# EAGLE schematic CPU (EAGLE 7.5.0), part 6 of 7
## Module INSTRUCTION_DECODER
Ports: LOAD_XE_FROM_DATABUS(out) SELECT_XE_TO_DATABUS(out) LOAD_XH_FROM_DATABUS(out) SELECT_XH_TO_DATABUS(out) LOAD_XL_FROM_DATABUS(out) SELECT_XL_TO_DATABUS(out) LOAD_H_FROM_DATABUS(out) SELECT_H_TO_DATABUS(out) LOAD_G_FROM_DATABUS(out) SELECT_G_TO_DATABUS(out) LOAD_F_FROM_DATABUS(out) SELECT_F_TO_DATABUS(out) LOAD_E_FROM_DATABUS(out) SELECT_E_TO_DATABUS(out) LOAD_D_FROM_DATABUS(out) SELECT_D_TO_DATABUS(out) LOAD_X_FROM_ADDRESSBUS(out) SELECT_X_TO_ADDRESSBUS(out) SELECT_M_TO_ADDRESSBUS(out) LOAD_M_FROM_ADDRESSBUS(out) SELECT_J_TO_ADDRESSBUS(out) LOAD_J_FROM_ADDRESSBUS(out) SELECT_SP_TO_ADDRESSBUS(out) LOAD_SP_FROM_ADDRESSBUS(out) SELECT_BP_TO_ADDRESSBUS(out) LOAD_BP_FROM_ADDRESSBUS(out) SELECT_Y_TO_ADDRESSBUS(out) LOAD_Y_FROM_ADDRESSBUS(out) SELECT_Z_TO_ADDRESSBUS(out) LOAD_Z_FROM_ADDRESSBUS(out) SELECT_SRAM(out) LOAD_SRAM(out) INCREMETER(out) LOAD_PC(out) SELECT_PC(out) LOAD_INC(out) SELECT_INC(out) LOAD_INSTRUCTION(out) SELECT_INSTRUCTION_TO_DATABUS(out) LOAD_INTERNAL_A_FROM_DATABUS(out) SELECT_INTERNAL_A_TO_DATABUS(out) LOAD_A_FROM_DATABUS(out) SELECT_A_TO_ALU(out) LOAD_B_FROM_DATABUS(out) SELECT_B_TO_ALU(out) LOAD_C_FROM_DATABUS(out) SELECT_C_TO_DATABUS(out) STOPCPU(out) ALU_INSTRUCTION(out) SELECT_FLAGS(out) LOAD_FLAGS(out) SELECT_FLAGS_TO_FLAGSBUS(out) LOAD_FLAGS_FROM_FLAGSBUS(out) SELECT_FLAGS_TO_DATABUS(out) LOAD_FLAGS_FROM_DATABUS(out) LOAD_FLAGSSAVED_TO_FLAGS_REGISTER(out) LOAD_FLAGSSAVED_FROM_FLAGS_REGISTER(out) SELECT_PORT_A_TO_DATABUS(out) SELECT_PORT_B_TO_DATABUS(out) LOAD_PORT_C_FROM_DATABUS(out) LOAD_PORT_D_FROM_DATABUS(out) LOAD_ADDER16BIT_INPUT_A(out) LOAD_ADDER16BIT_INPUT_B(out) SELECT_ADDER16BIT_INPUT_A(out) SELECT_ADDER16BIT_INPUT_B(out) LOAD_ADDER16BIT_OUTPUT_C(out) SELECT_ADDER16BIT_OUTPUTC(out) SIGN(in) ZERO(in) CARRY(in) VCC(in) GND(in) I1(in) I2(in) I3(in) I4(in) I5(in) I6(in) I7(in) I8(in) T1(in) T2(in) T3(in) T4(in) T5(in) T6(in) T7(in) T8(in)
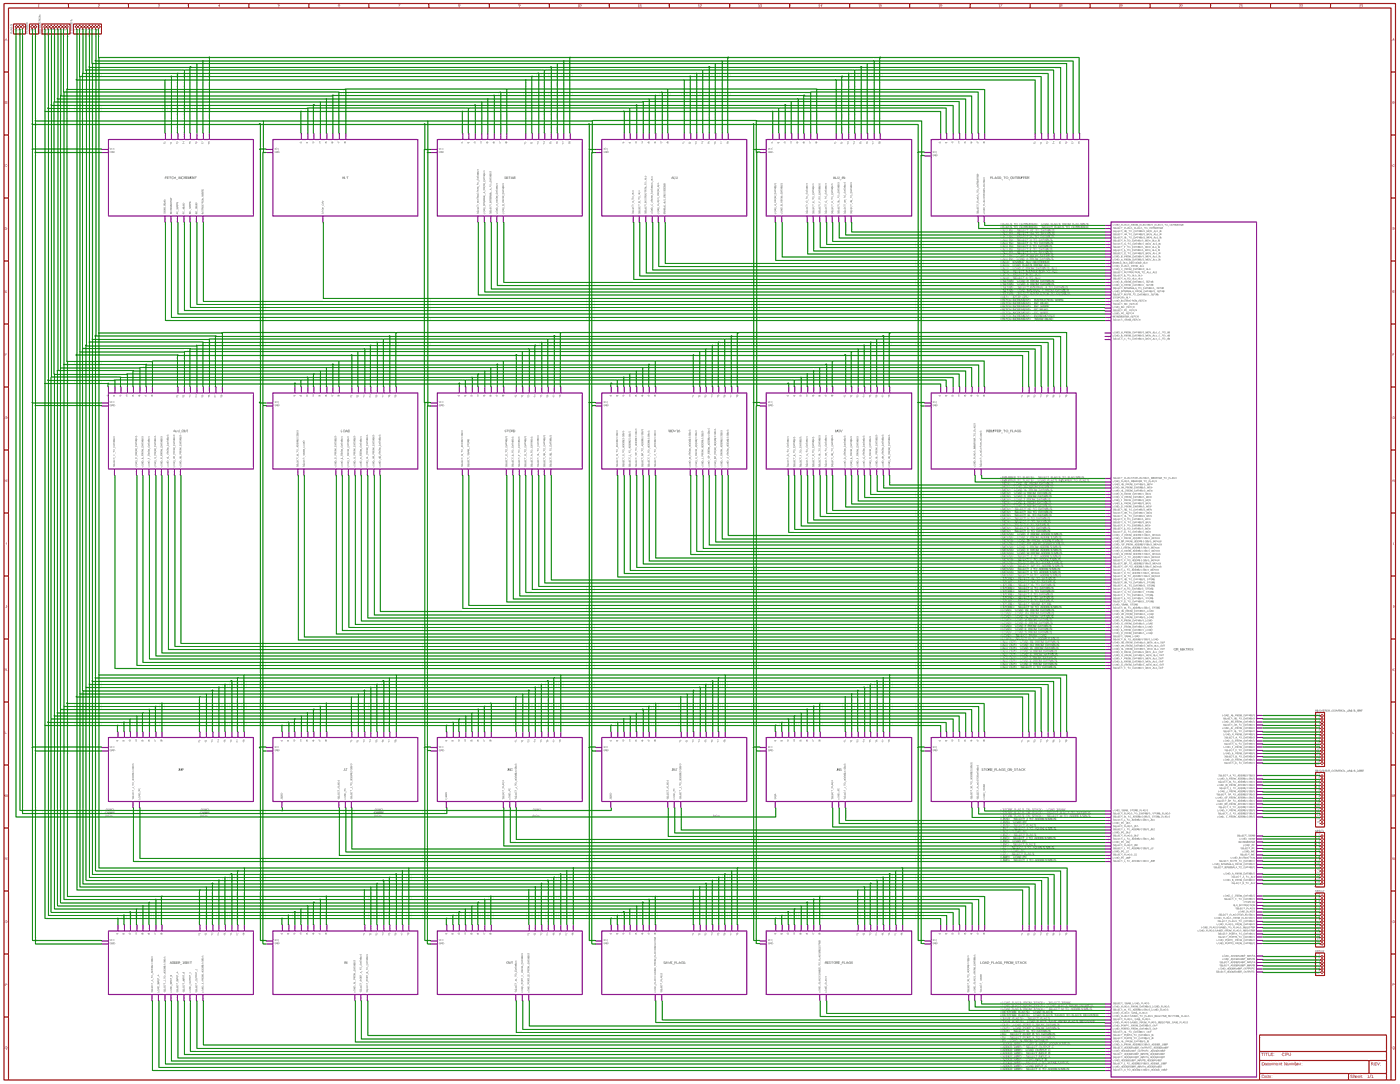
[diagram p79: schematic, module INSTRUCTION_DECODER, sheet 1, overview]
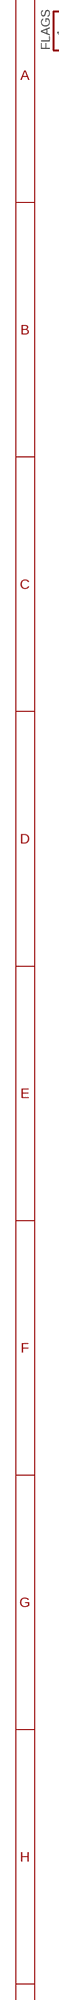
[diagram p80: schematic, module INSTRUCTION_DECODER, sheet 1, part 1 of 8]
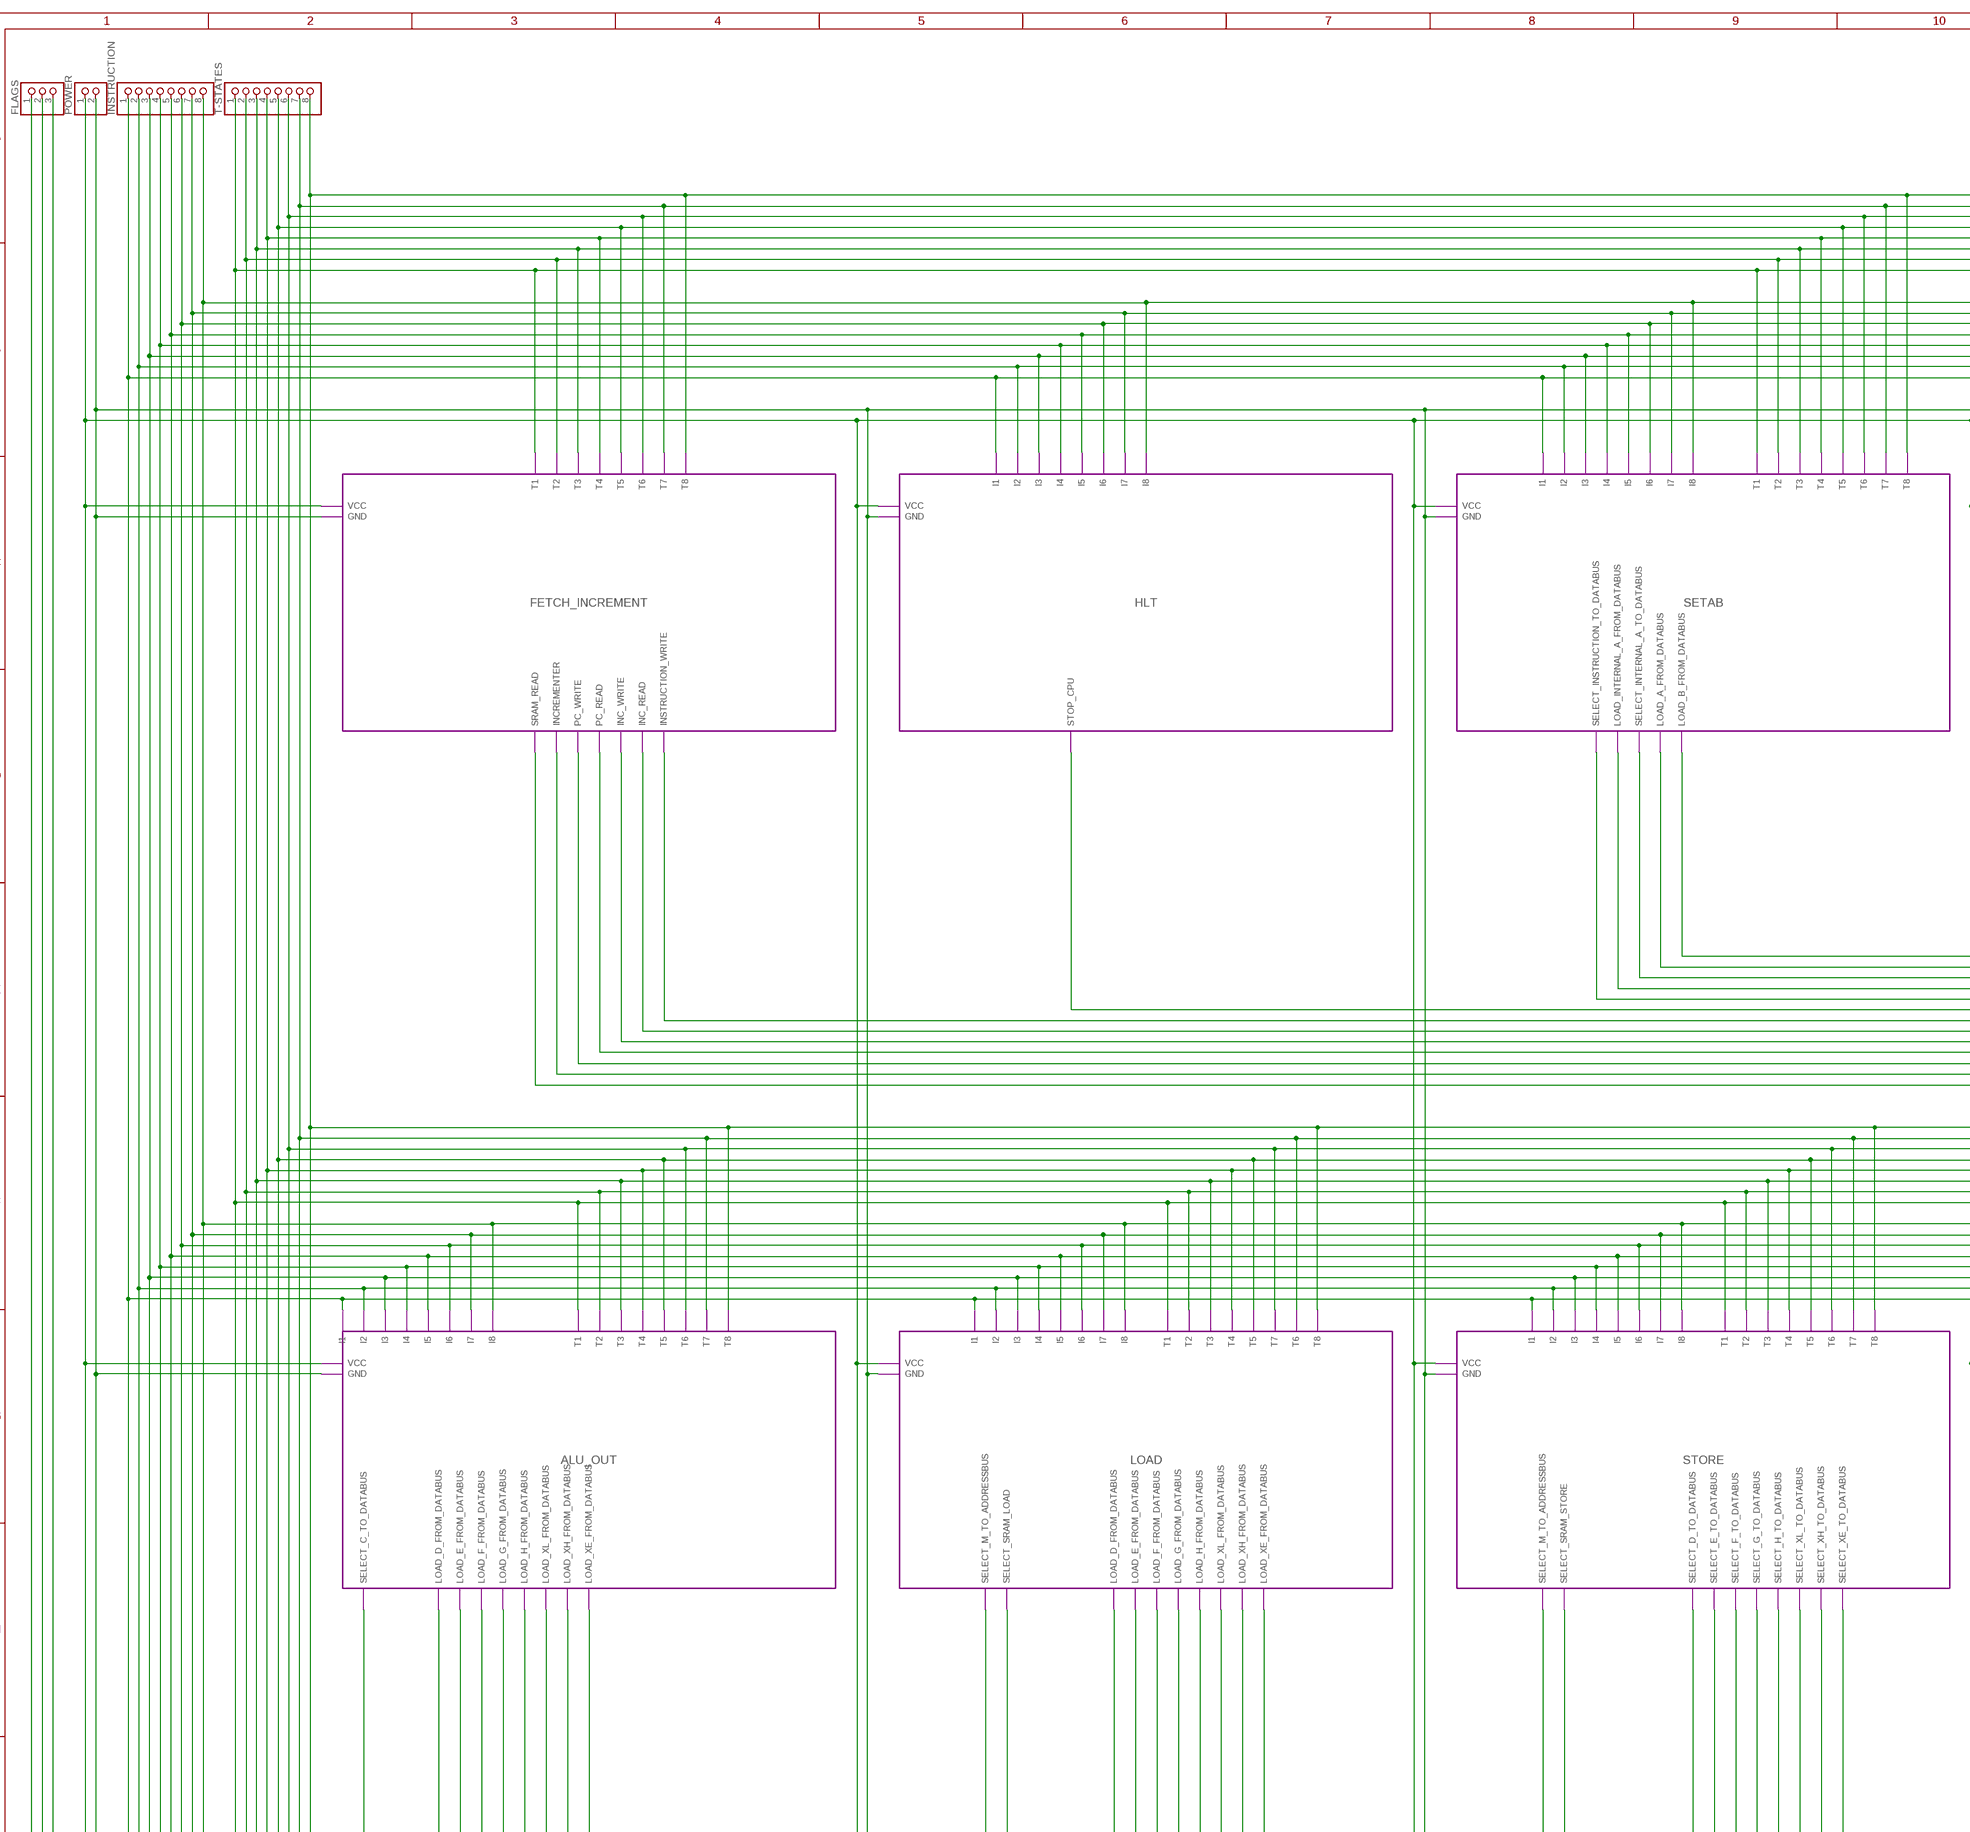
[diagram p81: schematic, module INSTRUCTION_DECODER, sheet 1, part 2 of 8]
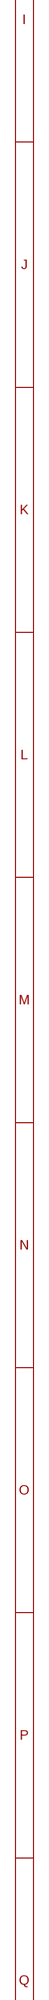
[diagram p82: schematic, module INSTRUCTION_DECODER, sheet 1, part 3 of 8]
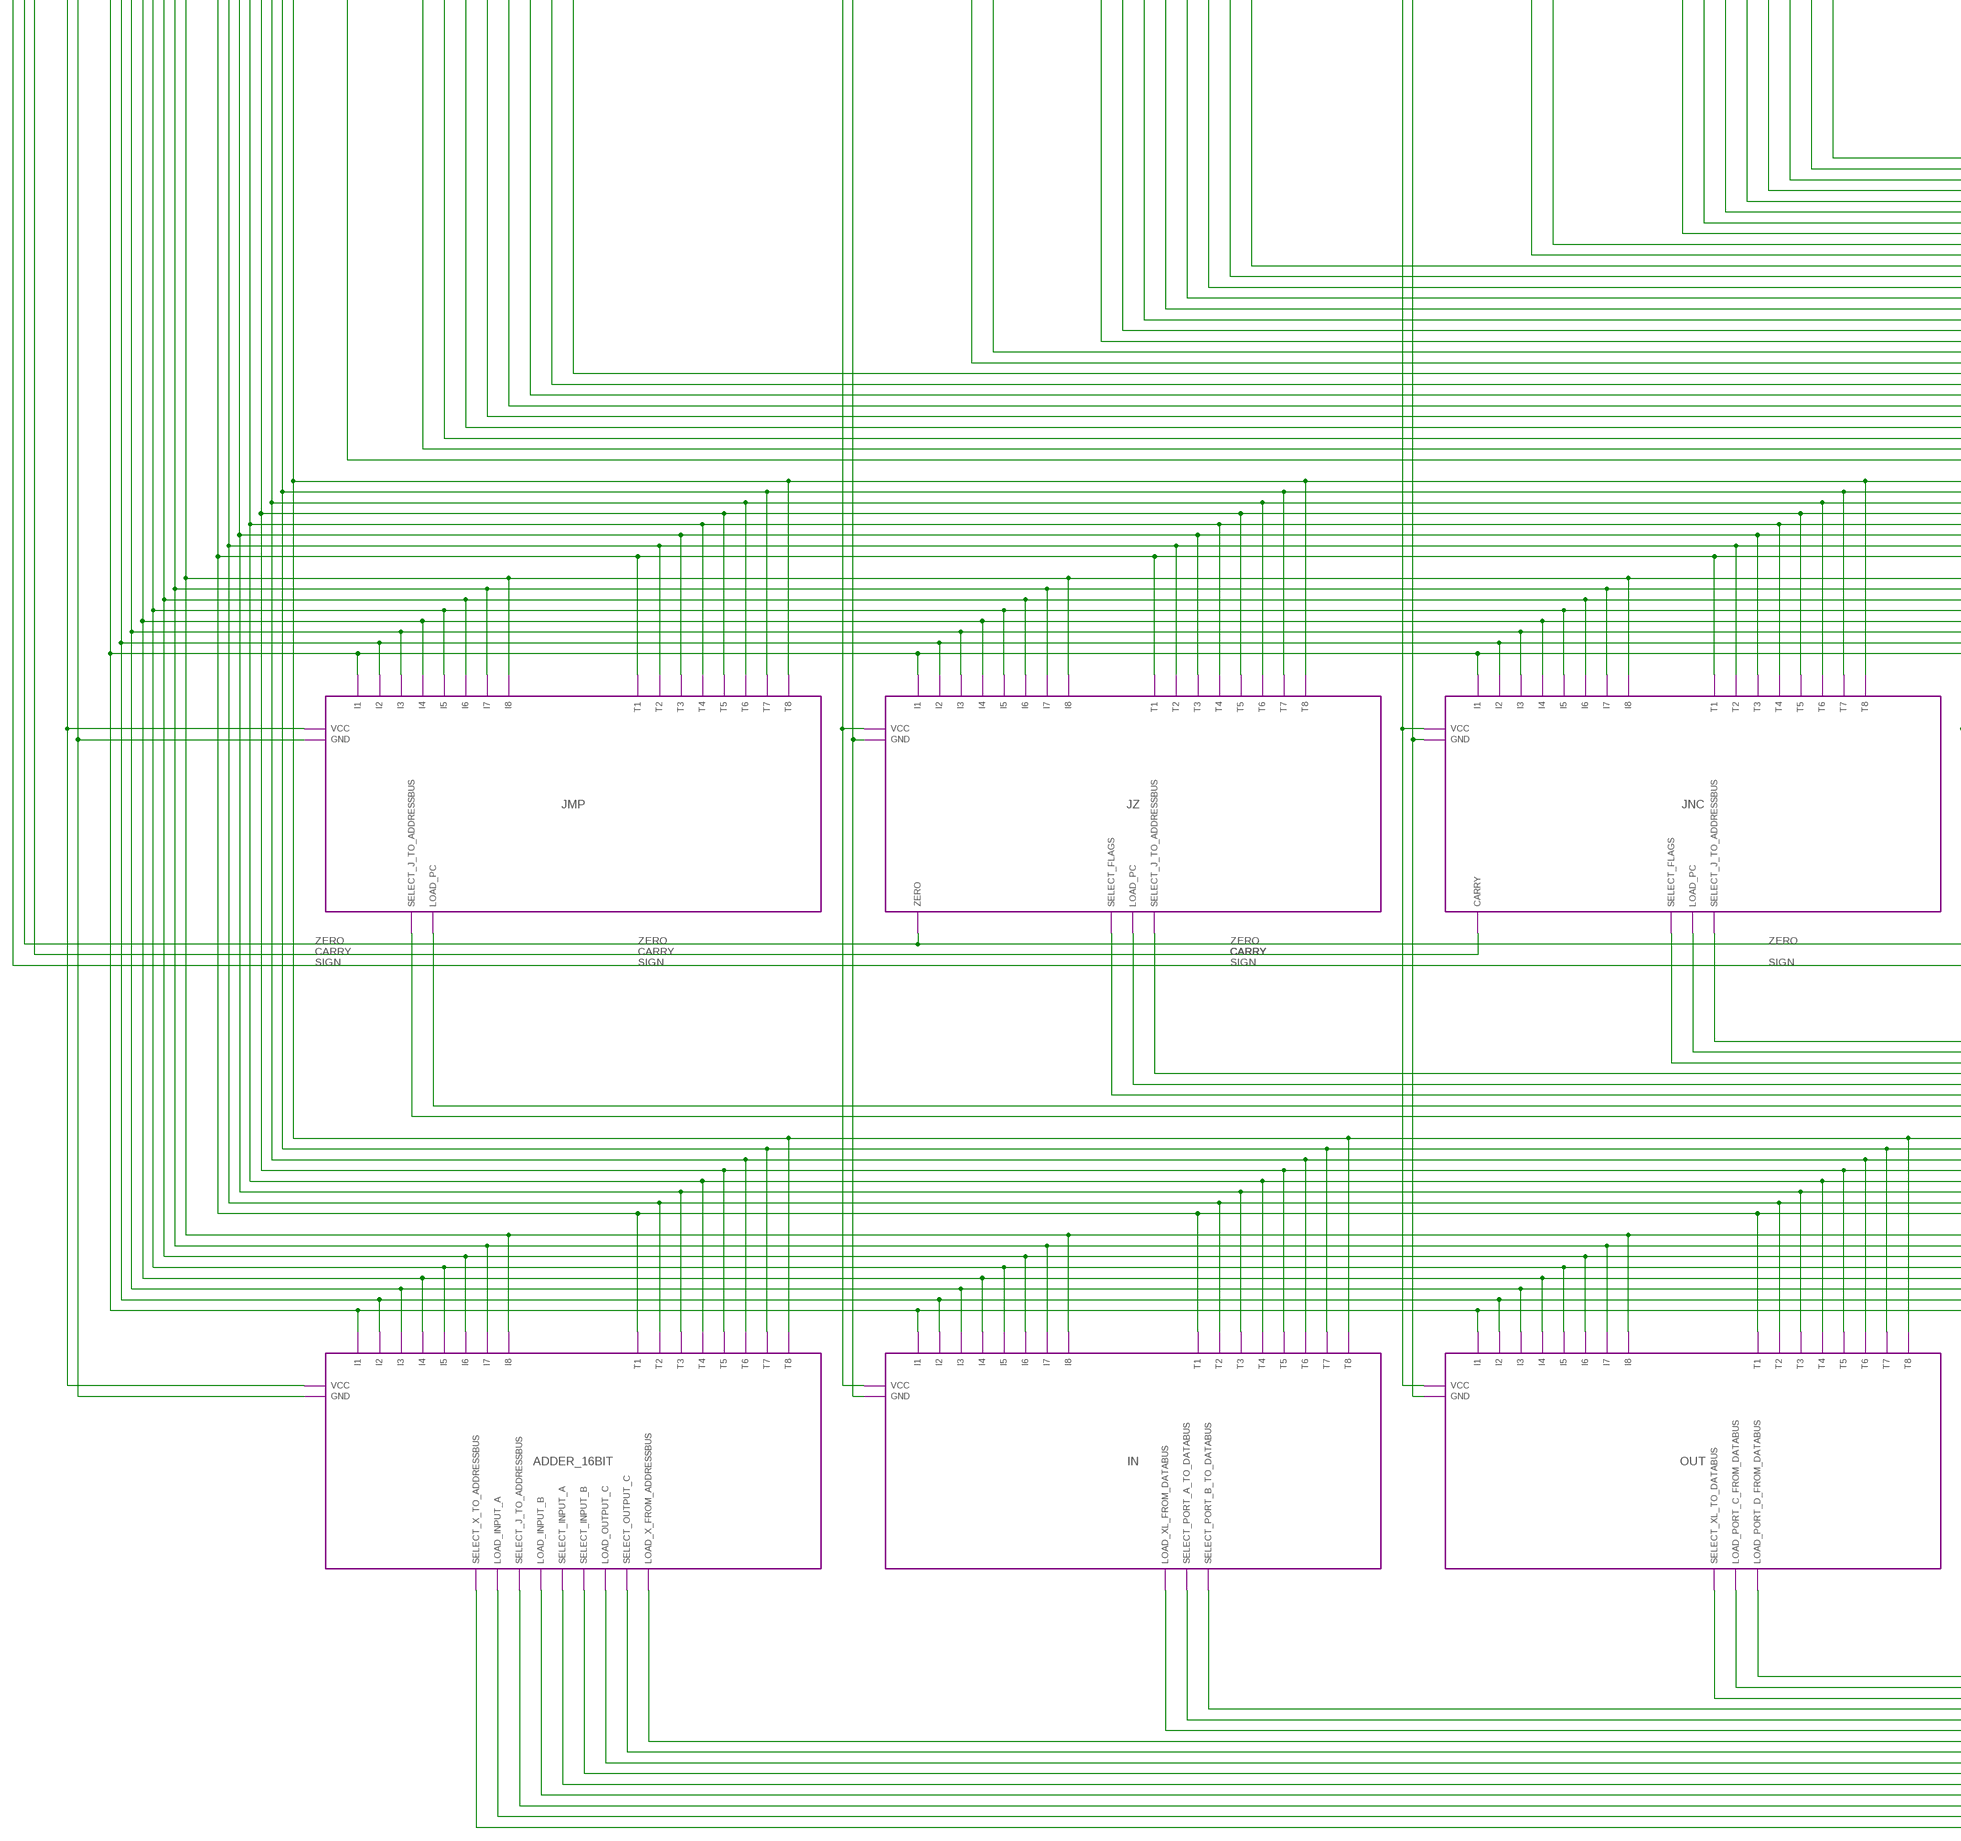
[diagram p83: schematic, module INSTRUCTION_DECODER, sheet 1, part 4 of 8]
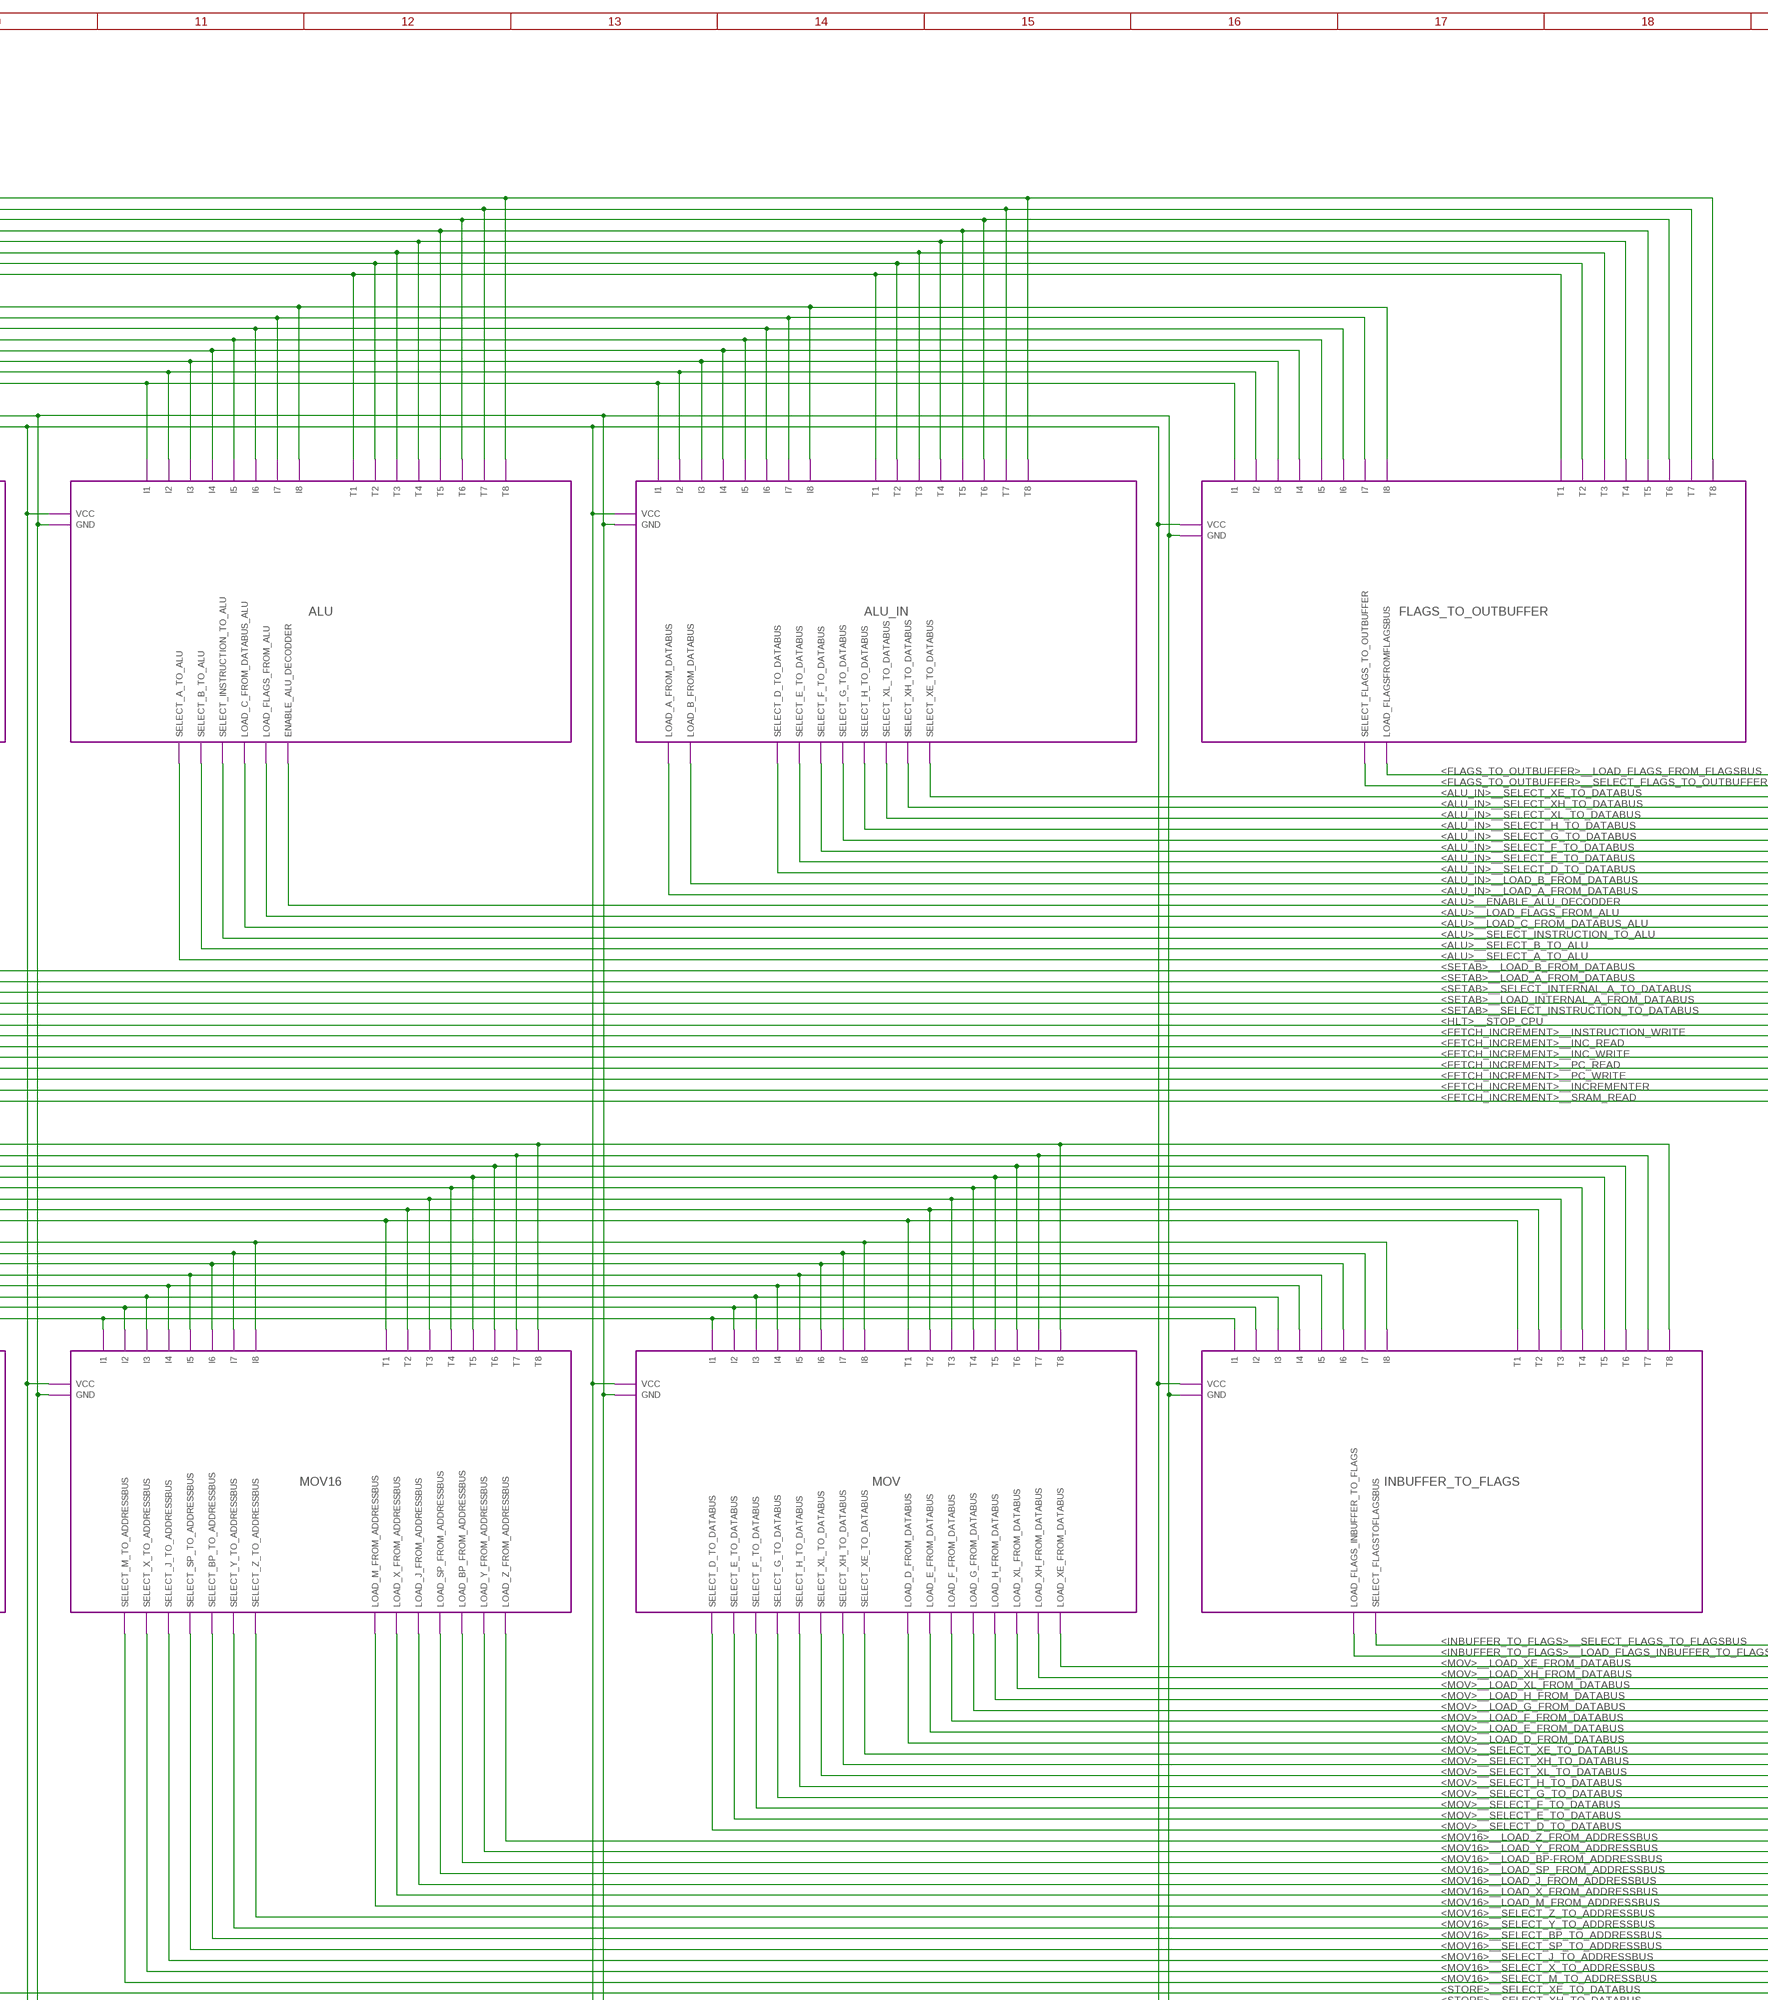
[diagram p84: schematic, module INSTRUCTION_DECODER, sheet 1, part 5 of 8]
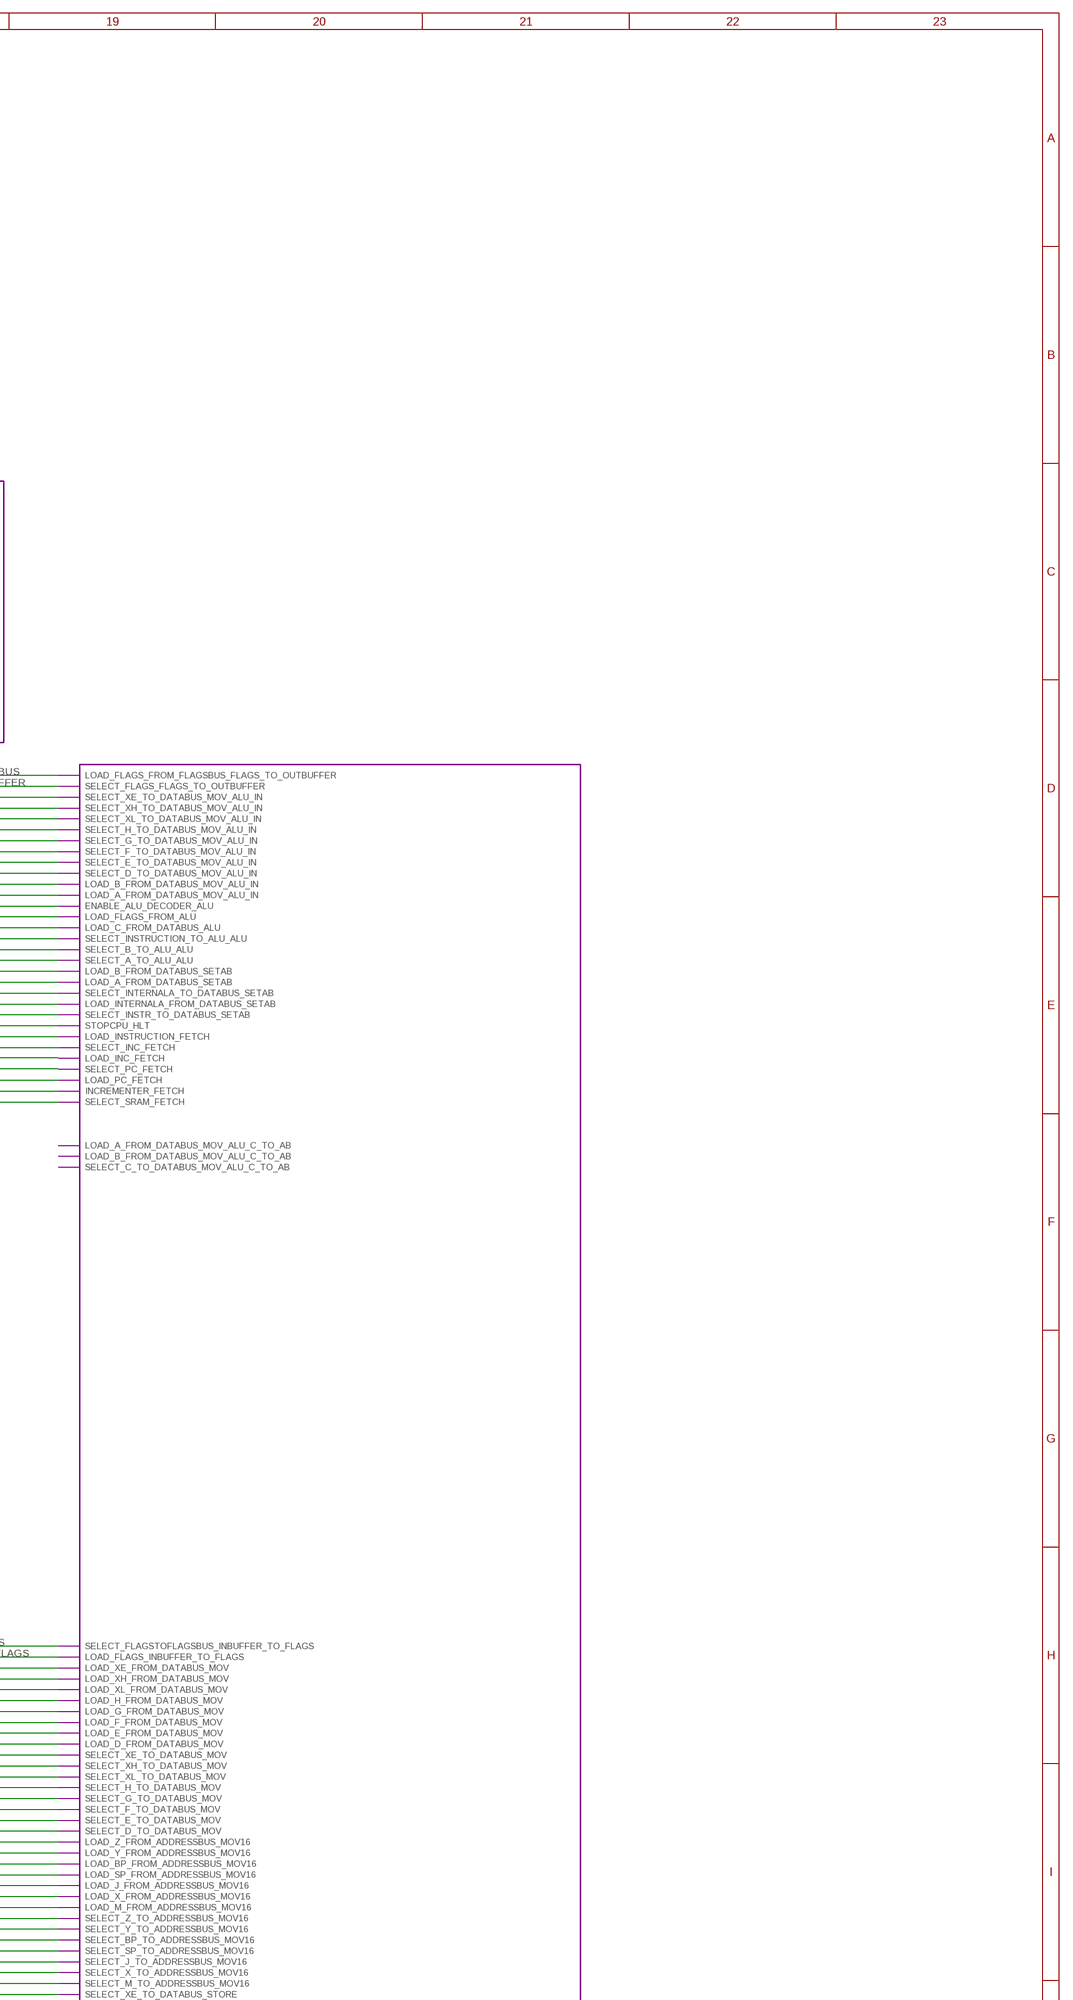
[diagram p85: schematic, module INSTRUCTION_DECODER, sheet 1, part 6 of 8]
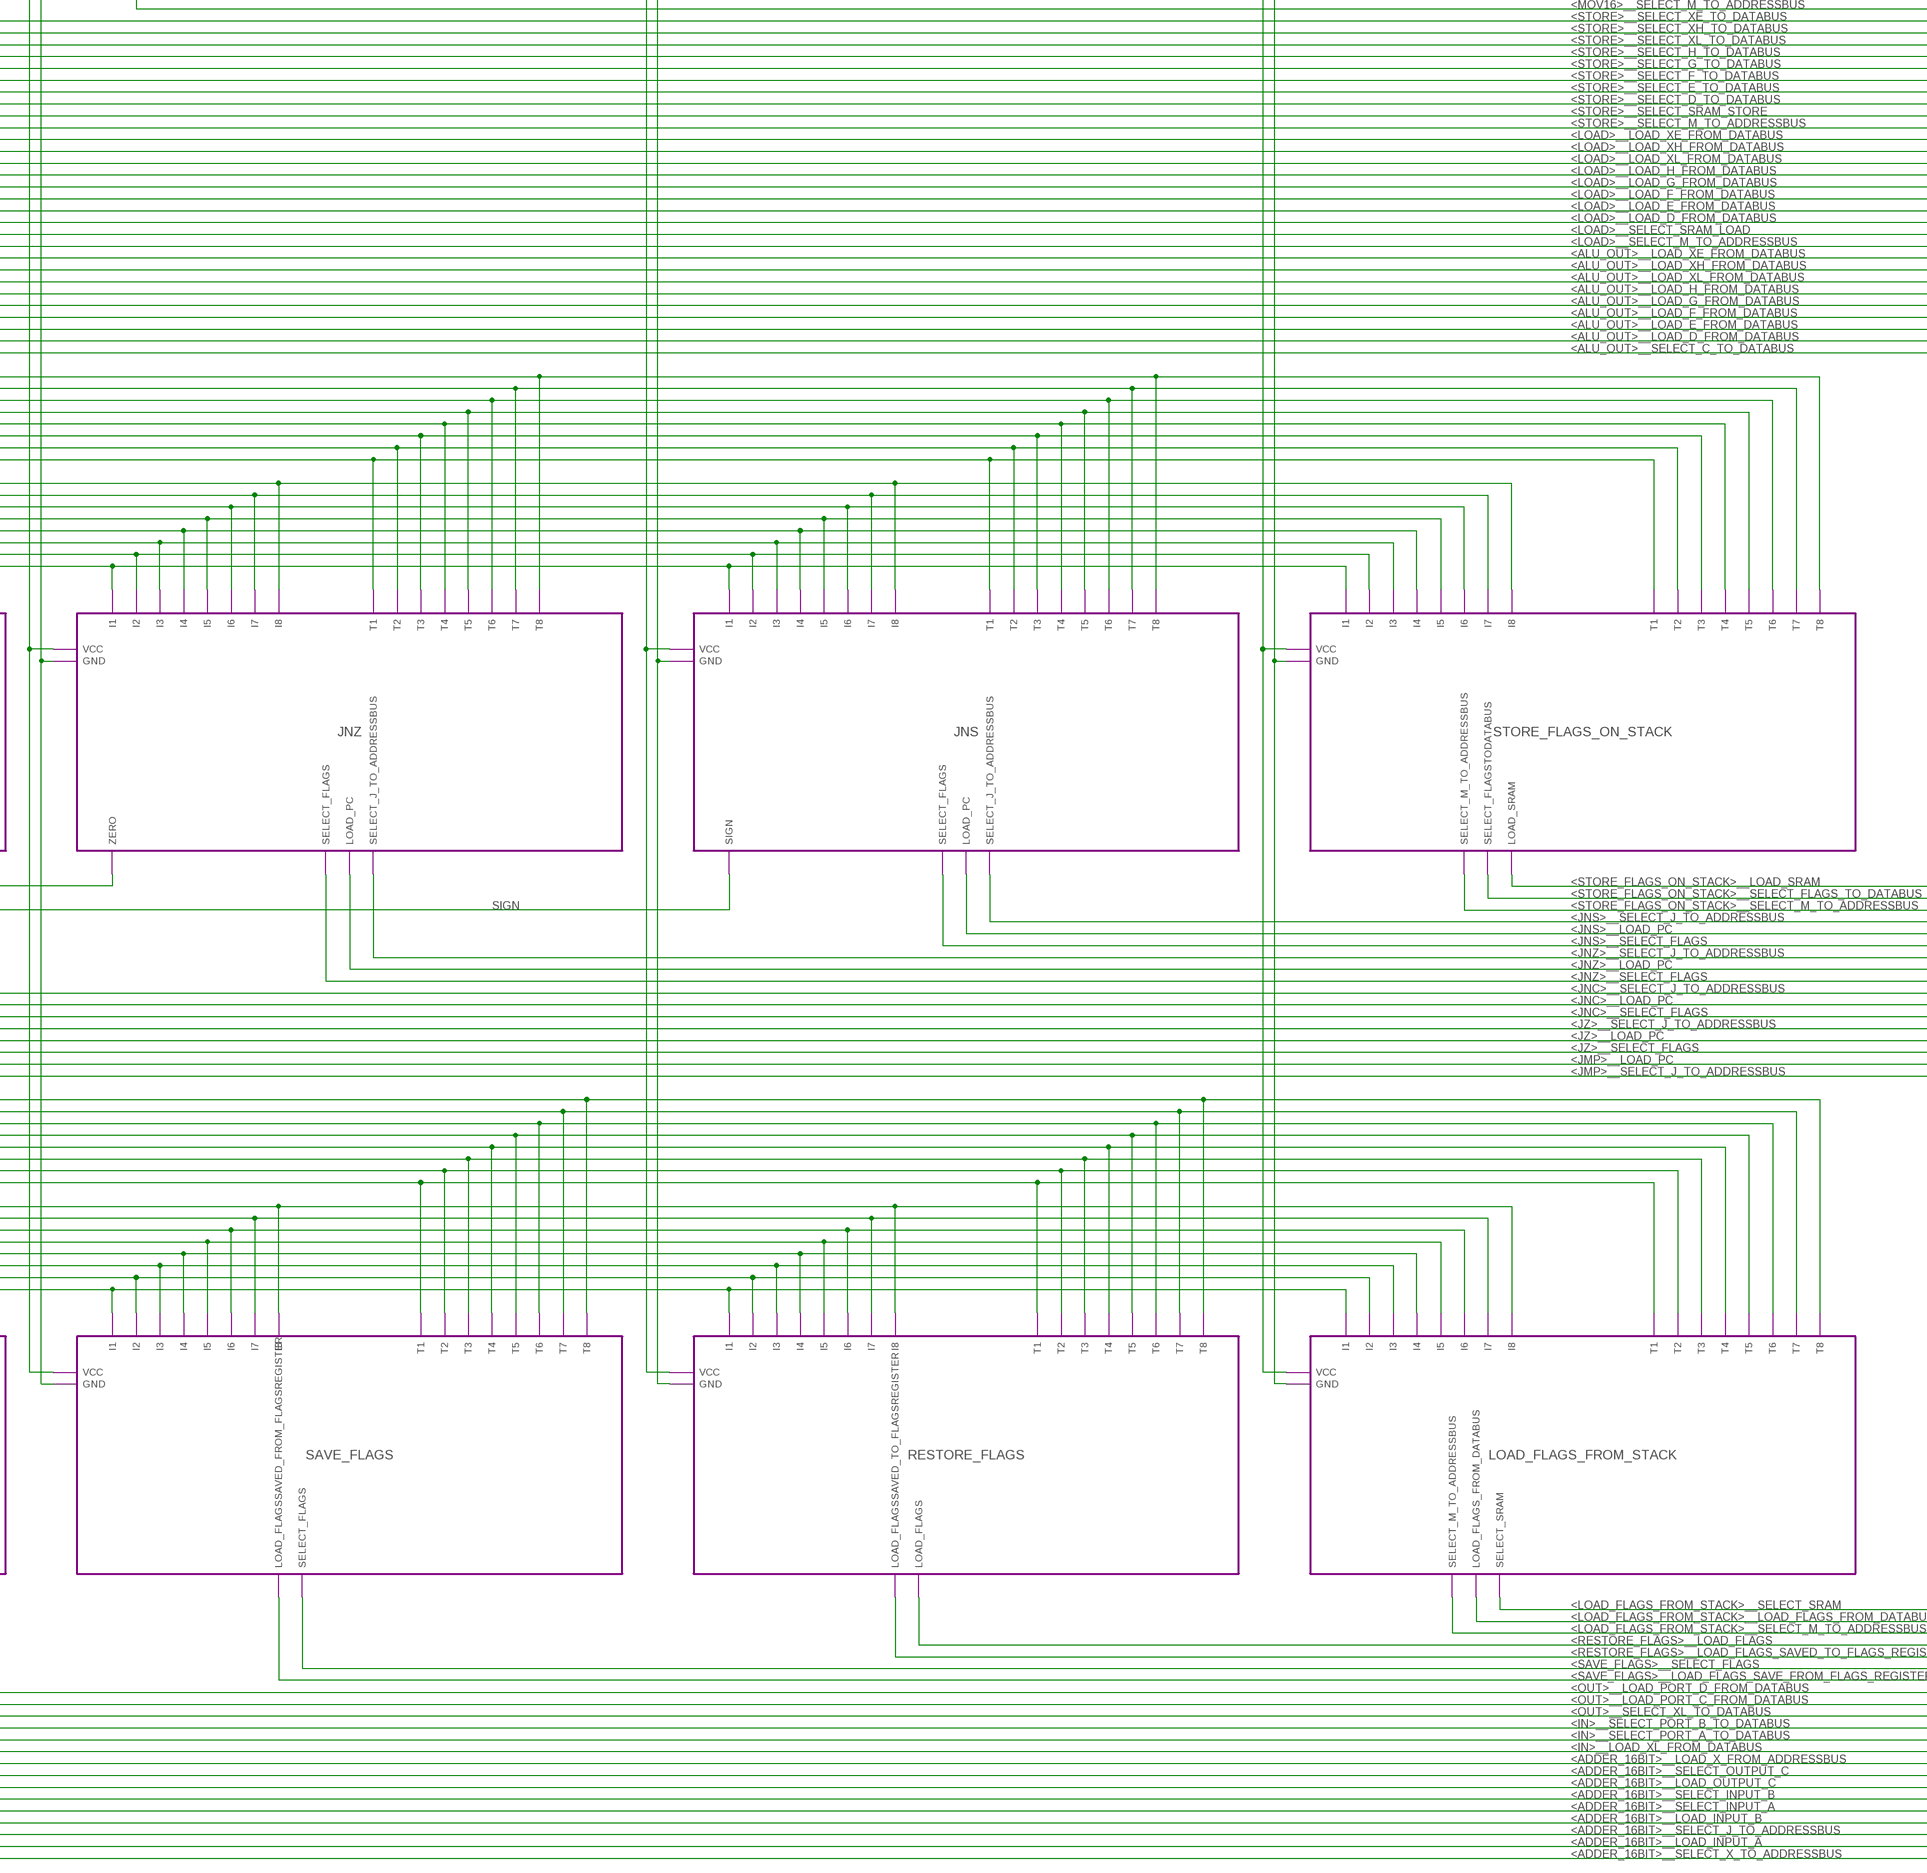
[diagram p86: schematic, module INSTRUCTION_DECODER, sheet 1, part 7 of 8]
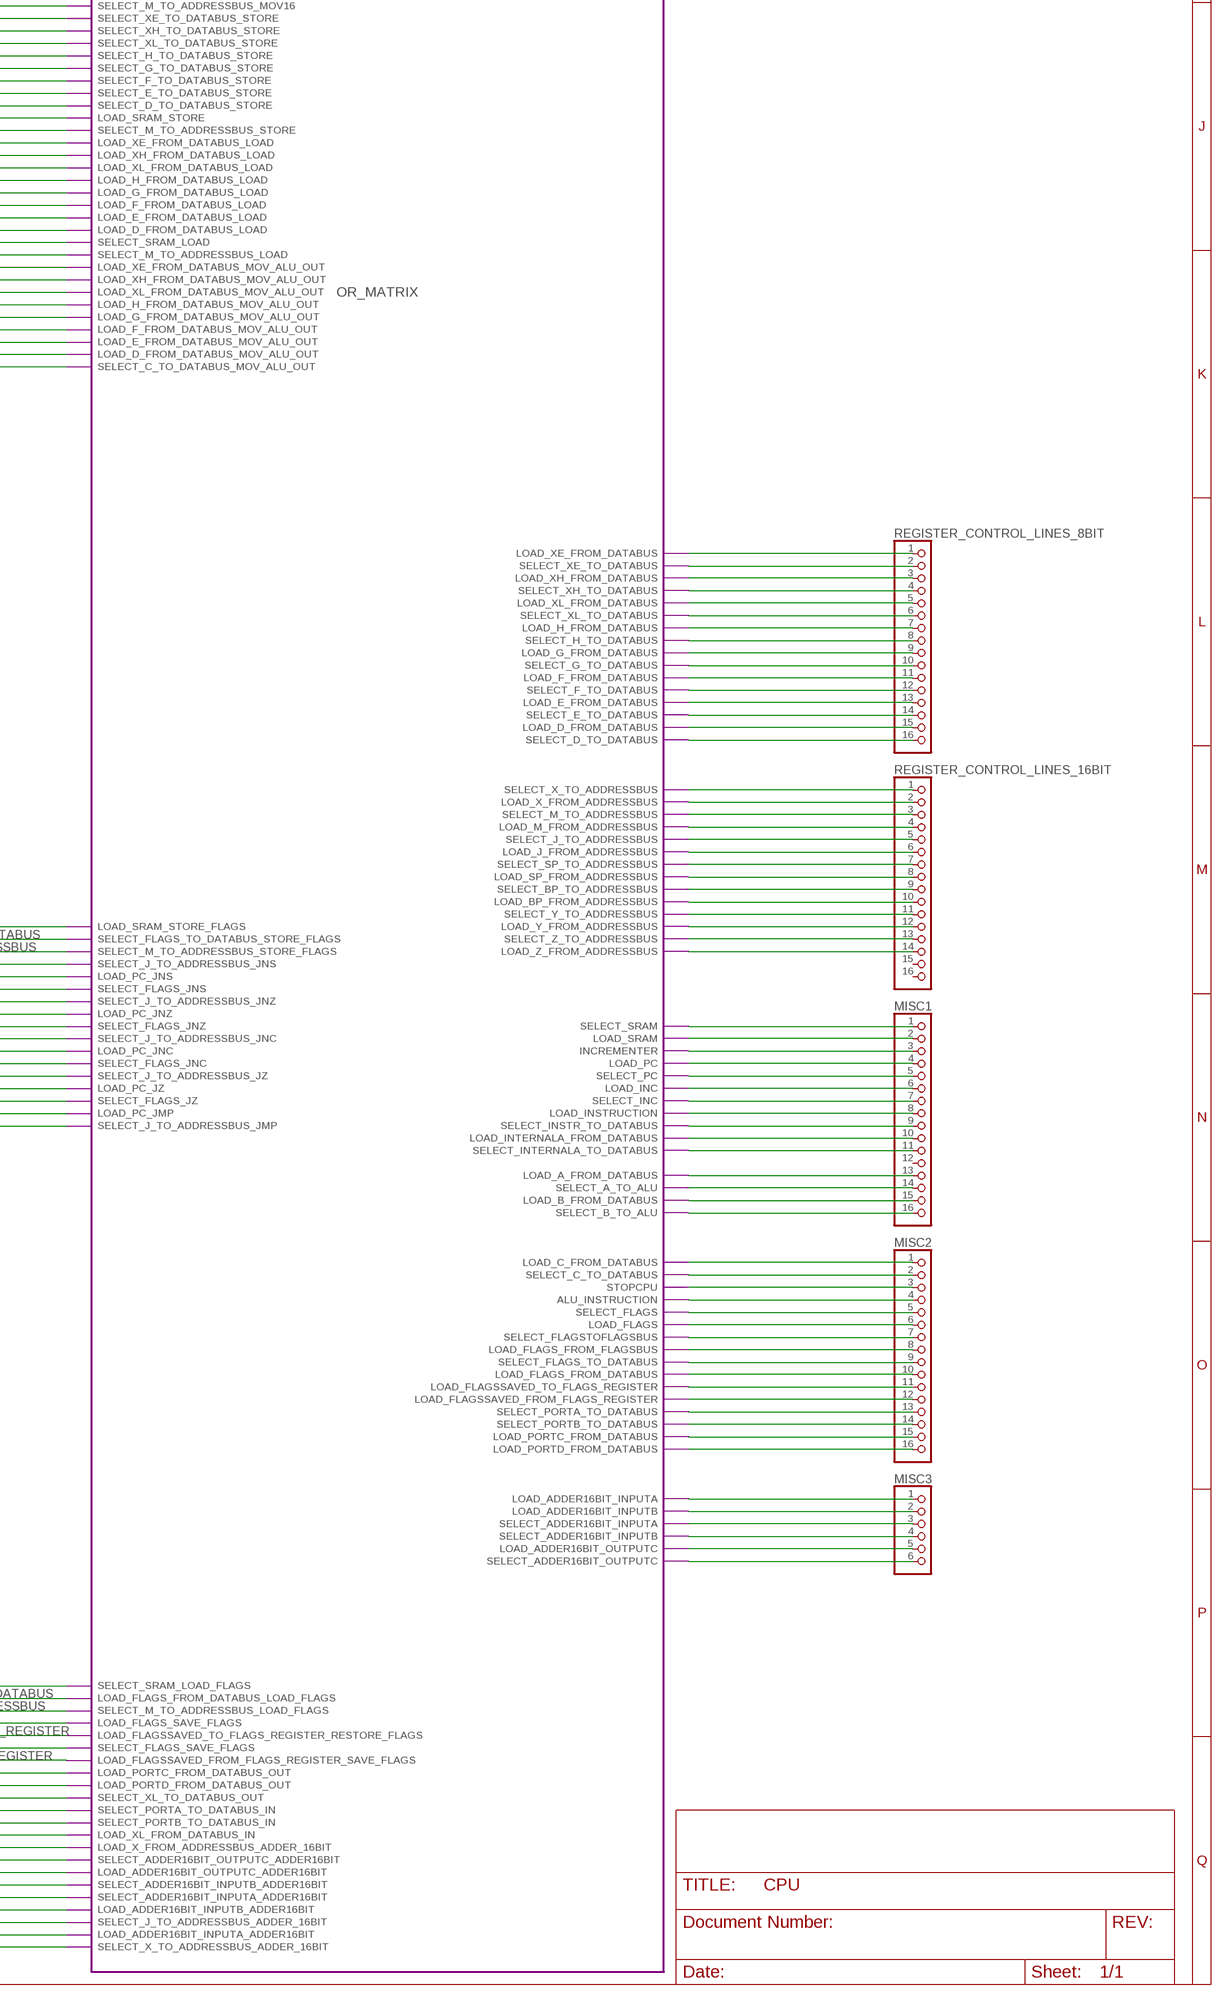
[diagram p87: schematic, module INSTRUCTION_DECODER, sheet 1, part 8 of 8]

### Parts
FLAGS  PINHD-1X3  [1X03]
INSTRUCTION  PINHD-1X8  [1X08]
MISC1  PINHD-1X16  [1X16]
MISC2  PINHD-1X16  [1X16]
MISC3  PINHD-1X6  [1X06]
POWER  PINHD-1X2  [1X02]
REGISTER_CONTROL_LINES_8BIT  PINHD-1X16  [1X16]
REGISTER_CONTROL_LINES_16BIT  PINHD-1X16  [1X16]
T-STATES  PINHD-1X8  [1X08]

### Module instances
FETCH_INCREMENT = FETCH_INCREMENT
SETAB = SETAB
HLT = HLT
ALU = ALU_DECODER
ALU_IN = ALU_IN
ALU_OUT = ALU_OUT
LOAD = LOAD
STORE = STORE
MOV16 = MOV16
JMP = JMP
MOV = MOV
JZ = JZ
JNS = JNS
JNC = JNC
JNZ = JNZ
ADDER_16BIT = ADDER_16BIT
IN = IN
OUT = OUT
SAVE_FLAGS = SAVE_FLAGS
RESTORE_FLAGS = RESTORE_FLAGS
FLAGS_TO_OUTBUFFER = FLAGS_TO_OUTBUFFER
INBUFFER_TO_FLAGS = INBUFFER_TO_FLAGS
STORE_FLAGS_ON_STACK = STORE_FLAGS_ON_STACK
LOAD_FLAGS_FROM_STACK = LOAD_FLAGS_FROM_STACK
OR_MATRIX = OR_MATRIX

### Nets
<ADDER_16BIT>__LOAD_INPUT_A: port ADDER_16BIT.LOAD_INPUT_A OR_MATRIX.LOAD_ADDER16BIT_INPUTA_ADDER16BIT
<ADDER_16BIT>__LOAD_INPUT_B: port ADDER_16BIT.LOAD_INPUT_B OR_MATRIX.LOAD_ADDER16BIT_INPUTB_ADDER16BIT
<ADDER_16BIT>__LOAD_OUTPUT_C: port ADDER_16BIT.LOAD_OUTPUT_C OR_MATRIX.LOAD_ADDER16BIT_OUTPUTC_ADDER16BIT
<ADDER_16BIT>__LOAD_X_FROM_ADDRESSBUS: port ADDER_16BIT.LOAD_X_FROM_ADDRESSBUS OR_MATRIX.LOAD_X_FROM_ADDRESSBUS_ADDER_16BIT
<ADDER_16BIT>__SELECT_INPUT_A: port ADDER_16BIT.SELECT_INPUT_A OR_MATRIX.SELECT_ADDER16BIT_INPUTA_ADDER16BIT
<ADDER_16BIT>__SELECT_INPUT_B: port ADDER_16BIT.SELECT_INPUT_B OR_MATRIX.SELECT_ADDER16BIT_INPUTB_ADDER16BIT
<ADDER_16BIT>__SELECT_J_TO_ADDRESSBUS: port ADDER_16BIT.SELECT_J_TO_ADDRESSBUS OR_MATRIX.SELECT_J_TO_ADDRESSBUS_ADDER_16BIT
<ADDER_16BIT>__SELECT_OUTPUT_C: port ADDER_16BIT.SELECT_OUTPUT_C OR_MATRIX.SELECT_ADDER16BIT_OUTPUTC_ADDER16BIT
<ADDER_16BIT>__SELECT_X_TO_ADDRESSBUS: port ADDER_16BIT.SELECT_X_TO_ADDRESSBUS OR_MATRIX.SELECT_X_TO_ADDRESSBUS_ADDER_16BIT
<ALU>__ENABLE_ALU_DECODDER: port ALU.ENABLE_ALU_DECODDER OR_MATRIX.ENABLE_ALU_DECODER_ALU
<ALU>__LOAD_C_FROM_DATABUS_ALU: port ALU.LOAD_C_FROM_DATABUS_ALU OR_MATRIX.LOAD_C_FROM_DATABUS_ALU
<ALU>__LOAD_FLAGS_FROM_ALU: port ALU.LOAD_FLAGS_FROM_ALU OR_MATRIX.LOAD_FLAGS_FROM_ALU
<ALU>__SELECT_A_TO_ALU: port ALU.SELECT_A_TO_ALU OR_MATRIX.SELECT_A_TO_ALU_ALU
<ALU>__SELECT_B_TO_ALU: port ALU.SELECT_B_TO_ALU OR_MATRIX.SELECT_B_TO_ALU_ALU
<ALU>__SELECT_INSTRUCTION_TO_ALU: port ALU.SELECT_INSTRUCTION_TO_ALU OR_MATRIX.SELECT_INSTRUCTION_TO_ALU_ALU
<ALU_IN>__LOAD_A_FROM_DATABUS: port ALU_IN.LOAD_A_FROM_DATABUS OR_MATRIX.LOAD_A_FROM_DATABUS_MOV_ALU_IN
<ALU_IN>__LOAD_B_FROM_DATABUS: port ALU_IN.LOAD_B_FROM_DATABUS OR_MATRIX.LOAD_B_FROM_DATABUS_MOV_ALU_IN
<ALU_IN>__SELECT_D_TO_DATABUS: port ALU_IN.SELECT_D_TO_DATABUS OR_MATRIX.SELECT_D_TO_DATABUS_MOV_ALU_IN
<ALU_IN>__SELECT_E_TO_DATABUS: port ALU_IN.SELECT_E_TO_DATABUS OR_MATRIX.SELECT_E_TO_DATABUS_MOV_ALU_IN
<ALU_IN>__SELECT_F_TO_DATABUS: port ALU_IN.SELECT_F_TO_DATABUS OR_MATRIX.SELECT_F_TO_DATABUS_MOV_ALU_IN
<ALU_IN>__SELECT_G_TO_DATABUS: port ALU_IN.SELECT_G_TO_DATABUS OR_MATRIX.SELECT_G_TO_DATABUS_MOV_ALU_IN
<ALU_IN>__SELECT_H_TO_DATABUS: port ALU_IN.SELECT_H_TO_DATABUS OR_MATRIX.SELECT_H_TO_DATABUS_MOV_ALU_IN
<ALU_IN>__SELECT_XE_TO_DATABUS: port ALU_IN.SELECT_XE_TO_DATABUS OR_MATRIX.SELECT_XE_TO_DATABUS_MOV_ALU_IN
<ALU_IN>__SELECT_XH_TO_DATABUS: port ALU_IN.SELECT_XH_TO_DATABUS OR_MATRIX.SELECT_XH_TO_DATABUS_MOV_ALU_IN
<ALU_IN>__SELECT_XL_TO_DATABUS: port ALU_IN.SELECT_XL_TO_DATABUS OR_MATRIX.SELECT_XL_TO_DATABUS_MOV_ALU_IN
<ALU_OUT>__LOAD_D_FROM_DATABUS: port ALU_OUT.LOAD_D_FROM_DATABUS OR_MATRIX.LOAD_D_FROM_DATABUS_MOV_ALU_OUT
<ALU_OUT>__LOAD_E_FROM_DATABUS: port ALU_OUT.LOAD_E_FROM_DATABUS OR_MATRIX.LOAD_E_FROM_DATABUS_MOV_ALU_OUT
<ALU_OUT>__LOAD_F_FROM_DATABUS: port ALU_OUT.LOAD_F_FROM_DATABUS OR_MATRIX.LOAD_F_FROM_DATABUS_MOV_ALU_OUT
<ALU_OUT>__LOAD_G_FROM_DATABUS: port ALU_OUT.LOAD_G_FROM_DATABUS OR_MATRIX.LOAD_G_FROM_DATABUS_MOV_ALU_OUT
<ALU_OUT>__LOAD_H_FROM_DATABUS: port ALU_OUT.LOAD_H_FROM_DATABUS OR_MATRIX.LOAD_H_FROM_DATABUS_MOV_ALU_OUT
<ALU_OUT>__LOAD_XE_FROM_DATABUS: port ALU_OUT.LOAD_XE_FROM_DATABUS OR_MATRIX.LOAD_XE_FROM_DATABUS_MOV_ALU_OUT
<ALU_OUT>__LOAD_XH_FROM_DATABUS: port ALU_OUT.LOAD_XH_FROM_DATABUS OR_MATRIX.LOAD_XH_FROM_DATABUS_MOV_ALU_OUT
<ALU_OUT>__LOAD_XL_FROM_DATABUS: port ALU_OUT.LOAD_XL_FROM_DATABUS OR_MATRIX.LOAD_XL_FROM_DATABUS_MOV_ALU_OUT
<ALU_OUT>__SELECT_C_TO_DATABUS: port ALU_OUT.SELECT_C_TO_DATABUS OR_MATRIX.SELECT_C_TO_DATABUS_MOV_ALU_OUT
<FETCH_INCREMENT>__INC_READ: port FETCH_INCREMENT.INC_READ OR_MATRIX.SELECT_INC_FETCH
<FETCH_INCREMENT>__INC_WRITE: port FETCH_INCREMENT.INC_WRITE OR_MATRIX.LOAD_INC_FETCH
<FETCH_INCREMENT>__INCREMENTER: port FETCH_INCREMENT.INCREMENTER OR_MATRIX.INCREMENTER_FETCH
<FETCH_INCREMENT>__INSTRUCTION_WRITE: port FETCH_INCREMENT.INSTRUCTION_WRITE OR_MATRIX.LOAD_INSTRUCTION_FETCH
<FETCH_INCREMENT>__PC_READ: port FETCH_INCREMENT.PC_READ OR_MATRIX.SELECT_PC_FETCH
<FETCH_INCREMENT>__PC_WRITE: port FETCH_INCREMENT.PC_WRITE OR_MATRIX.LOAD_PC_FETCH
<FETCH_INCREMENT>__SRAM_READ: port FETCH_INCREMENT.SRAM_READ OR_MATRIX.SELECT_SRAM_FETCH
<FLAGS_TO_OUTBUFFER>__LOAD_FLAGS_FROM_FLAGSBUS: port FLAGS_TO_OUTBUFFER.LOAD_FLAGSFROMFLAGSBUS OR_MATRIX.LOAD_FLAGS_FROM_FLAGSBUS_FLAGS_TO_OUTBUFFER
<FLAGS_TO_OUTBUFFER>__SELECT_FLAGS_TO_OUTBUFFER: port FLAGS_TO_OUTBUFFER.SELECT_FLAGS_TO_OUTBUFFER OR_MATRIX.SELECT_FLAGS_FLAGS_TO_OUTBUFFER
<HLT>__STOP_CPU: port HLT.STOP_CPU OR_MATRIX.STOPCPU_HLT
<IN>__LOAD_XL_FROM_DATABUS: port IN.LOAD_XL_FROM_DATABUS OR_MATRIX.LOAD_XL_FROM_DATABUS_IN
<IN>__SELECT_PORT_A_TO_DATABUS: port IN.SELECT_PORT_A_TO_DATABUS OR_MATRIX.SELECT_PORTB_TO_DATABUS_IN
<IN>__SELECT_PORT_B_TO_DATABUS: port IN.SELECT_PORT_B_TO_DATABUS OR_MATRIX.SELECT_PORTA_TO_DATABUS_IN
<INBUFFER_TO_FLAGS>__LOAD_FLAGS_INBUFFER_TO_FLAGS: port INBUFFER_TO_FLAGS.LOAD_FLAGS_INBUFFER_TO_FLAGS OR_MATRIX.LOAD_FLAGS_INBUFFER_TO_FLAGS
<INBUFFER_TO_FLAGS>__SELECT_FLAGS_TO_FLAGSBUS: port INBUFFER_TO_FLAGS.SELECT_FLAGSTOFLAGSBUS OR_MATRIX.SELECT_FLAGSTOFLAGSBUS_INBUFFER_TO_FLAGS
<JMP>__LOAD_PC: port JMP.LOAD_PC OR_MATRIX.LOAD_PC_JMP
<JMP>__SELECT_J_TO_ADDRESSBUS: port JMP.SELECT_J_TO_ADDRESSBUS OR_MATRIX.SELECT_J_TO_ADDRESSBUS_JMP
<JNC>__LOAD_PC: port JNC.LOAD_PC OR_MATRIX.LOAD_PC_JNC
<JNC>__SELECT_FLAGS: port JNC.SELECT_FLAGS OR_MATRIX.SELECT_FLAGS_JNC
<JNC>__SELECT_J_TO_ADDRESSBUS: port JNC.SELECT_J_TO_ADDRESSBUS OR_MATRIX.SELECT_J_TO_ADDRESSBUS_JNC
<JNS>__LOAD_PC: port JNS.LOAD_PC OR_MATRIX.LOAD_PC_JNS
<JNS>__SELECT_FLAGS: port JNS.SELECT_FLAGS OR_MATRIX.SELECT_FLAGS_JNS
<JNS>__SELECT_J_TO_ADDRESSBUS: port JNS.SELECT_J_TO_ADDRESSBUS OR_MATRIX.SELECT_J_TO_ADDRESSBUS_JNS
<JNZ>__LOAD_PC: port JNZ.LOAD_PC OR_MATRIX.LOAD_PC_JNZ
<JNZ>__SELECT_FLAGS: port JNZ.SELECT_FLAGS OR_MATRIX.SELECT_FLAGS_JNZ
<JNZ>__SELECT_J_TO_ADDRESSBUS: port JNZ.SELECT_J_TO_ADDRESSBUS OR_MATRIX.SELECT_J_TO_ADDRESSBUS_JNZ
<JZ>__LOAD_PC: port JZ.LOAD_PC OR_MATRIX.LOAD_PC_JZ
<JZ>__SELECT_FLAGS: port JZ.SELECT_FLAGS OR_MATRIX.SELECT_FLAGS_JZ
<JZ>__SELECT_J_TO_ADDRESSBUS: port JZ.SELECT_J_TO_ADDRESSBUS OR_MATRIX.SELECT_J_TO_ADDRESSBUS_JZ
<LOAD>__LOAD_D_FROM_DATABUS: port LOAD.LOAD_D_FROM_DATABUS OR_MATRIX.LOAD_D_FROM_DATABUS_LOAD
<LOAD>__LOAD_E_FROM_DATABUS: port LOAD.LOAD_E_FROM_DATABUS OR_MATRIX.LOAD_E_FROM_DATABUS_LOAD
<LOAD>__LOAD_F_FROM_DATABUS: port LOAD.LOAD_F_FROM_DATABUS OR_MATRIX.LOAD_F_FROM_DATABUS_LOAD
<LOAD>__LOAD_G_FROM_DATABUS: port LOAD.LOAD_G_FROM_DATABUS OR_MATRIX.LOAD_G_FROM_DATABUS_LOAD
<LOAD>__LOAD_H_FROM_DATABUS: port LOAD.LOAD_H_FROM_DATABUS OR_MATRIX.LOAD_H_FROM_DATABUS_LOAD
<LOAD>__LOAD_XE_FROM_DATABUS: port LOAD.LOAD_XE_FROM_DATABUS OR_MATRIX.LOAD_XE_FROM_DATABUS_LOAD
<LOAD>__LOAD_XH_FROM_DATABUS: port LOAD.LOAD_XH_FROM_DATABUS OR_MATRIX.LOAD_XH_FROM_DATABUS_LOAD
<LOAD>__LOAD_XL_FROM_DATABUS: port LOAD.LOAD_XL_FROM_DATABUS OR_MATRIX.LOAD_XL_FROM_DATABUS_LOAD
<LOAD>__SELECT_M_TO_ADDRESSBUS: port LOAD.SELECT_M_TO_ADDRESSBUS OR_MATRIX.SELECT_M_TO_ADDRESSBUS_LOAD
<LOAD>__SELECT_SRAM_LOAD: port LOAD.SELECT_SRAM_LOAD OR_MATRIX.SELECT_SRAM_LOAD
<LOAD_FLAGS_FROM_STACK>__LOAD_FLAGS_FROM_DATABUS: port LOAD_FLAGS_FROM_STACK.LOAD_FLAGS_FROM_DATABUS OR_MATRIX.LOAD_FLAGS_FROM_DATABUS_LOAD_FLAGS
<LOAD_FLAGS_FROM_STACK>__SELECT_M_TO_ADDRESSBUS: port LOAD_FLAGS_FROM_STACK.SELECT_M_TO_ADDRESSBUS OR_MATRIX.SELECT_M_TO_ADDRESSBUS_LOAD_FLAGS
<LOAD_FLAGS_FROM_STACK>__SELECT_SRAM: port LOAD_FLAGS_FROM_STACK.SELECT_SRAM OR_MATRIX.SELECT_SRAM_LOAD_FLAGS
<MOV16>__LOAD_BP-FROM_ADDRESSBUS: port MOV16.LOAD_BP_FROM_ADDRESSBUS OR_MATRIX.LOAD_BP_FROM_ADDRESSBUS_MOV16
<MOV16>__LOAD_J_FROM_ADDRESSBUS: port MOV16.LOAD_J_FROM_ADDRESSBUS OR_MATRIX.LOAD_J_FROM_ADDRESSBUS_MOV16
<MOV16>__LOAD_M_FROM_ADDRESSBUS: port MOV16.LOAD_M_FROM_ADDRESSBUS OR_MATRIX.LOAD_M_FROM_ADDRESSBUS_MOV16
<MOV16>__LOAD_SP_FROM_ADDRESSBUS: port MOV16.LOAD_SP_FROM_ADDRESSBUS OR_MATRIX.LOAD_SP_FROM_ADDRESSBUS_MOV16
<MOV16>__LOAD_X_FROM_ADDRESSBUS: port MOV16.LOAD_X_FROM_ADDRESSBUS OR_MATRIX.LOAD_X_FROM_ADDRESSBUS_MOV16
<MOV16>__LOAD_Y_FROM_ADDRESSBUS: port MOV16.LOAD_Y_FROM_ADDRESSBUS OR_MATRIX.LOAD_Y_FROM_ADDRESSBUS_MOV16
<MOV16>__LOAD_Z_FROM_ADDRESSBUS: port MOV16.LOAD_Z_FROM_ADDRESSBUS OR_MATRIX.LOAD_Z_FROM_ADDRESSBUS_MOV16
<MOV16>__SELECT_BP_TO_ADDRESSBUS: port MOV16.SELECT_BP_TO_ADDRESSBUS OR_MATRIX.SELECT_BP_TO_ADDRESSBUS_MOV16
<MOV16>__SELECT_J_TO_ADDRESSBUS: port MOV16.SELECT_J_TO_ADDRESSBUS OR_MATRIX.SELECT_J_TO_ADDRESSBUS_MOV16
<MOV16>__SELECT_M_TO_ADDRESSBUS: port MOV16.SELECT_M_TO_ADDRESSBUS OR_MATRIX.SELECT_M_TO_ADDRESSBUS_MOV16
<MOV16>__SELECT_SP_TO_ADDRESSBUS: port MOV16.SELECT_SP_TO_ADDRESSBUS OR_MATRIX.SELECT_SP_TO_ADDRESSBUS_MOV16
<MOV16>__SELECT_X_TO_ADDRESSBUS: port MOV16.SELECT_X_TO_ADDRESSBUS OR_MATRIX.SELECT_X_TO_ADDRESSBUS_MOV16
<MOV16>__SELECT_Y_TO_ADDRESSBUS: port MOV16.SELECT_Y_TO_ADDRESSBUS OR_MATRIX.SELECT_Y_TO_ADDRESSBUS_MOV16
<MOV16>__SELECT_Z_TO_ADDRESSBUS: port MOV16.SELECT_Z_TO_ADDRESSBUS OR_MATRIX.SELECT_Z_TO_ADDRESSBUS_MOV16
<MOV>__LOAD_D_FROM_DATABUS: port MOV.LOAD_D_FROM_DATABUS OR_MATRIX.LOAD_D_FROM_DATABUS_MOV
<MOV>__LOAD_E_FROM_DATABUS: port MOV.LOAD_E_FROM_DATABUS OR_MATRIX.LOAD_E_FROM_DATABUS_MOV
<MOV>__LOAD_F_FROM_DATABUS: port MOV.LOAD_F_FROM_DATABUS OR_MATRIX.LOAD_F_FROM_DATABUS_MOV
<MOV>__LOAD_G_FROM_DATABUS: port MOV.LOAD_G_FROM_DATABUS OR_MATRIX.LOAD_G_FROM_DATABUS_MOV
<MOV>__LOAD_H_FROM_DATABUS: port MOV.LOAD_H_FROM_DATABUS OR_MATRIX.LOAD_H_FROM_DATABUS_MOV
<MOV>__LOAD_XE_FROM_DATABUS: port MOV.LOAD_XE_FROM_DATABUS OR_MATRIX.LOAD_XE_FROM_DATABUS_MOV
<MOV>__LOAD_XH_FROM_DATABUS: port MOV.LOAD_XH_FROM_DATABUS OR_MATRIX.LOAD_XH_FROM_DATABUS_MOV
<MOV>__LOAD_XL_FROM_DATABUS: port MOV.LOAD_XL_FROM_DATABUS OR_MATRIX.LOAD_XL_FROM_DATABUS_MOV
<MOV>__SELECT_D_TO_DATABUS: port MOV.SELECT_D_TO_DATABUS OR_MATRIX.SELECT_D_TO_DATABUS_MOV
<MOV>__SELECT_E_TO_DATABUS: port MOV.SELECT_E_TO_DATABUS OR_MATRIX.SELECT_E_TO_DATABUS_MOV
<MOV>__SELECT_F_TO_DATABUS: port MOV.SELECT_F_TO_DATABUS OR_MATRIX.SELECT_F_TO_DATABUS_MOV
<MOV>__SELECT_G_TO_DATABUS: port MOV.SELECT_G_TO_DATABUS OR_MATRIX.SELECT_G_TO_DATABUS_MOV
<MOV>__SELECT_H_TO_DATABUS: port MOV.SELECT_H_TO_DATABUS OR_MATRIX.SELECT_H_TO_DATABUS_MOV
<MOV>__SELECT_XE_TO_DATABUS: port MOV.SELECT_XE_TO_DATABUS OR_MATRIX.SELECT_XE_TO_DATABUS_MOV
<MOV>__SELECT_XH_TO_DATABUS: port MOV.SELECT_XH_TO_DATABUS OR_MATRIX.SELECT_XH_TO_DATABUS_MOV
<MOV>__SELECT_XL_TO_DATABUS: port MOV.SELECT_XL_TO_DATABUS OR_MATRIX.SELECT_XL_TO_DATABUS_MOV
<OUT>__LOAD_PORT_C_FROM_DATABUS: port OUT.LOAD_PORT_C_FROM_DATABUS OR_MATRIX.LOAD_PORTD_FROM_DATABUS_OUT
<OUT>__LOAD_PORT_D_FROM_DATABUS: port OUT.LOAD_PORT_D_FROM_DATABUS OR_MATRIX.LOAD_PORTC_FROM_DATABUS_OUT
<OUT>__SELECT_XL_TO_DATABUS: port OUT.SELECT_XL_TO_DATABUS OR_MATRIX.SELECT_XL_TO_DATABUS_OUT
<RESTORE_FLAGS>__LOAD_FLAGS: port RESTORE_FLAGS.LOAD_FLAGS OR_MATRIX.LOAD_FLAGS_SAVE_FLAGS
<RESTORE_FLAGS>__LOAD_FLAGS_SAVED_TO_FLAGS_REGISTER: port RESTORE_FLAGS.LOAD_FLAGSSAVED_TO_FLAGSREGISTER OR_MATRIX.LOAD_FLAGSSAVED_TO_FLAGS_REGISTER_RESTORE_FLAGS
<SAVE_FLAGS>__LOAD_FLAGS_SAVE_FROM_FLAGS_REGISTER: port SAVE_FLAGS.LOAD_FLAGSSAVED_FROM_FLAGSREGISTER OR_MATRIX.LOAD_FLAGSSAVED_FROM_FLAGS_REGISTER_SAVE_FLAGS
<SAVE_FLAGS>__SELECT_FLAGS: port SAVE_FLAGS.SELECT_FLAGS OR_MATRIX.SELECT_FLAGS_SAVE_FLAGS
<SETAB>__LOAD_A_FROM_DATABUS: port SETAB.LOAD_A_FROM_DATABUS OR_MATRIX.LOAD_A_FROM_DATABUS_SETAB
<SETAB>__LOAD_B_FROM_DATABUS: port SETAB.LOAD_B_FROM_DATABUS OR_MATRIX.LOAD_B_FROM_DATABUS_SETAB
<SETAB>__LOAD_INTERNAL_A_FROM_DATABUS: port SETAB.LOAD_INTERNAL_A_FROM_DATABUS OR_MATRIX.LOAD_INTERNALA_FROM_DATABUS_SETAB
<SETAB>__SELECT_INSTRUCTION_TO_DATABUS: port SETAB.SELECT_INSTRUCTION_TO_DATABUS OR_MATRIX.SELECT_INSTR_TO_DATABUS_SETAB
<SETAB>__SELECT_INTERNAL_A_TO_DATABUS: port SETAB.SELECT_INTERNAL_A_TO_DATABUS OR_MATRIX.SELECT_INTERNALA_TO_DATABUS_SETAB
<STORE>__SELECT_D_TO_DATABUS: port STORE.SELECT_D_TO_DATABUS OR_MATRIX.SELECT_D_TO_DATABUS_STORE
<STORE>__SELECT_E_TO_DATABUS: port STORE.SELECT_E_TO_DATABUS OR_MATRIX.SELECT_E_TO_DATABUS_STORE
<STORE>__SELECT_F_TO_DATABUS: port STORE.SELECT_F_TO_DATABUS OR_MATRIX.SELECT_F_TO_DATABUS_STORE
<STORE>__SELECT_G_TO_DATABUS: port STORE.SELECT_G_TO_DATABUS OR_MATRIX.SELECT_G_TO_DATABUS_STORE
<STORE>__SELECT_H_TO_DATABUS: port STORE.SELECT_H_TO_DATABUS OR_MATRIX.SELECT_H_TO_DATABUS_STORE
<STORE>__SELECT_M_TO_ADDRESSBUS: port STORE.SELECT_M_TO_ADDRESSBUS OR_MATRIX.SELECT_M_TO_ADDRESSBUS_STORE
<STORE>__SELECT_SRAM_STORE: port STORE.SELECT_SRAM_STORE OR_MATRIX.LOAD_SRAM_STORE
<STORE>__SELECT_XE_TO_DATABUS: port STORE.SELECT_XE_TO_DATABUS OR_MATRIX.SELECT_XE_TO_DATABUS_STORE
<STORE>__SELECT_XH_TO_DATABUS: port STORE.SELECT_XH_TO_DATABUS OR_MATRIX.SELECT_XH_TO_DATABUS_STORE
<STORE>__SELECT_XL_TO_DATABUS: port STORE.SELECT_XL_TO_DATABUS OR_MATRIX.SELECT_XL_TO_DATABUS_STORE
<STORE_FLAGS_ON_STACK>__LOAD_SRAM: port STORE_FLAGS_ON_STACK.LOAD_SRAM OR_MATRIX.LOAD_SRAM_STORE_FLAGS
<STORE_FLAGS_ON_STACK>__SELECT_FLAGS_TO_DATABUS: port STORE_FLAGS_ON_STACK.SELECT_FLAGSTODATABUS OR_MATRIX.SELECT_FLAGS_TO_DATABUS_STORE_FLAGS
<STORE_FLAGS_ON_STACK>__SELECT_M_TO_ADDRESSBUS: port STORE_FLAGS_ON_STACK.SELECT_M_TO_ADDRESSBUS OR_MATRIX.SELECT_M_TO_ADDRESSBUS_STORE_FLAGS
ALU_INSTRUCTION: MISC2.4 ; port OR_MATRIX.ALU_INSTRUCTION
CARRY: FLAGS.3 ; port JNC.CARRY
GND: POWER.2 ; port FETCH_INCREMENT.GND HLT.GND SETAB.GND ALU.GND ALU_IN.GND ALU_OUT.GND LOAD.GND STORE.GND MOV16.GND MOV.GND FLAGS_TO_OUTBUFFER.GND INBUFFER_TO_FLAGS.GND JMP.GND JZ.GND JNC.GND JNZ.GND JNS.GND STORE_FLAGS_ON_STACK.GND ADDER_16BIT.GND IN.GND OUT.GND SAVE_FLAGS.GND RESTORE_FLAGS.GND LOAD_FLAGS_FROM_STACK.GND
I1: INSTRUCTION.1 ; port ALU.I1 SETAB.I1 HLT.I1 ALU_IN.I1 ALU_OUT.I1 LOAD.I1 STORE.I1 MOV.I1 MOV16.I1 FLAGS_TO_OUTBUFFER.I1 INBUFFER_TO_FLAGS.I1 STORE_FLAGS_ON_STACK.I1 LOAD_FLAGS_FROM_STACK.I1 JMP.I1 JZ.I1 JNC.I1 JNZ.I1 JNS.I1 ADDER_16BIT.I1 IN.I1 OUT.I1 SAVE_FLAGS.I1 RESTORE_FLAGS.I1
I2: INSTRUCTION.2 ; port ALU.I2 SETAB.I2 HLT.I2 ALU_IN.I2 ALU_OUT.I2 LOAD.I2 STORE.I2 MOV.I2 MOV16.I2 FLAGS_TO_OUTBUFFER.I2 INBUFFER_TO_FLAGS.I2 STORE_FLAGS_ON_STACK.I2 JMP.I2 JZ.I2 JNC.I2 JNZ.I2 JNS.I2 ADDER_16BIT.I2 IN.I2
I3: INSTRUCTION.3 ; port ALU.I3 SETAB.I3 HLT.I3 ALU_IN.I3 ALU_OUT.I3 LOAD.I3 STORE.I3 MOV.I3 MOV16.I3 FLAGS_TO_OUTBUFFER.I3 INBUFFER_TO_FLAGS.I3 STORE_FLAGS_ON_STACK.I3 LOAD_FLAGS_FROM_STACK.I3 JMP.I3 JZ.I3 JNC.I3 JNZ.I3 JNS.I3 ADDER_16BIT.I3 IN.I3 OUT.I3 SAVE_FLAGS.I3 RESTORE_FLAGS.I3
I4: INSTRUCTION.4 ; port ALU.I4 SETAB.I4 HLT.I4 ALU_IN.I4 ALU_OUT.I4 LOAD.I4 STORE.I4 MOV.I4 MOV16.I4 FLAGS_TO_OUTBUFFER.I4 INBUFFER_TO_FLAGS.I4 STORE_FLAGS_ON_STACK.I4 LOAD_FLAGS_FROM_STACK.I4 JMP.I4 JZ.I4 JNC.I4 JNZ.I4 JNS.I4 ADDER_16BIT.I4 IN.I4 OUT.I4 SAVE_FLAGS.I4 RESTORE_FLAGS.I4
I5: INSTRUCTION.5 ; port ALU.I5 SETAB.I5 HLT.I5 ALU_IN.I5 ALU_OUT.I5 LOAD.I5 STORE.I5 MOV.I5 MOV16.I5 FLAGS_TO_OUTBUFFER.I5 INBUFFER_TO_FLAGS.I5 STORE_FLAGS_ON_STACK.I5 LOAD_FLAGS_FROM_STACK.I5 JMP.I5 JZ.I5 JNC.I5 JNZ.I5 JNS.I5 ADDER_16BIT.I5 IN.I5 OUT.I5 SAVE_FLAGS.I5 RESTORE_FLAGS.I5
I6: INSTRUCTION.6 ; port ALU.I6 SETAB.I6 HLT.I6 ALU_IN.I6 ALU_OUT.I6 LOAD.I6 STORE.I6 MOV.I6 MOV16.I6 FLAGS_TO_OUTBUFFER.I6 INBUFFER_TO_FLAGS.I6 STORE_FLAGS_ON_STACK.I6 LOAD_FLAGS_FROM_STACK.I6 JMP.I6 JZ.I6 JNC.I6 JNZ.I6 JNS.I6 ADDER_16BIT.I6 IN.I6 OUT.I6 SAVE_FLAGS.I6 RESTORE_FLAGS.I6
I7: INSTRUCTION.7 ; port ALU.I7 SETAB.I7 HLT.I7 ALU_IN.I7 ALU_OUT.I7 LOAD.I7 STORE.I7 MOV.I7 MOV16.I7 FLAGS_TO_OUTBUFFER.I7 INBUFFER_TO_FLAGS.I7 STORE_FLAGS_ON_STACK.I7 LOAD_FLAGS_FROM_STACK.I7 JMP.I7 JZ.I7 JNC.I7 JNZ.I7 JNS.I7 ADDER_16BIT.I7 IN.I7 OUT.I7 SAVE_FLAGS.I7 RESTORE_FLAGS.I7
I8: INSTRUCTION.8 ; port ALU.I8 SETAB.I8 HLT.I8 ALU_IN.I8 ALU_OUT.I8 LOAD.I8 STORE.I8 MOV.I8 MOV16.I8 FLAGS_TO_OUTBUFFER.I8 INBUFFER_TO_FLAGS.I8 STORE_FLAGS_ON_STACK.I8 LOAD_FLAGS_FROM_STACK.I8 JMP.I8 JZ.I8 JNC.I8 JNZ.I8 JNS.I8 ADDER_16BIT.I8 IN.I8 OUT.I8 SAVE_FLAGS.I8 RESTORE_FLAGS.I8
INCREMETER: MISC1.3 ; port OR_MATRIX.INCREMENTER
LOAD_A_FROM_DATABUS: MISC1.13 ; port OR_MATRIX.LOAD_A_FROM_DATABUS
LOAD_ADDER16BIT_INPUT_A: MISC3.1 ; port OR_MATRIX.LOAD_ADDER16BIT_INPUTA
LOAD_ADDER16BIT_INPUT_B: MISC3.2 ; port OR_MATRIX.LOAD_ADDER16BIT_INPUTB
LOAD_ADDER16BIT_OUTPUT_C: MISC3.5 ; port OR_MATRIX.LOAD_ADDER16BIT_OUTPUTC
LOAD_B_FROM_DATABUS: MISC1.15 ; port OR_MATRIX.LOAD_B_FROM_DATABUS
LOAD_BP_FROM_ADDRESSBUS: REGISTER_CONTROL_LINES_16BIT.10 ; port OR_MATRIX.LOAD_BP_FROM_ADDRESSBUS
LOAD_C_FROM_DATABUS: MISC2.1 ; port OR_MATRIX.LOAD_C_FROM_DATABUS
LOAD_D_FROM_DATABUS: REGISTER_CONTROL_LINES_8BIT.15 ; port OR_MATRIX.LOAD_D_FROM_DATABUS
LOAD_E_FROM_DATABUS: REGISTER_CONTROL_LINES_8BIT.13 ; port OR_MATRIX.LOAD_E_FROM_DATABUS
LOAD_F_FROM_DATABUS: REGISTER_CONTROL_LINES_8BIT.11 ; port OR_MATRIX.LOAD_F_FROM_DATABUS
LOAD_FLAGS: MISC2.6 ; port OR_MATRIX.LOAD_FLAGS
LOAD_FLAGS_FROM_DATABUS: MISC2.10 ; port OR_MATRIX.LOAD_FLAGS_FROM_DATABUS
LOAD_FLAGS_FROM_FLAGSBUS: MISC2.8 ; port OR_MATRIX.LOAD_FLAGS_FROM_FLAGSBUS
LOAD_FLAGSSAVED_FROM_FLAGS_REGISTER: MISC2.12 ; port OR_MATRIX.LOAD_FLAGSSAVED_FROM_FLAGS_REGISTER
LOAD_FLAGSSAVED_TO_FLAGS_REGISTER: MISC2.11 ; port OR_MATRIX.LOAD_FLAGSSAVED_TO_FLAGS_REGISTER
LOAD_G_FROM_DATABUS: REGISTER_CONTROL_LINES_8BIT.9 ; port OR_MATRIX.LOAD_G_FROM_DATABUS
LOAD_H_FROM_DATABUS: REGISTER_CONTROL_LINES_8BIT.7 ; port OR_MATRIX.LOAD_H_FROM_DATABUS
LOAD_INC: MISC1.6 ; port OR_MATRIX.LOAD_INC
LOAD_INSTRUCTION: MISC1.8 ; port OR_MATRIX.LOAD_INSTRUCTION
LOAD_INTERNAL_A_FROM_DATABUS: MISC1.10 ; port OR_MATRIX.LOAD_INTERNALA_FROM_DATABUS
LOAD_J_FROM_ADDRESSBUS: REGISTER_CONTROL_LINES_16BIT.6 ; port OR_MATRIX.LOAD_J_FROM_ADDRESSBUS
LOAD_M_FROM_ADDRESSBUS: REGISTER_CONTROL_LINES_16BIT.4 ; port OR_MATRIX.LOAD_M_FROM_ADDRESSBUS
LOAD_PC: MISC1.4 ; port OR_MATRIX.LOAD_PC
LOAD_PORT_C_FROM_DATABUS: MISC2.15 ; port OR_MATRIX.LOAD_PORTC_FROM_DATABUS
LOAD_PORT_D_FROM_DATABUS: MISC2.16 ; port OR_MATRIX.LOAD_PORTD_FROM_DATABUS
LOAD_SP_FROM_ADDRESSBUS: REGISTER_CONTROL_LINES_16BIT.8 ; port OR_MATRIX.LOAD_SP_FROM_ADDRESSBUS
LOAD_SRAM: MISC1.2 ; port OR_MATRIX.LOAD_SRAM
LOAD_X_FROM_ADDRESSBUS: REGISTER_CONTROL_LINES_16BIT.2 ; port OR_MATRIX.LOAD_X_FROM_ADDRESSBUS
LOAD_XE_FROM_DATABUS: REGISTER_CONTROL_LINES_8BIT.1 ; port OR_MATRIX.LOAD_XE_FROM_DATABUS
LOAD_XH_FROM_DATABUS: REGISTER_CONTROL_LINES_8BIT.3 ; port OR_MATRIX.LOAD_XH_FROM_DATABUS
LOAD_XL_FROM_DATABUS: REGISTER_CONTROL_LINES_8BIT.5 ; port OR_MATRIX.LOAD_XL_FROM_DATABUS
LOAD_Y_FROM_ADDRESSBUS: REGISTER_CONTROL_LINES_16BIT.12 ; port OR_MATRIX.LOAD_Y_FROM_ADDRESSBUS
LOAD_Z_FROM_ADDRESSBUS: REGISTER_CONTROL_LINES_16BIT.14 ; port OR_MATRIX.LOAD_Z_FROM_ADDRESSBUS
N$158: port LOAD_FLAGS_FROM_STACK.I2 OUT.I2 SAVE_FLAGS.I2 RESTORE_FLAGS.I2
SELECT_A_TO_ALU: MISC1.14 ; port OR_MATRIX.SELECT_A_TO_ALU
SELECT_ADDER16BIT_INPUT_A: MISC3.3 ; port OR_MATRIX.SELECT_ADDER16BIT_INPUTA
SELECT_ADDER16BIT_INPUT_B: MISC3.4 ; port OR_MATRIX.SELECT_ADDER16BIT_INPUTB
SELECT_ADDER16BIT_OUTPUTC: MISC3.6 ; port OR_MATRIX.SELECT_ADDER16BIT_OUTPUTC
SELECT_B_TO_ALU: MISC1.16 ; port OR_MATRIX.SELECT_B_TO_ALU
SELECT_BP_TO_ADDRESSBUS: REGISTER_CONTROL_LINES_16BIT.9 ; port OR_MATRIX.SELECT_BP_TO_ADDRESSBUS
SELECT_C_TO_DATABUS: MISC2.2 ; port OR_MATRIX.SELECT_C_TO_DATABUS
SELECT_D_TO_DATABUS: REGISTER_CONTROL_LINES_8BIT.16 ; port OR_MATRIX.SELECT_D_TO_DATABUS
SELECT_E_TO_DATABUS: REGISTER_CONTROL_LINES_8BIT.14 ; port OR_MATRIX.SELECT_E_TO_DATABUS
SELECT_F_TO_DATABUS: REGISTER_CONTROL_LINES_8BIT.12 ; port OR_MATRIX.SELECT_F_TO_DATABUS
SELECT_FLAGS: MISC2.5 ; port OR_MATRIX.SELECT_FLAGS
SELECT_FLAGS_TO_DATABUS: MISC2.9 ; port OR_MATRIX.SELECT_FLAGS_TO_DATABUS
SELECT_FLAGS_TO_FLAGSBUS: MISC2.7 ; port OR_MATRIX.SELECT_FLAGSTOFLAGSBUS
SELECT_G_TO_DATABUS: REGISTER_CONTROL_LINES_8BIT.10 ; port OR_MATRIX.SELECT_G_TO_DATABUS
SELECT_H_TO_DATABUS: REGISTER_CONTROL_LINES_8BIT.8 ; port OR_MATRIX.SELECT_H_TO_DATABUS
SELECT_INC: MISC1.7 ; port OR_MATRIX.SELECT_INC
SELECT_INSTRUCTION_TO_DATABUS: MISC1.9 ; port OR_MATRIX.SELECT_INSTR_TO_DATABUS
SELECT_INTERNAL_A_TO_DATABUS: MISC1.11 ; port OR_MATRIX.SELECT_INTERNALA_TO_DATABUS
SELECT_J_TO_ADDRESSBUS: REGISTER_CONTROL_LINES_16BIT.5 ; port OR_MATRIX.SELECT_J_TO_ADDRESSBUS
SELECT_M_TO_ADDRESSBUS: REGISTER_CONTROL_LINES_16BIT.3 ; port OR_MATRIX.SELECT_M_TO_ADDRESSBUS
SELECT_PC: MISC1.5 ; port OR_MATRIX.SELECT_PC
SELECT_PORT_A_TO_DATABUS: MISC2.13 ; port OR_MATRIX.SELECT_PORTA_TO_DATABUS
SELECT_PORT_B_TO_DATABUS: MISC2.14 ; port OR_MATRIX.SELECT_PORTB_TO_DATABUS
SELECT_SP_TO_ADDRESSBUS: REGISTER_CONTROL_LINES_16BIT.7 ; port OR_MATRIX.SELECT_SP_TO_ADDRESSBUS
SELECT_SRAM: MISC1.1 ; port OR_MATRIX.SELECT_SRAM
SELECT_X_TO_ADDRESSBUS: REGISTER_CONTROL_LINES_16BIT.1 ; port OR_MATRIX.SELECT_X_TO_ADDRESSBUS
SELECT_XE_TO_DATABUS: REGISTER_CONTROL_LINES_8BIT.2 ; port OR_MATRIX.SELECT_XE_TO_DATABUS
SELECT_XH_TO_DATABUS: REGISTER_CONTROL_LINES_8BIT.4 ; port OR_MATRIX.SELECT_XH_TO_DATABUS
SELECT_XL_TO_DATABUS: REGISTER_CONTROL_LINES_8BIT.6 ; port OR_MATRIX.SELECT_XL_TO_DATABUS
SELECT_Y_TO_ADDRESSBUS: REGISTER_CONTROL_LINES_16BIT.11 ; port OR_MATRIX.SELECT_Y_TO_ADDRESSBUS
SELECT_Z_TO_ADDRESSBUS: REGISTER_CONTROL_LINES_16BIT.13 ; port OR_MATRIX.SELECT_Z_TO_ADDRESSBUS
SIGN: FLAGS.1 ; port JNS.SIGN
STOPCPU: MISC2.3 ; port OR_MATRIX.STOPCPU
T1: T-STATES.1 ; port ALU.T1 SETAB.T1 FETCH_INCREMENT.T1 ALU_IN.T1 ALU_OUT.T1 LOAD.T1 STORE.T1 MOV.T1 MOV16.T1 FLAGS_TO_OUTBUFFER.T1 INBUFFER_TO_FLAGS.T1 STORE_FLAGS_ON_STACK.T1 LOAD_FLAGS_FROM_STACK.T1 JMP.T1 JZ.T1 JNC.T1 JNZ.T1 JNS.T1 ADDER_16BIT.T1 IN.T1 OUT.T1 SAVE_FLAGS.T1 RESTORE_FLAGS.T1
T2: T-STATES.2 ; port ALU.T2 SETAB.T2 FETCH_INCREMENT.T2 ALU_IN.T2 ALU_OUT.T2 LOAD.T2 STORE.T2 MOV.T2 MOV16.T2 FLAGS_TO_OUTBUFFER.T2 INBUFFER_TO_FLAGS.T2 STORE_FLAGS_ON_STACK.T2 LOAD_FLAGS_FROM_STACK.T2 JMP.T2 JZ.T2 JNC.T2 JNZ.T2 JNS.T2 ADDER_16BIT.T2 IN.T2 OUT.T2 SAVE_FLAGS.T2 RESTORE_FLAGS.T2
T3: T-STATES.3 ; port ALU.T3 SETAB.T3 FETCH_INCREMENT.T3 ALU_IN.T3 ALU_OUT.T3 LOAD.T3 STORE.T3 MOV.T3 MOV16.T3 FLAGS_TO_OUTBUFFER.T3 INBUFFER_TO_FLAGS.T3 STORE_FLAGS_ON_STACK.T3 LOAD_FLAGS_FROM_STACK.T3 JMP.T3 JZ.T3 JNC.T3 JNZ.T3 JNS.T3 ADDER_16BIT.T3 IN.T3 OUT.T3 SAVE_FLAGS.T3 RESTORE_FLAGS.T3
T4: T-STATES.4 ; port ALU.T4 SETAB.T4 FETCH_INCREMENT.T4 ALU_IN.T4 ALU_OUT.T4 LOAD.T4 STORE.T4 MOV.T4 MOV16.T4 FLAGS_TO_OUTBUFFER.T4 INBUFFER_TO_FLAGS.T4 STORE_FLAGS_ON_STACK.T4 LOAD_FLAGS_FROM_STACK.T4 JMP.T4 JZ.T4 JNC.T4 JNZ.T4 JNS.T4 ADDER_16BIT.T4 IN.T4 OUT.T4 SAVE_FLAGS.T4 RESTORE_FLAGS.T4
T5: T-STATES.5 ; port ALU.T5 SETAB.T5 FETCH_INCREMENT.T5 ALU_IN.T5 ALU_OUT.T5 LOAD.T5 STORE.T5 MOV.T5 MOV16.T5 FLAGS_TO_OUTBUFFER.T5 INBUFFER_TO_FLAGS.T5 STORE_FLAGS_ON_STACK.T5 LOAD_FLAGS_FROM_STACK.T5 JMP.T5 JZ.T5 JNC.T5 JNZ.T5 JNS.T5 ADDER_16BIT.T5 IN.T5 OUT.T5 SAVE_FLAGS.T5 RESTORE_FLAGS.T5
T6: T-STATES.6 ; port ALU.T6 SETAB.T6 FETCH_INCREMENT.T6 ALU_IN.T6 ALU_OUT.T6 LOAD.T7 STORE.T6 MOV.T6 MOV16.T6 FLAGS_TO_OUTBUFFER.T6 INBUFFER_TO_FLAGS.T6 STORE_FLAGS_ON_STACK.T6 LOAD_FLAGS_FROM_STACK.T6 JMP.T6 JZ.T6 JNC.T6 JNZ.T6 JNS.T6 ADDER_16BIT.T6 IN.T6 OUT.T6 SAVE_FLAGS.T6 RESTORE_FLAGS.T6
T7: T-STATES.7 ; port ALU.T7 SETAB.T7 FETCH_INCREMENT.T7 ALU_IN.T7 ALU_OUT.T7 LOAD.T6 STORE.T7 MOV.T7 MOV16.T7 FLAGS_TO_OUTBUFFER.T7 INBUFFER_TO_FLAGS.T7 STORE_FLAGS_ON_STACK.T7 LOAD_FLAGS_FROM_STACK.T7 JMP.T7 JZ.T7 JNC.T7 JNZ.T7 JNS.T7 ADDER_16BIT.T7 IN.T7 OUT.T7 SAVE_FLAGS.T7 RESTORE_FLAGS.T7
T8: T-STATES.8 ; port ALU.T8 SETAB.T8 FETCH_INCREMENT.T8 ALU_IN.T8 ALU_OUT.T8 LOAD.T8 STORE.T8 MOV.T8 MOV16.T8 FLAGS_TO_OUTBUFFER.T8 INBUFFER_TO_FLAGS.T8 STORE_FLAGS_ON_STACK.T8 LOAD_FLAGS_FROM_STACK.T8 JMP.T8 JZ.T8 JNC.T8 JNZ.T8 JNS.T8 ADDER_16BIT.T8 IN.T8 OUT.T8 SAVE_FLAGS.T8 RESTORE_FLAGS.T8
VCC: POWER.1 ; port STORE.VCC FETCH_INCREMENT.VCC SETAB.VCC ALU.VCC ALU_IN.VCC ALU_OUT.VCC LOAD.VCC HLT.VCC MOV16.VCC MOV.VCC FLAGS_TO_OUTBUFFER.VCC INBUFFER_TO_FLAGS.VCC JMP.VCC JZ.VCC JNC.VCC JNZ.VCC JNS.VCC STORE_FLAGS_ON_STACK.VCC ADDER_16BIT.VCC IN.VCC OUT.VCC SAVE_FLAGS.VCC RESTORE_FLAGS.VCC LOAD_FLAGS_FROM_STACK.VCC
ZERO: FLAGS.2 ; port JZ.ZERO JNZ.ZERO
Unconnected: MISC1.12 REGISTER_CONTROL_LINES_16BIT.15 REGISTER_CONTROL_LINES_16BIT.16

### Library data of the parts
FLAGS = pinhead:PINHD-1X3: PIN HEADER
INSTRUCTION T-STATES = pinhead:PINHD-1X8: PIN HEADER
MISC1 MISC2 REGISTER_CONTROL_LINES_8BIT REGISTER_CONTROL_LINES_16BIT = pinhead:PINHD-1X16: PIN HEADER
MISC3 = pinhead:PINHD-1X6: PIN HEADER
POWER = pinhead:PINHD-1X2: PIN HEADER

## Module CLOCK
Ports: VCC(in) GND(in) START(in) S1(out) S2(out) S3(out) CLOCK(out) AUTO_MANUAL(in) MANUAL_TICK(in)
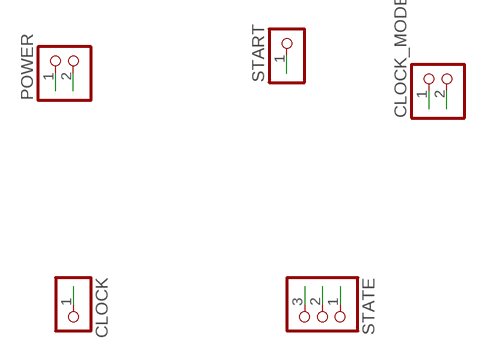
[diagram p88: schematic, module CLOCK, sheet 1]

### Parts
CLOCK  PINHD-1X1  [1X01]
CLOCK_MODE  PINHD-1X2  [1X02]
POWER  PINHD-1X2  [1X02]
START  PINHD-1X1  [1X01]
STATE  PINHD-1X3  [1X03]

### Nets
AUTO_MANUAL: CLOCK_MODE.1
CLOCK: CLOCK.1
GND: POWER.2
MANUAL_TICK: CLOCK_MODE.2
S1: STATE.1
S2: STATE.2
S3: STATE.3
START: START.1
VCC: POWER.1

### Library data of the parts
CLOCK START = pinhead:PINHD-1X1: PIN HEADER
CLOCK_MODE POWER = pinhead:PINHD-1X2: PIN HEADER
STATE = pinhead:PINHD-1X3: PIN HEADER

## Module SRAM_MEMORY
Ports: VCC(in) GND(in) D1(io) D2(io) D3(io) D4(io) D5(io) D6(io) D7(io) D8(io) WRITE(in) READ(in) A1(io) A2(io) A3(io) A4(io) A5(io) A6(io) A7(io) A8(io) A9(io) A10(io) A11(io) A12(io) A13(io) A14(io) A15(io) A16(io)
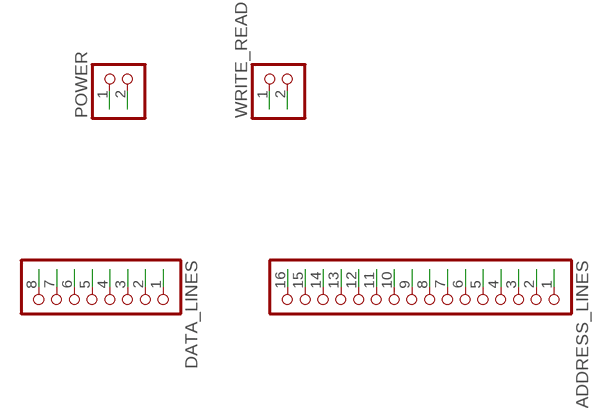
[diagram p89: schematic, module SRAM_MEMORY, sheet 1]

### Parts
ADDRESS_LINES  PINHD-1X16  [1X16]
DATA_LINES  PINHD-1X8  [1X08]
POWER  PINHD-1X2  [1X02]
WRITE_READ  PINHD-1X2  [1X02]

### Nets
A1: ADDRESS_LINES.1
A2: ADDRESS_LINES.2
A3: ADDRESS_LINES.3
A4: ADDRESS_LINES.4
A5: ADDRESS_LINES.5
A6: ADDRESS_LINES.6
A7: ADDRESS_LINES.7
A8: ADDRESS_LINES.8
A9: ADDRESS_LINES.9
A10: ADDRESS_LINES.10
A11: ADDRESS_LINES.11
A12: ADDRESS_LINES.12
A13: ADDRESS_LINES.13
A14: ADDRESS_LINES.14
A15: ADDRESS_LINES.15
A16: ADDRESS_LINES.16
D1: DATA_LINES.1
D2: DATA_LINES.2
D3: DATA_LINES.3
D4: DATA_LINES.4
D5: DATA_LINES.5
D6: DATA_LINES.6
D7: DATA_LINES.7
D8: DATA_LINES.8
GND: POWER.2
READ: WRITE_READ.2
VCC: POWER.1
WRITE: WRITE_READ.1

### Library data of the parts
ADDRESS_LINES = pinhead:PINHD-1X16: PIN HEADER
DATA_LINES = pinhead:PINHD-1X8: PIN HEADER
POWER WRITE_READ = pinhead:PINHD-1X2: PIN HEADER

## Module INTERNAL_A
Ports: VCC(in) GND(in) CLOCK(in) WRITE(in) READ(in) INPUT_1(in) INPUT_2(in) INPUT_3(in) INPUT_4(in) INPUT_5(in) INPUT_6(in) INPUT_7(in) INPUT_8(in) OUTPUT_1(out) OUTPUT_2(out) OUTPUT_3(out) OUTPUT_4(out) OUTPUT_6(out) OUTPUT_5(out) OUTPUT_7(out) OUTPUT_8(out)
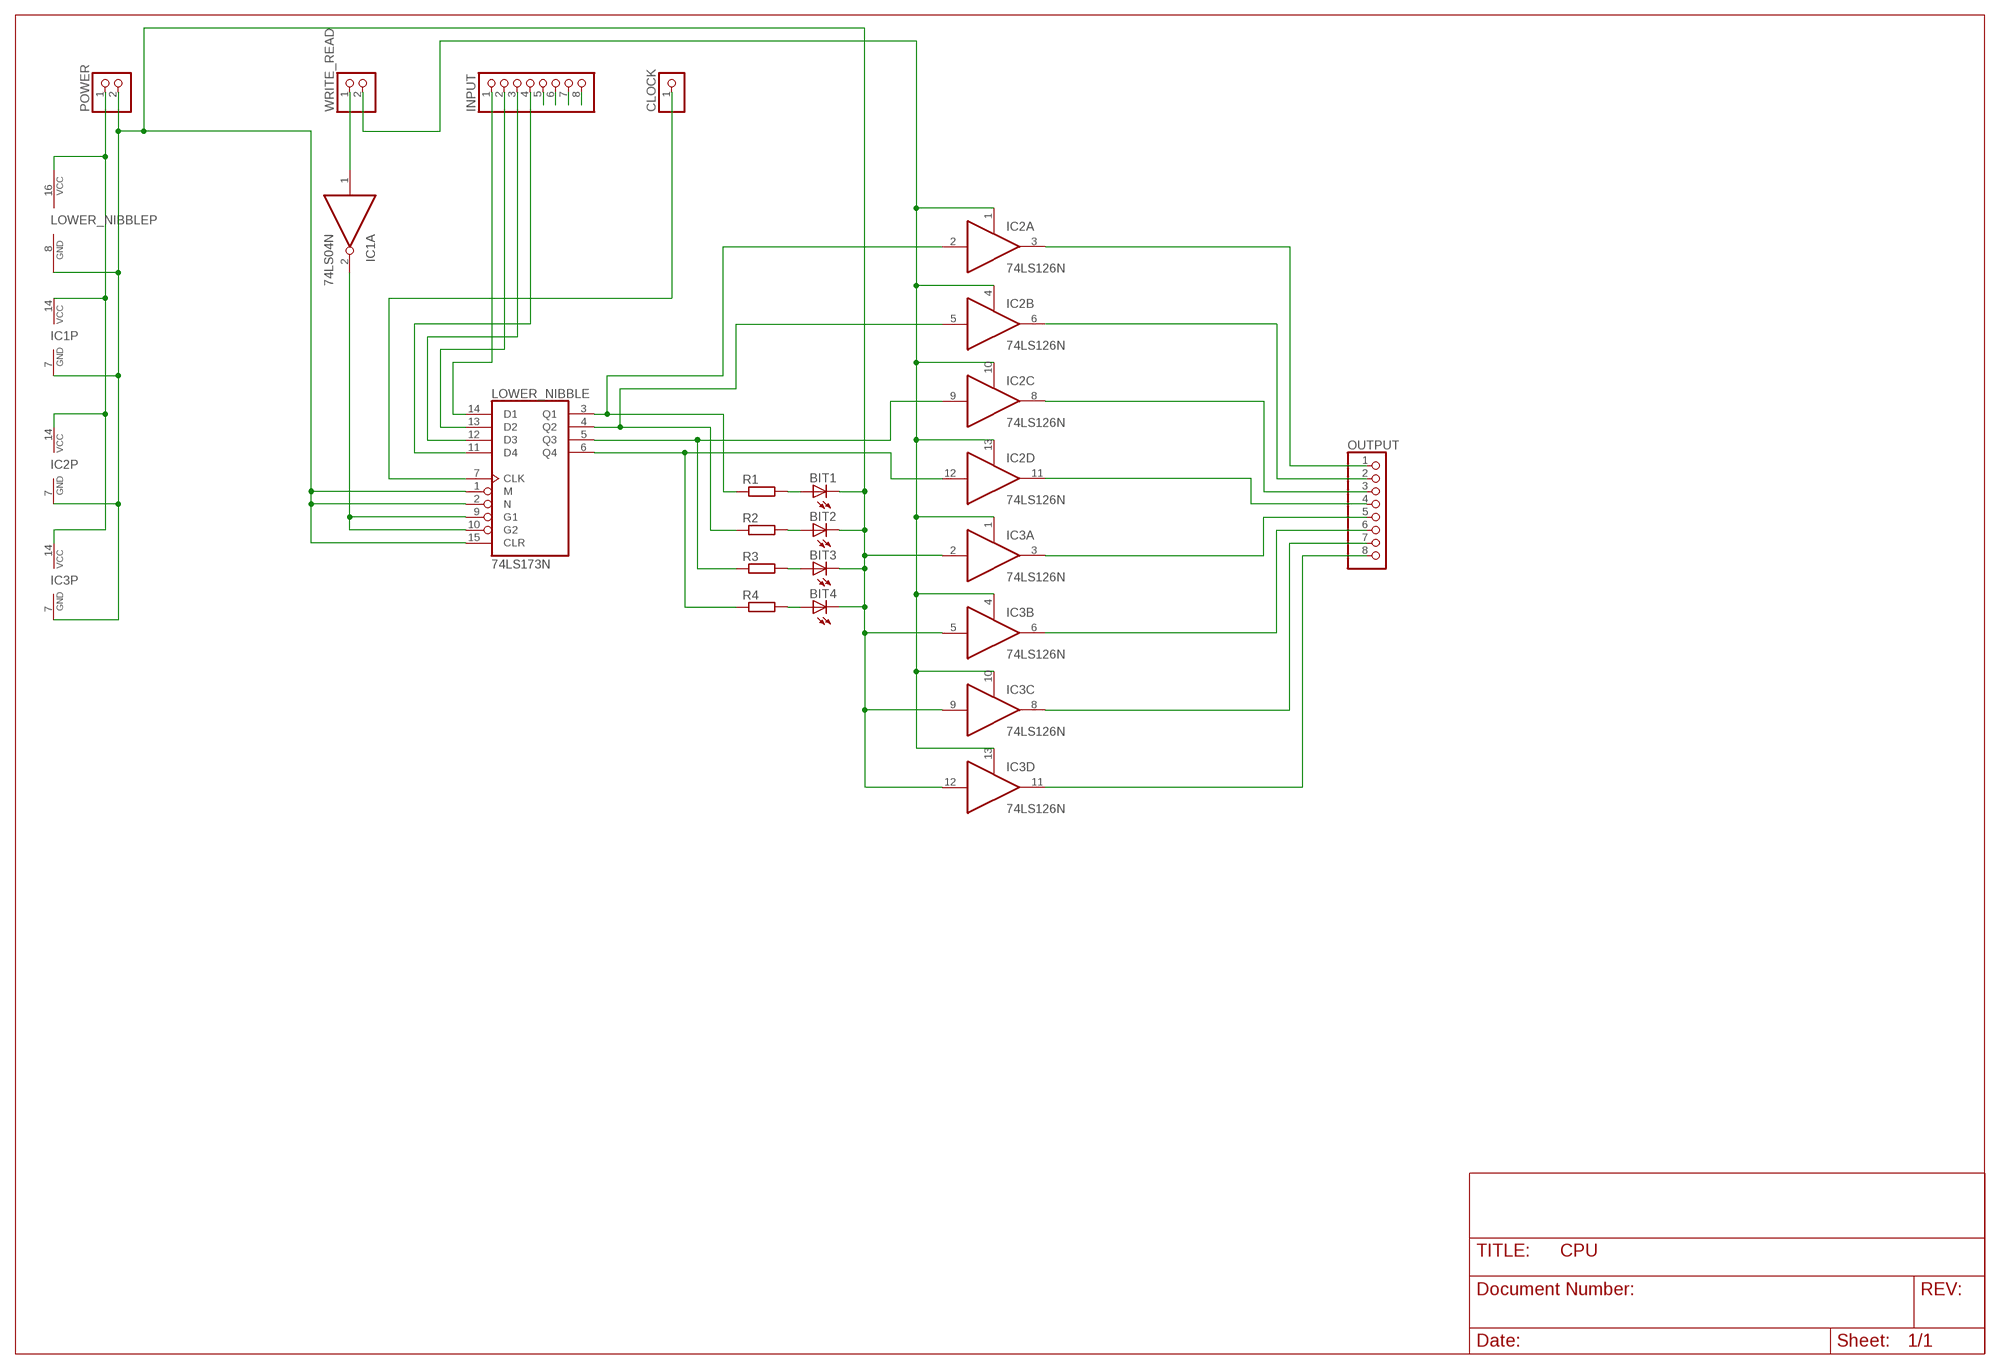
[diagram p90: schematic, module INTERNAL_A, sheet 1]

### Parts
BIT1  LED3MM  [LED3MM]
BIT2  LED3MM  [LED3MM]
BIT3  LED3MM  [LED3MM]
BIT4  LED3MM  [LED3MM]
CLOCK  PINHD-1X1  [1X01]
IC1  74LS04N  [DIL14]
IC2  74LS126N  [DIL14]
IC3  74LS126N  [DIL14]
INPUT  PINHD-1X8  [1X08]
LOWER_NIBBLE  74LS173N  [DIL16]
OUTPUT  PINHD-1X8  [1X08]
POWER  PINHD-1X2  [1X02]
R1  R-EU_0207/10  [0207/10]
R2  R-EU_0207/10  [0207/10]
R3  R-EU_0207/10  [0207/10]
R4  R-EU_0207/10  [0207/10]
WRITE_READ  PINHD-1X2  [1X02]

### Nets
CLOCK: CLOCK.1 LOWER_NIBBLE.7(CLK)
GND: BIT1.K(C) BIT2.K(C) BIT3.K(C) BIT4.K(C) IC1.7(P:GND) IC2.7(P:GND) IC3.2(A:I) IC3.5(B:I) IC3.7(P:GND) IC3.9(C:I) IC3.12(D:I) LOWER_NIBBLE.1(M) LOWER_NIBBLE.2(N) LOWER_NIBBLE.8(GND) LOWER_NIBBLE.15(CLR) POWER.2
INPUT_1: INPUT.1 LOWER_NIBBLE.14(D1)
INPUT_2: INPUT.2 LOWER_NIBBLE.13(D2)
INPUT_3: INPUT.3 LOWER_NIBBLE.12(D3)
INPUT_4: INPUT.4 LOWER_NIBBLE.11(D4)
INPUT_5: INPUT.5
INPUT_6: INPUT.6
INPUT_7: INPUT.7
INPUT_8: INPUT.8
N$3: BIT1.A R1.2
N$5: BIT2.A R2.2
N$6: BIT3.A R3.2
N$7: BIT4.A R4.2
N$12: IC1.2(A:O) LOWER_NIBBLE.9(G1) LOWER_NIBBLE.10(G2)
N$22: IC2.2(A:I) LOWER_NIBBLE.3(Q1) R1.1
N$23: IC2.5(B:I) LOWER_NIBBLE.4(Q2) R2.1
N$24: IC2.9(C:I) LOWER_NIBBLE.5(Q3) R3.1
N$25: IC2.12(D:I) LOWER_NIBBLE.6(Q4) R4.1
OUTPUT_1: IC2.3(A:O) OUTPUT.1
OUTPUT_2: IC2.6(B:O) OUTPUT.2
OUTPUT_3: IC2.8(C:O) OUTPUT.3
OUTPUT_4: IC2.11(D:O) OUTPUT.4
OUTPUT_5: IC3.3(A:O) OUTPUT.5
OUTPUT_6: IC3.6(B:O) OUTPUT.6
OUTPUT_7: IC3.8(C:O) OUTPUT.7
OUTPUT_8: IC3.11(D:O) OUTPUT.8
READ: IC2.1(A:OE) IC2.4(B:OE) IC2.10(C:OE) IC2.13(D:OE) IC3.1(A:OE) IC3.4(B:OE) IC3.10(C:OE) IC3.13(D:OE) WRITE_READ.2
VCC: IC1.14(P:VCC) IC2.14(P:VCC) IC3.14(P:VCC) LOWER_NIBBLE.16(VCC) POWER.1
WRITE: IC1.1(A:I) WRITE_READ.1
Unconnected: IC1.3(B:I) IC1.4(B:O) IC1.5(C:I) IC1.6(C:O) IC1.8(D:O) IC1.9(D:I) IC1.10(E:O) IC1.11(E:I) IC1.12(F:O) IC1.13(F:I)

### Library data of the parts
BIT1-BIT4 = led:LED: LED OSRAM: - CHIPLED LG R971, LG N971, LY N971, LG Q971, LY Q971, LO R971, LY R971 LH N974, LH R974 LS Q976, LO Q976, LY Q976 LO Q996 - Hyper CHIPLED LW Q18S LB Q993, LB Q99A, LB R99A - SideLED LS A670, LO A670, LY A670, LG A670, LP A670 LB A673, LV A673, LT A673, LW A673 LH A674 LY A675 LS A676, LA A676, LO A676, LY A676, LW A676 LS A679, LY A679, LG A679 - Hyper Micro SIDELED® LS Y876, LA Y876, LO Y876, LY Y876 LT Y87S - SmartLED LW L88C, LW L88S LB L89C, LB L89S, LG L890 LS L89K, LO L89K, LY L89K LS L896, LA L896, LO L896, LY L896 - TOPLED LS T670, LO T670, LY T670, LG T670, LP T670 LSG T670, LSP T670, LSY T670, LOP T670, LYG T670 LG T671, LOG T671, LSG T671 LB T673, LV T673, LT T673, LW T673 LH T674 LS T676, LA T676, LO T676, LY T676, LB T676, LH T676, LSB T676, LW T676 LB T67C, LV T67C, LT T67C, LS T67K, LO T67K, LY T67K, LW E67C LS E67B, LA E67B, LO E67B, LY E67B, LB E67C, LV E67C, LT E67C LW T67C LS T679, LY T679, LG T679 LS T770, LO T770, LY T770, LG T770, LP T770 LB T773, LV T773, LT T773, LW T773 LH T774 LS E675, LA E675, LY E675, LS T675 LS T776, LA T776, LO T776, LY T776, LB T776 LHGB T686 LT T68C, LB T68C - Hyper Mini TOPLED® LB M676 - Mini TOPLED Santana® LG M470 LS M47K, LO M47K, LY M47K Source: http://www.osram.convergy.de LUXEON: - LUMILED® LXK2-PW12-R00, LXK2-PW12-S00, LXK2-PW14-U00, LXK2-PW14-V00 LXK2-PM12-R00, LXK2-PM12-S00, LXK2-PM14-U00 LXK2-PE12-Q00, LXK2-PE12-R00, LXK2-PE12-S00, LXK2-PE14-T00, LXK2-PE14-U00 LXK2-PB12-K00, LXK2-PB12-L00, LXK2-PB12-M00, LXK2-PB14-N00, LXK2-PB14-P00, LXK2-PB14-Q00 LXK2-PR12-L00, LXK2-PR12-M00, LXK2-PR14-Q00, LXK2-PR14-R00 LXK2-PD12-Q00, LXK2-PD12-R00, LXK2-PD12-S00 LXK2-PH12-R00, LXK2-PH12-S00 LXK2-PL12-P00, LXK2-PL12-Q00, LXK2-PL12-R00 Source: www.luxeon.com KINGBRIGHT: KA-3528ASYC Source: www.kingbright.com
CLOCK = pinhead:PINHD-1X1: PIN HEADER
IC1 = 74xx-eu:74*04: Hex INVERTER
IC2 IC3 = 74xx-eu:74*126: Quad bus BUFFER, 3-state
INPUT OUTPUT = pinhead:PINHD-1X8: PIN HEADER
LOWER_NIBBLE = 74xx-us:74*173: 4-bit D type REGISTER, 3-state
POWER WRITE_READ = pinhead:PINHD-1X2: PIN HEADER
R1-R4 = resistor:R-EU_: RESISTOR, European symbol

## Module INSTRUCTION_REGISTER_8BIT
Ports: VCC(in) GND(in) CLOCK(in) WRITE(in) INPUT_1(in) INPUT_2(in) INPUT_3(in) INPUT_4(in) INPUT_5(in) INPUT_6(in) INPUT_7(in) INPUT_8(in) CURRENT_INSTRUCTION_1(out) CURRENT_INSTRUCTION_2(out) CURRENT_INSTRUCTION_3(out) CURRENT_INSTRUCTION_4(out) CURRENT_INSTRUCTION_5(out) CURRENT_INSTRUCTION_6(out) CURRENT_INSTRUCTION_7(out) CURRENT_INSTRUCTION_8(out)
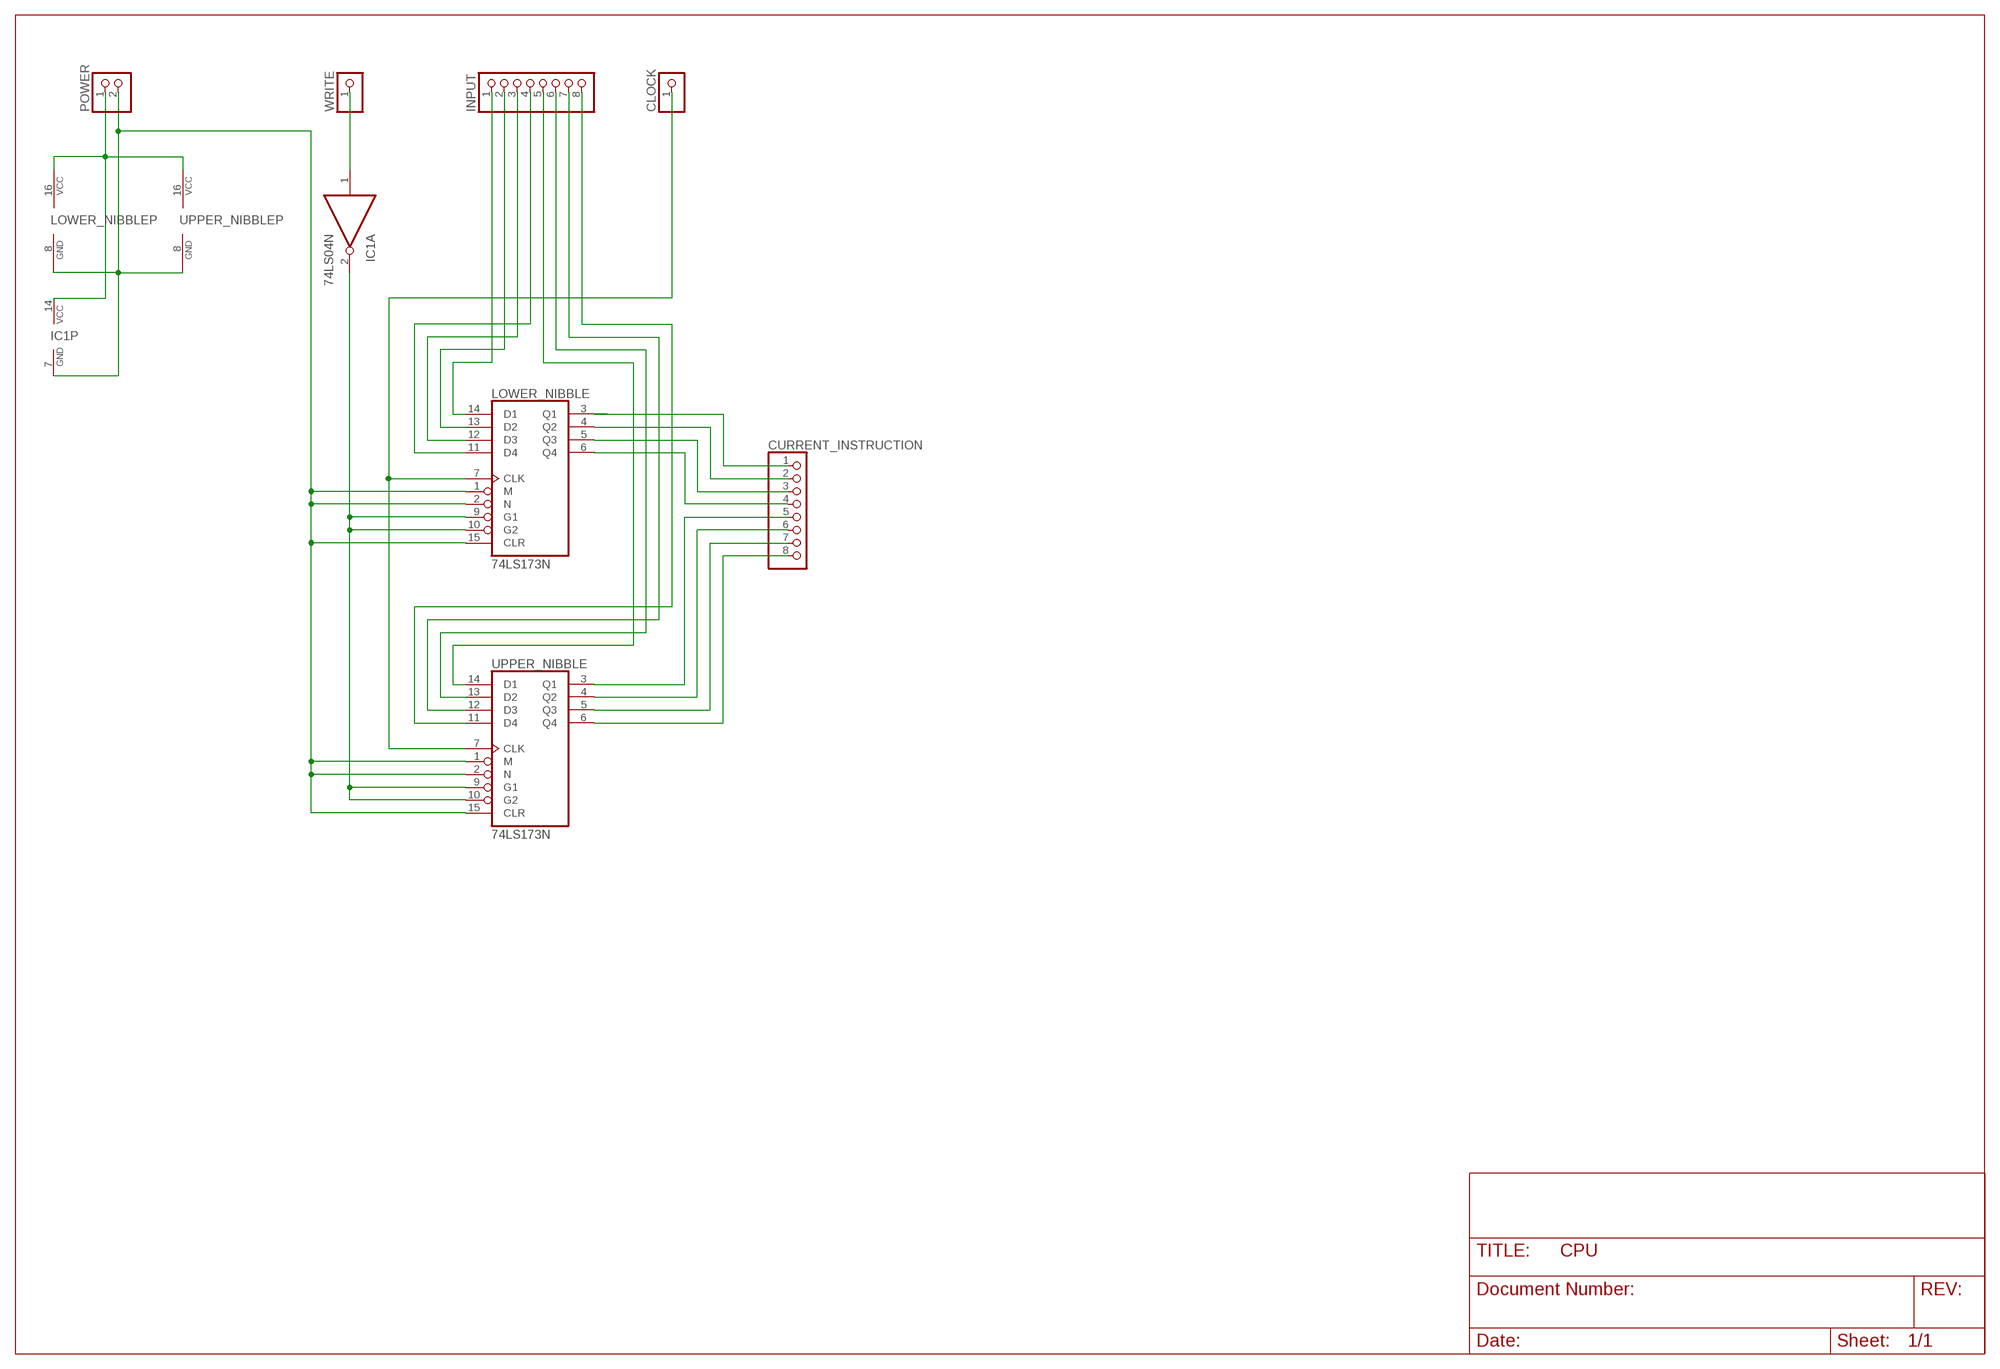
[diagram p91: schematic, module INSTRUCTION_REGISTER_8BIT, sheet 1]

### Parts
CLOCK  PINHD-1X1  [1X01]
CURRENT_INSTRUCTION  PINHD-1X8  [1X08]
IC1  74LS04N  [DIL14]
INPUT  PINHD-1X8  [1X08]
LOWER_NIBBLE  74LS173N  [DIL16]
POWER  PINHD-1X2  [1X02]
UPPER_NIBBLE  74LS173N  [DIL16]
WRITE  PINHD-1X1  [1X01]

### Nets
CLOCK: CLOCK.1 LOWER_NIBBLE.7(CLK) UPPER_NIBBLE.7(CLK)
CURRENT_INSTRUCTION_1: CURRENT_INSTRUCTION.1 LOWER_NIBBLE.3(Q1)
CURRENT_INSTRUCTION_2: CURRENT_INSTRUCTION.2 LOWER_NIBBLE.4(Q2)
CURRENT_INSTRUCTION_3: CURRENT_INSTRUCTION.3 LOWER_NIBBLE.5(Q3)
CURRENT_INSTRUCTION_4: CURRENT_INSTRUCTION.4 LOWER_NIBBLE.6(Q4)
CURRENT_INSTRUCTION_5: CURRENT_INSTRUCTION.5 UPPER_NIBBLE.3(Q1)
CURRENT_INSTRUCTION_6: CURRENT_INSTRUCTION.6 UPPER_NIBBLE.4(Q2)
CURRENT_INSTRUCTION_7: CURRENT_INSTRUCTION.7 UPPER_NIBBLE.5(Q3)
CURRENT_INSTRUCTION_8: CURRENT_INSTRUCTION.8 UPPER_NIBBLE.6(Q4)
GND: IC1.7(P:GND) LOWER_NIBBLE.1(M) LOWER_NIBBLE.2(N) LOWER_NIBBLE.8(GND) LOWER_NIBBLE.15(CLR) POWER.2 UPPER_NIBBLE.1(M) UPPER_NIBBLE.2(N) UPPER_NIBBLE.8(GND) UPPER_NIBBLE.15(CLR)
INPUT_1: INPUT.1 LOWER_NIBBLE.14(D1)
INPUT_2: INPUT.2 LOWER_NIBBLE.13(D2)
INPUT_3: INPUT.3 LOWER_NIBBLE.12(D3)
INPUT_4: INPUT.4 LOWER_NIBBLE.11(D4)
INPUT_5: INPUT.5 UPPER_NIBBLE.14(D1)
INPUT_6: INPUT.6 UPPER_NIBBLE.13(D2)
INPUT_7: INPUT.7 UPPER_NIBBLE.12(D3)
INPUT_8: INPUT.8 UPPER_NIBBLE.11(D4)
N$12: IC1.2(A:O) LOWER_NIBBLE.9(G1) LOWER_NIBBLE.10(G2) UPPER_NIBBLE.9(G1) UPPER_NIBBLE.10(G2)
VCC: IC1.14(P:VCC) LOWER_NIBBLE.16(VCC) POWER.1 UPPER_NIBBLE.16(VCC)
WRITE: IC1.1(A:I) WRITE.1
Unconnected: IC1.3(B:I) IC1.4(B:O) IC1.5(C:I) IC1.6(C:O) IC1.8(D:O) IC1.9(D:I) IC1.10(E:O) IC1.11(E:I) IC1.12(F:O) IC1.13(F:I)

### Library data of the parts
CLOCK WRITE = pinhead:PINHD-1X1: PIN HEADER
CURRENT_INSTRUCTION INPUT = pinhead:PINHD-1X8: PIN HEADER
IC1 = 74xx-eu:74*04: Hex INVERTER
LOWER_NIBBLE UPPER_NIBBLE = 74xx-us:74*173: 4-bit D type REGISTER, 3-state
POWER = pinhead:PINHD-1X2: PIN HEADER

## Module INSTRUCTION_REGISTER_8BIT_PART2
Ports: INPUT_1(in) INPUT_2(in) INPUT_3(in) INPUT_5(in) INPUT_4(in) INPUT_6(in) INPUT_7(in) INPUT_8(in) OUTPUT_1(out) OUTPUT_2(out) OUTPUT_3(out) OUTPUT_4(out) OUTPUT_5(out) OUTPUT_6(out) OUTPUT_7(out) OUTPUT_8(out) VCC(in) GND(in) READ(in) CURRENT_STATE_1(out) CURRENT_STATE_2(out) CURRENT_STATE_3(out) CURRENT_STATE_4(out) CURRENT_STATE_5(out) CURRENT_STATE_6(out) CURRENT_STATE_7(out) CURRENT_STATE_8(out)
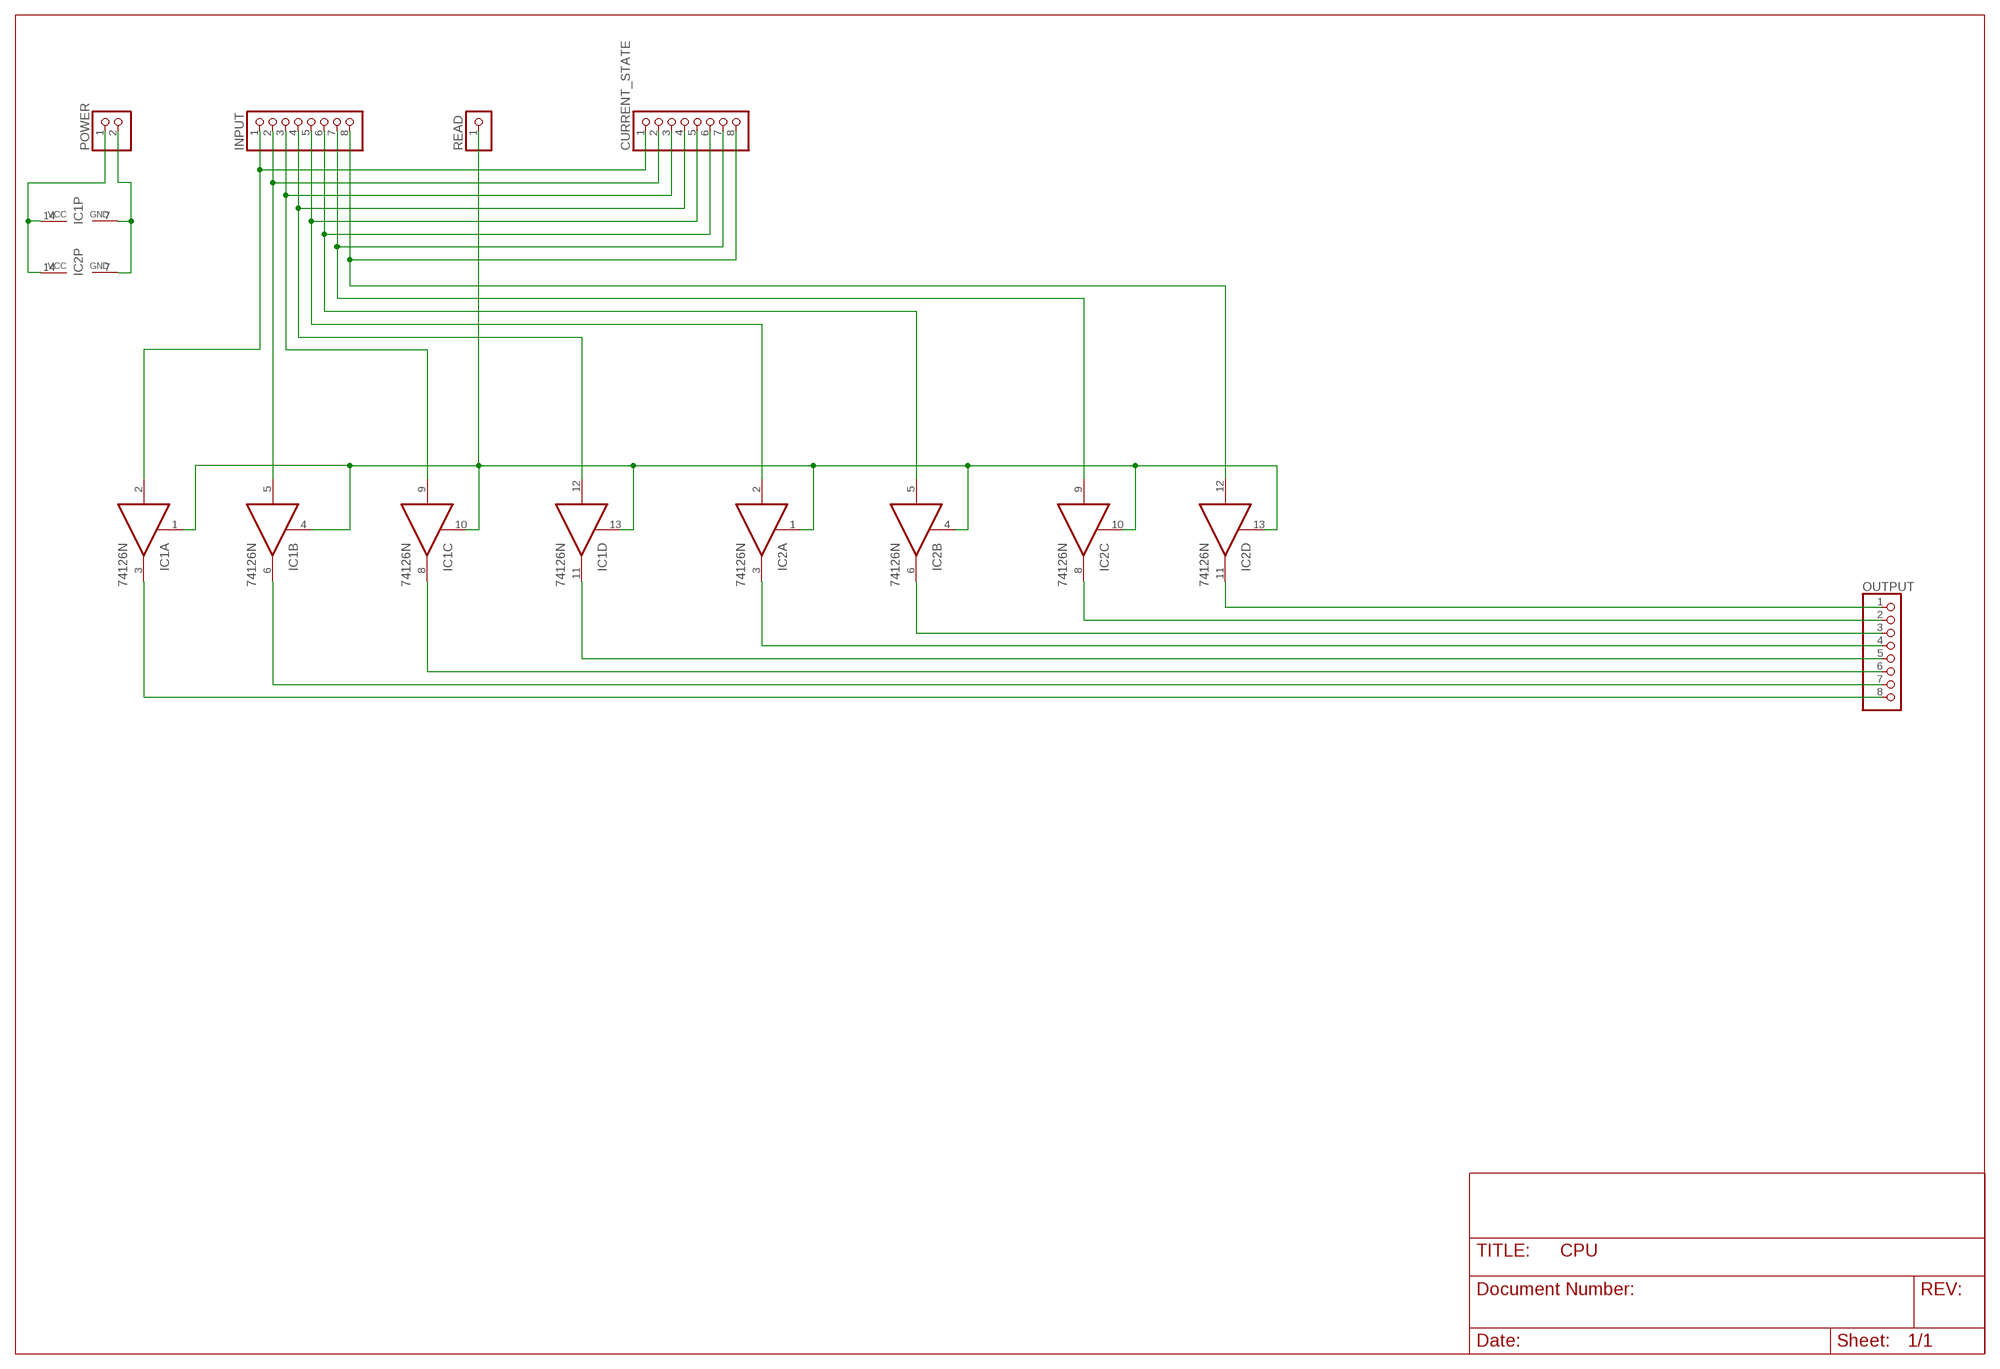
[diagram p92: schematic, module INSTRUCTION_REGISTER_8BIT_PART2, sheet 1]

### Parts
CURRENT_STATE  PINHD-1X8  [1X08]
IC1  74126N  [DIL14]
IC2  74126N  [DIL14]
INPUT  PINHD-1X8  [1X08]
OUTPUT  PINHD-1X8  [1X08]
POWER  PINHD-1X2  [1X02]
READ  PINHD-1X1  [1X01]

### Nets
CURRENT_STATE_1: CURRENT_STATE.1 IC1.2(A:I) INPUT.1
CURRENT_STATE_2: CURRENT_STATE.2 IC1.5(B:I) INPUT.2
CURRENT_STATE_3: CURRENT_STATE.3 IC1.9(C:I) INPUT.3
CURRENT_STATE_4: CURRENT_STATE.4 IC1.12(D:I) INPUT.4
CURRENT_STATE_5: CURRENT_STATE.5 IC2.2(A:I) INPUT.5
CURRENT_STATE_6: CURRENT_STATE.6 IC2.5(B:I) INPUT.6
CURRENT_STATE_7: CURRENT_STATE.7 IC2.9(C:I) INPUT.7
CURRENT_STATE_8: CURRENT_STATE.8 IC2.12(D:I) INPUT.8
GND: IC1.7(P:GND) IC2.7(P:GND) POWER.2
OUTPUT_1: IC2.11(D:O) OUTPUT.1
OUTPUT_2: IC2.8(C:O) OUTPUT.2
OUTPUT_3: IC2.6(B:O) OUTPUT.3
OUTPUT_4: IC2.3(A:O) OUTPUT.4
OUTPUT_5: IC1.11(D:O) OUTPUT.5
OUTPUT_6: IC1.8(C:O) OUTPUT.6
OUTPUT_7: IC1.6(B:O) OUTPUT.7
OUTPUT_8: IC1.3(A:O) OUTPUT.8
READ: IC1.1(A:OE) IC1.4(B:OE) IC1.10(C:OE) IC1.13(D:OE) IC2.1(A:OE) IC2.4(B:OE) IC2.10(C:OE) IC2.13(D:OE) READ.1
VCC: IC1.14(P:VCC) IC2.14(P:VCC) POWER.1

### Library data of the parts
CURRENT_STATE INPUT OUTPUT = pinhead:PINHD-1X8: PIN HEADER
IC1 IC2 = 74xx-eu:74*126: Quad bus BUFFER, 3-state
POWER = pinhead:PINHD-1X2: PIN HEADER
READ = pinhead:PINHD-1X1: PIN HEADER

## Module INSTRUCTION_REGISTER_8BIT_PART3
Ports: INPUT_1(in) INPUT_2(in) INPUT_3(in) INPUT_4(in) INPUT_5(in) INPUT_6(in) INPUT_7(in) INPUT_8(in) OUTPUT_1(out) OUTPUT_2(out) OUTPUT_3(out) OUTPUT_4(out) OUTPUT_5(out) OUTPUT_6(out) OUTPUT_7(out) OUTPUT_8(out) VCC(in) GND(in) READ(in)
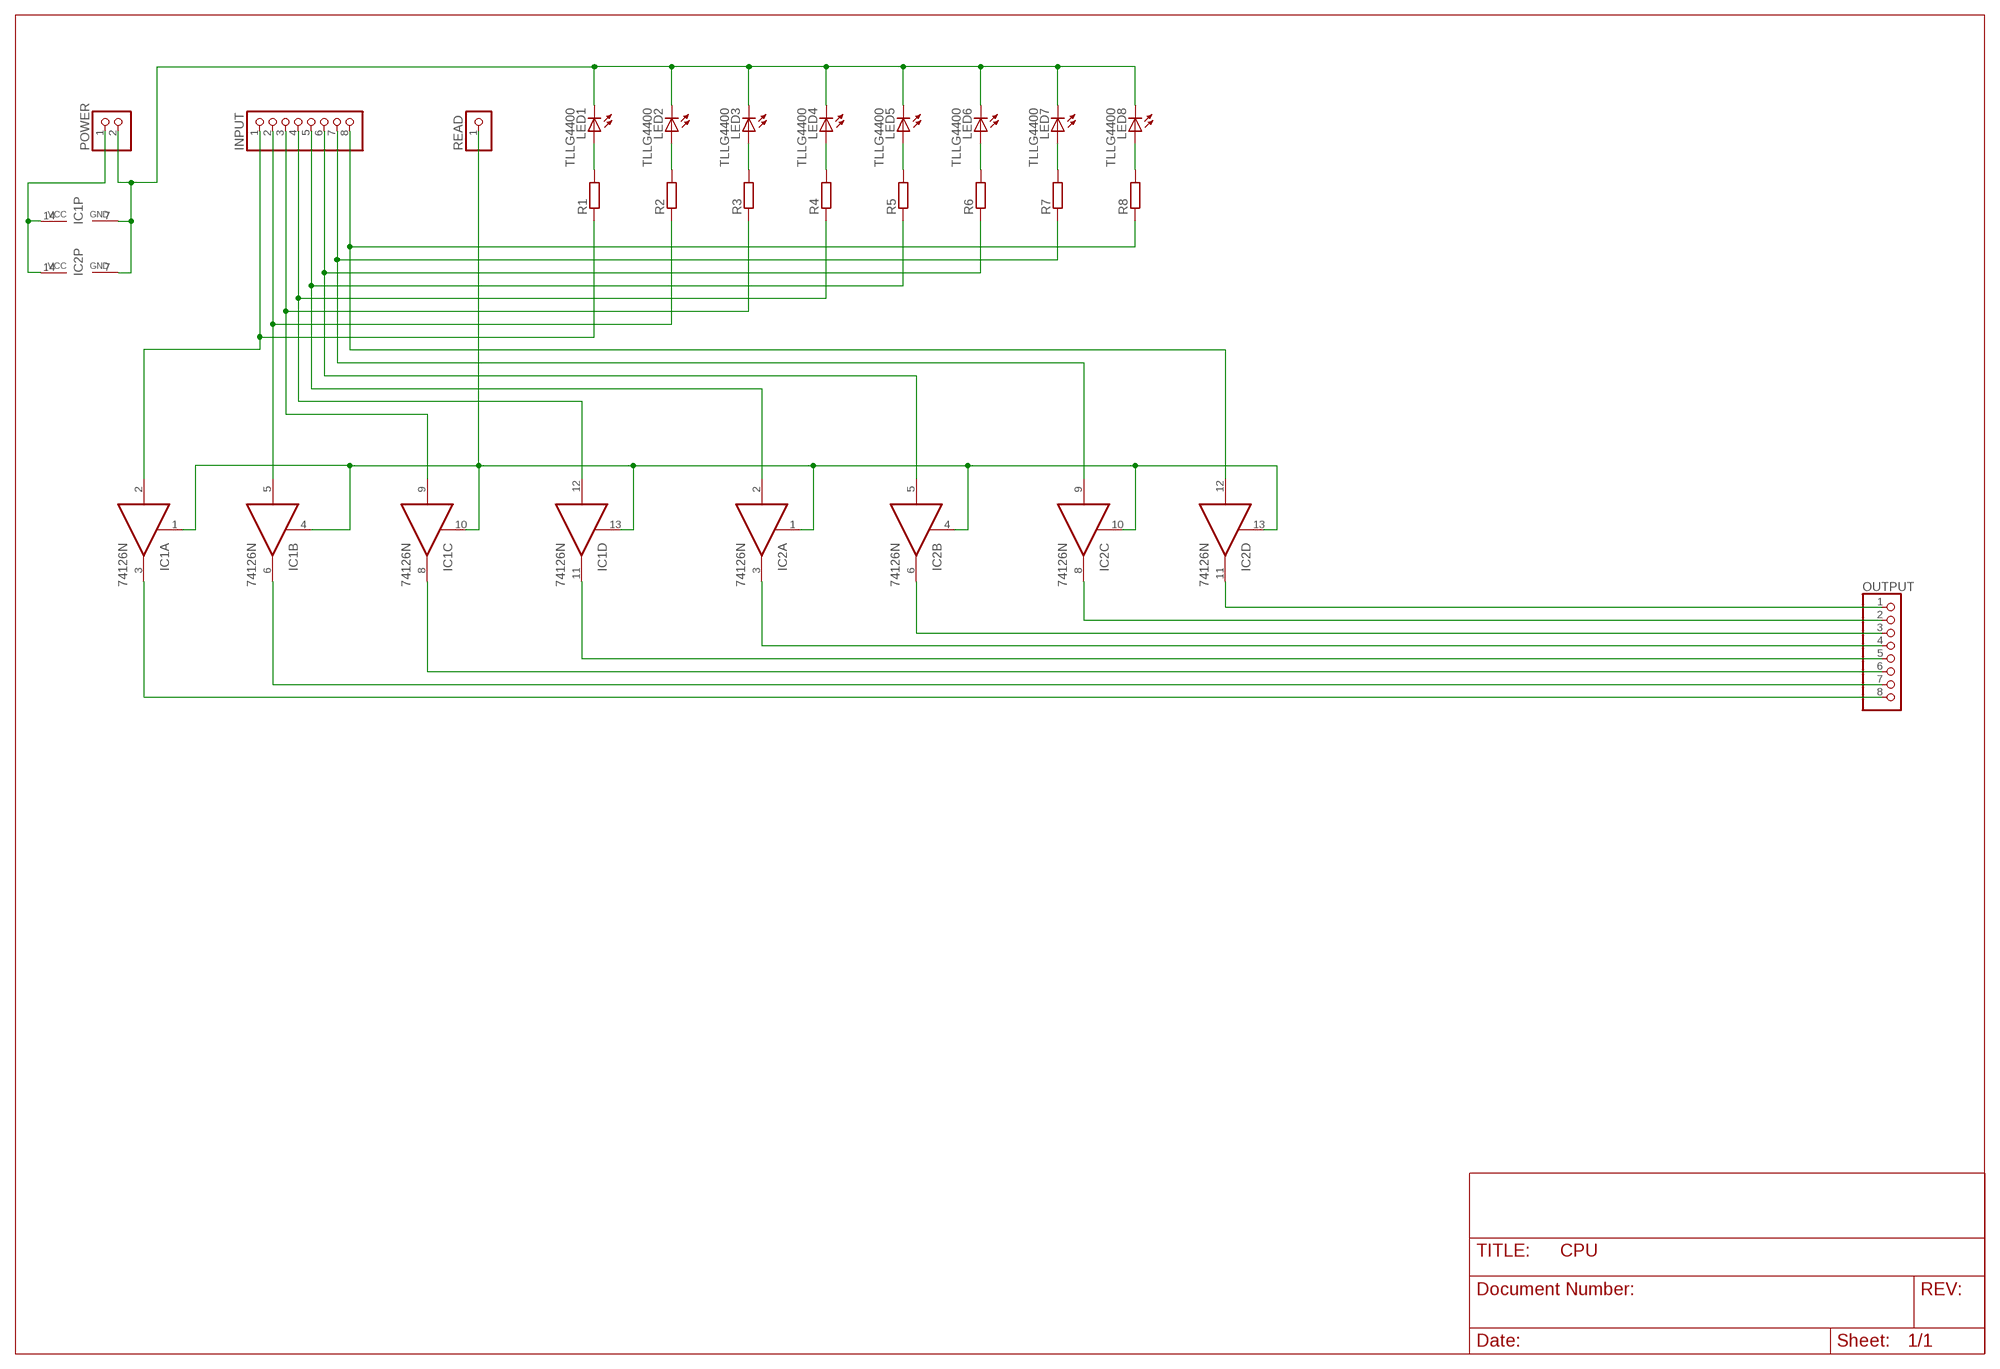
[diagram p93: schematic, module INSTRUCTION_REGISTER_8BIT_PART3, sheet 1]

### Parts
IC1  74126N  [DIL14]
IC2  74126N  [DIL14]
INPUT  PINHD-1X8  [1X08]
LED1  TLLG4400  [LED3MM]
LED2  TLLG4400  [LED3MM]
LED3  TLLG4400  [LED3MM]
LED4  TLLG4400  [LED3MM]
LED5  TLLG4400  [LED3MM]
LED6  TLLG4400  [LED3MM]
LED7  TLLG4400  [LED3MM]
LED8  TLLG4400  [LED3MM]
OUTPUT  PINHD-1X8  [1X08]
POWER  PINHD-1X2  [1X02]
R1  R-EU_0207/7  [0207/7]
R2  R-EU_0207/7  [0207/7]
R3  R-EU_0207/7  [0207/7]
R4  R-EU_0207/7  [0207/7]
R5  R-EU_0207/7  [0207/7]
R6  R-EU_0207/7  [0207/7]
R7  R-EU_0207/7  [0207/7]
R8  R-EU_0207/7  [0207/7]
READ  PINHD-1X1  [1X01]

### Nets
GND: IC1.7(P:GND) IC2.7(P:GND) LED1.K(C) LED2.K(C) LED3.K(C) LED4.K(C) LED5.K(C) LED6.K(C) LED7.K(C) LED8.K(C) POWER.2
INPUT_1: IC1.2(A:I) INPUT.1 R1.1
INPUT_2: IC1.5(B:I) INPUT.2 R2.1
INPUT_3: IC1.9(C:I) INPUT.3 R3.1
INPUT_4: IC1.12(D:I) INPUT.4 R4.1
INPUT_5: IC2.2(A:I) INPUT.5 R5.1
INPUT_6: IC2.5(B:I) INPUT.6 R6.1
INPUT_7: IC2.9(C:I) INPUT.7 R7.1
INPUT_8: IC2.12(D:I) INPUT.8 R8.1
N$9: LED1.A R1.2
N$19: LED2.A R2.2
N$20: LED3.A R3.2
N$21: LED4.A R4.2
N$22: LED5.A R5.2
N$23: LED6.A R6.2
N$24: LED7.A R7.2
N$25: LED8.A R8.2
OUTPUT_1: IC2.11(D:O) OUTPUT.1
OUTPUT_2: IC2.8(C:O) OUTPUT.2
OUTPUT_3: IC2.6(B:O) OUTPUT.3
OUTPUT_4: IC2.3(A:O) OUTPUT.4
OUTPUT_5: IC1.11(D:O) OUTPUT.5
OUTPUT_6: IC1.8(C:O) OUTPUT.6
OUTPUT_7: IC1.6(B:O) OUTPUT.7
OUTPUT_8: IC1.3(A:O) OUTPUT.8
READ: IC1.1(A:OE) IC1.4(B:OE) IC1.10(C:OE) IC1.13(D:OE) IC2.1(A:OE) IC2.4(B:OE) IC2.10(C:OE) IC2.13(D:OE) READ.1
VCC: IC1.14(P:VCC) IC2.14(P:VCC) POWER.1

### Library data of the parts
IC1 IC2 = 74xx-eu:74*126: Quad bus BUFFER, 3-state
INPUT OUTPUT = pinhead:PINHD-1X8: PIN HEADER
LED1-LED8 = led:TLLG4400: Low Current (2mA) LED 3 mm Tinted Diffused Package color GREEN Source: Data sheet <http://www.farnell.com/datasheets/391098.pdf>; MF: VISHAY SEMICONDUCTOR; OC_FARNELL: 1612435
POWER = pinhead:PINHD-1X2: PIN HEADER
R1-R8 = resistor:R-EU_: RESISTOR, European symbol
READ = pinhead:PINHD-1X1: PIN HEADER

## Module PC_INCREMENTER
Ports: INPUT_1(in) INPUT_2(in) INPUT_3(in) INPUT_4(in) INPUT_5(in) INPUT_6(in) INPUT_7(in) INPUT_8(in) INPUT_9(in) INPUT_10(in) INPUT_11(in) INPUT_12(in) INPUT_13(in) INPUT_14(in) INPUT_15(in) INPUT_16(in) OUTPUT_1(out) OUTPUT_2(out) OUTPUT_3(out) OUTPUT_4(out) OUTPUT_5(out) OUTPUT_6(out) OUTPUT_7(out) OUTPUT_8(out) OUTPUT_9(out) OUTPUT_10(out) OUTPUT_11(out) OUTPUT_12(out) OUTPUT_13(out) OUTPUT_14(out) OUTPUT_15(out) OUTPUT_16(out) VCC(in) GND(in) ENABLE(in)
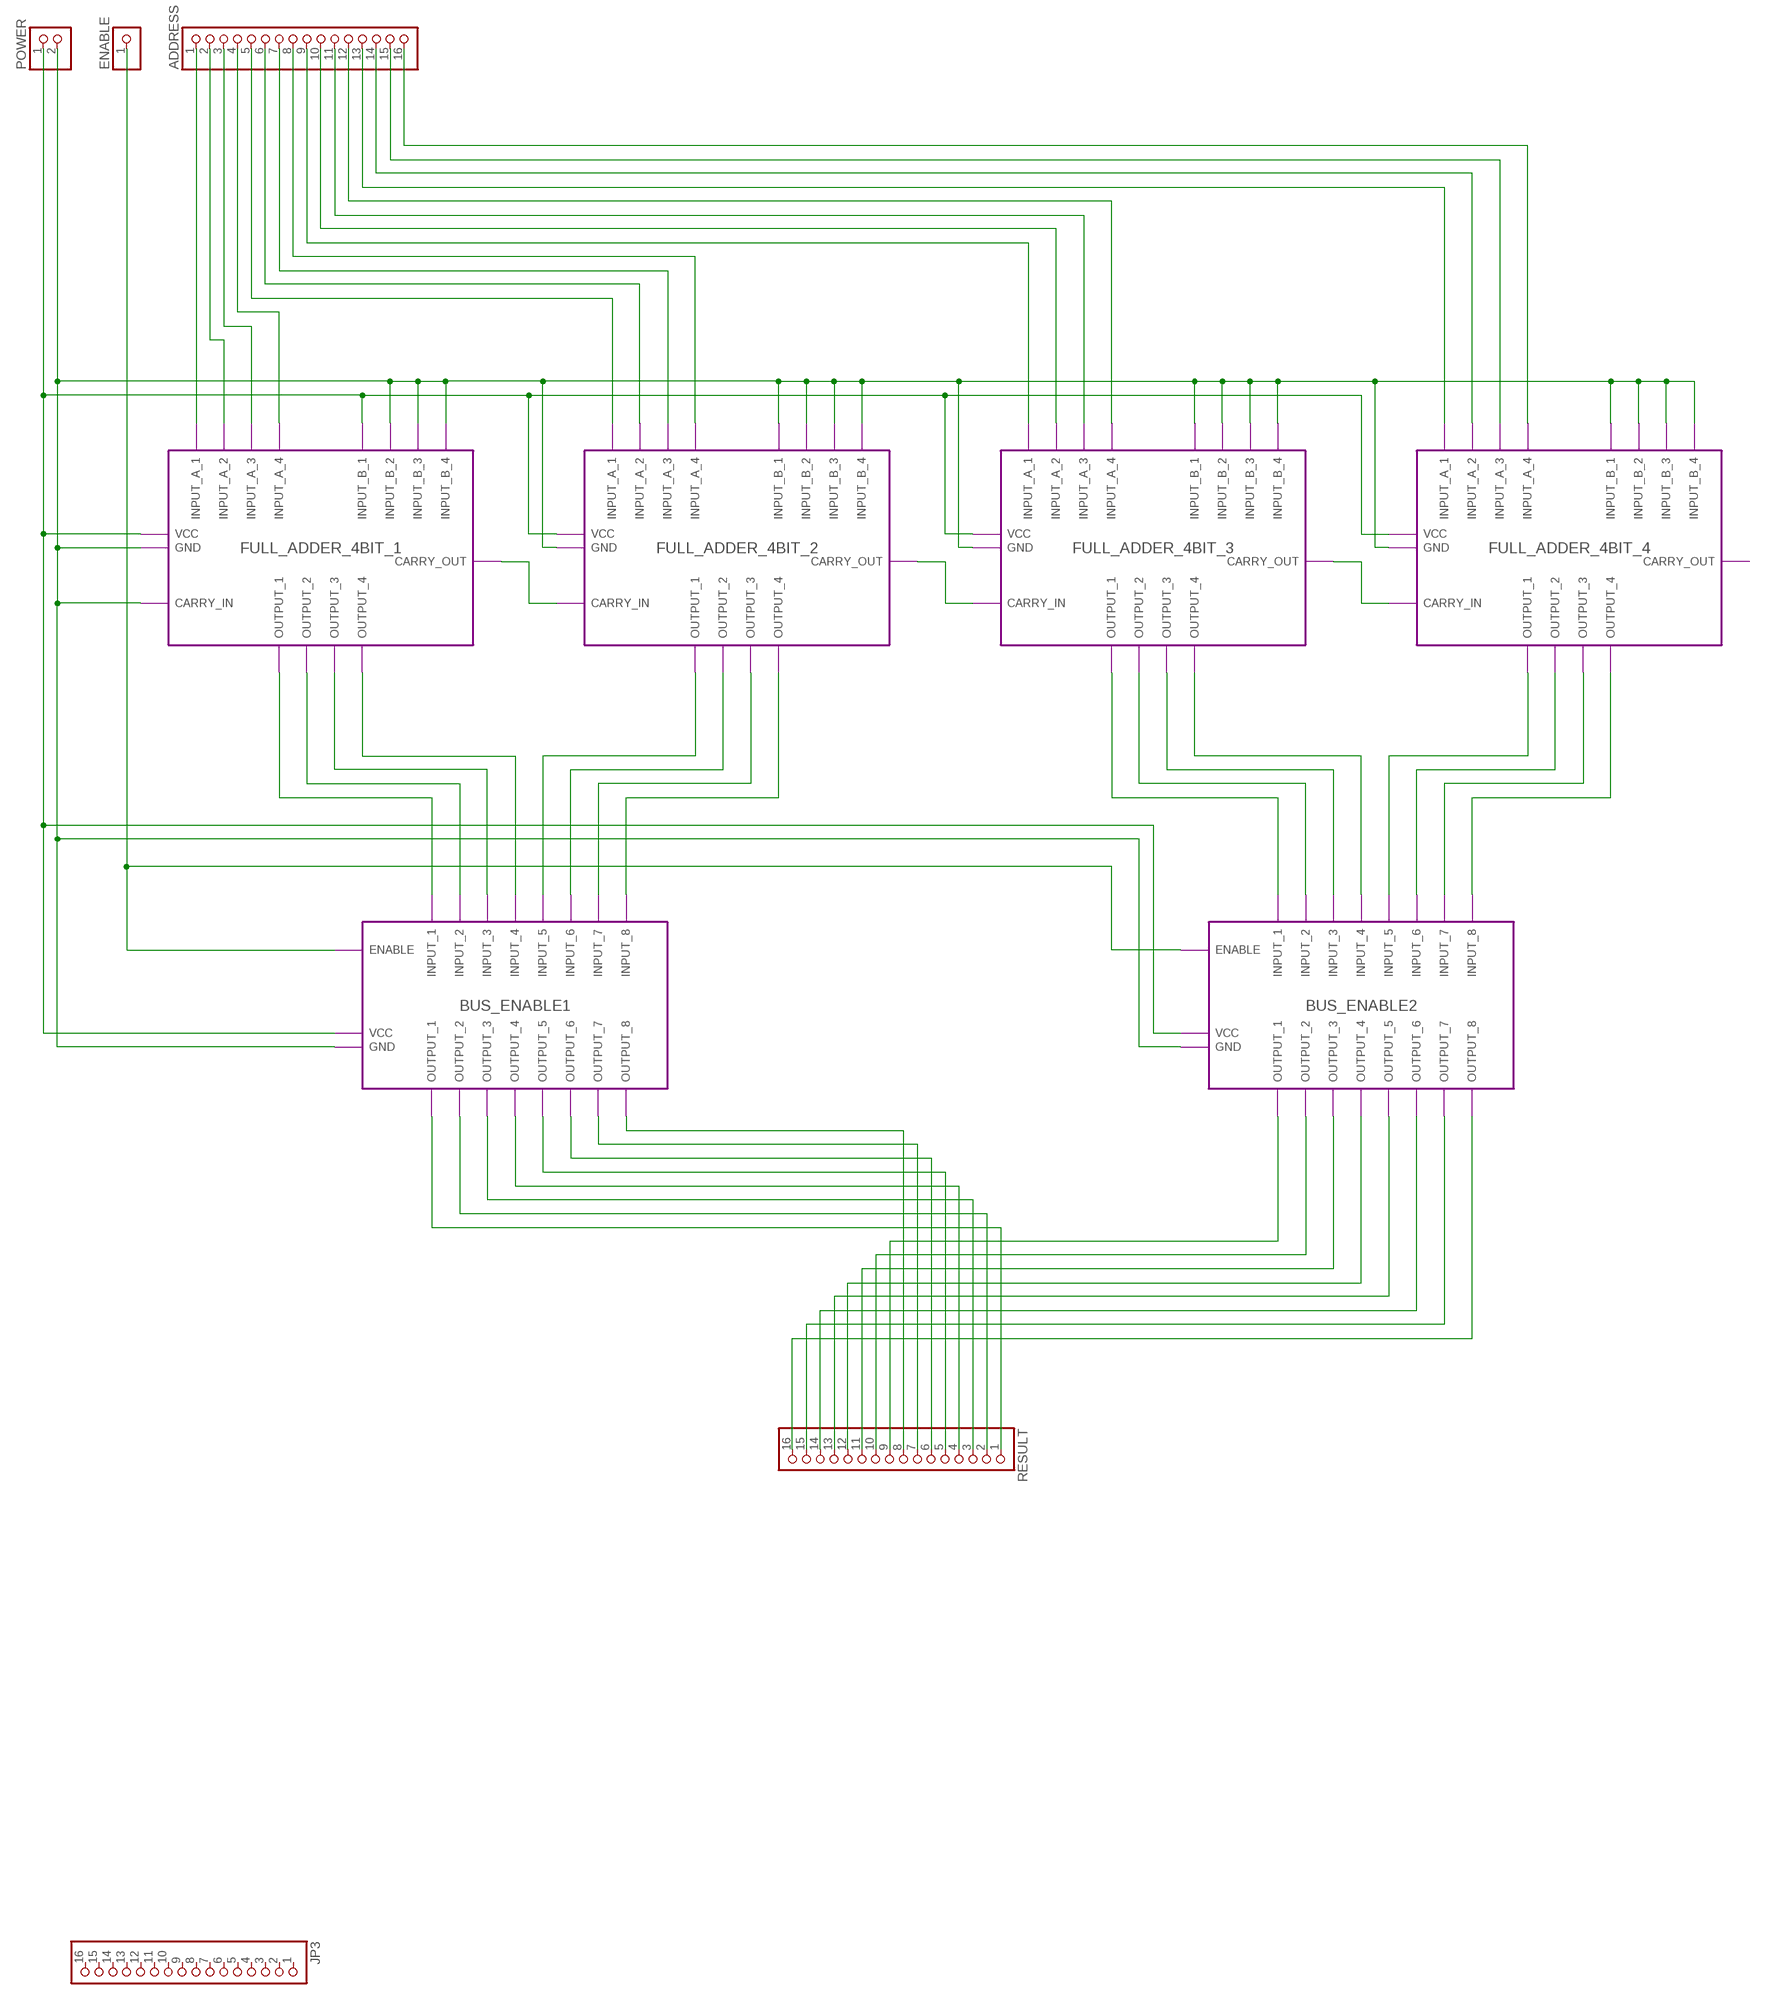
[diagram p94: schematic, module PC_INCREMENTER, sheet 1]

### Parts
ADDRESS  PINHD-1X16  [1X16]
ENABLE  PINHD-1X1  [1X01]
JP3  PINHD-1X16  [1X16]
POWER  PINHD-1X2  [1X02]
RESULT  PINHD-1X16  [1X16]

### Module instances
FULL_ADDER_4BIT_1 = FULL_ADDER_4BIT
FULL_ADDER_4BIT_2 = FULL_ADDER_4BIT
FULL_ADDER_4BIT_3 = FULL_ADDER_4BIT
FULL_ADDER_4BIT_4 = FULL_ADDER_4BIT
BUS_ENABLE1 = BUS_ENABLE
BUS_ENABLE2 = BUS_ENABLE

### Nets
ENABLE: ENABLE.1 ; port BUS_ENABLE1.ENABLE BUS_ENABLE2.ENABLE
GND: POWER.2 ; port FULL_ADDER_4BIT_3.GND FULL_ADDER_4BIT_1.GND FULL_ADDER_4BIT_1.INPUT_B_2 FULL_ADDER_4BIT_1.INPUT_B_3 FULL_ADDER_4BIT_1.INPUT_B_4 FULL_ADDER_4BIT_1.CARRY_IN FULL_ADDER_4BIT_2.INPUT_B_1 FULL_ADDER_4BIT_2.INPUT_B_2 FULL_ADDER_4BIT_2.INPUT_B_3 FULL_ADDER_4BIT_2.INPUT_B_4 FULL_ADDER_4BIT_4.INPUT_B_4 FULL_ADDER_4BIT_4.INPUT_B_3 FULL_ADDER_4BIT_4.INPUT_B_2 FULL_ADDER_4BIT_4.INPUT_B_1 FULL_ADDER_4BIT_3.INPUT_B_4 FULL_ADDER_4BIT_3.INPUT_B_3 FULL_ADDER_4BIT_3.INPUT_B_2 FULL_ADDER_4BIT_3.INPUT_B_1 FULL_ADDER_4BIT_4.GND FULL_ADDER_4BIT_2.GND BUS_ENABLE1.GND BUS_ENABLE2.GND
INPUT_1: ADDRESS.1 ; port FULL_ADDER_4BIT_1.INPUT_A_1
INPUT_2: ADDRESS.2 ; port FULL_ADDER_4BIT_1.INPUT_A_2
INPUT_3: ADDRESS.3 ; port FULL_ADDER_4BIT_1.INPUT_A_3
INPUT_4: ADDRESS.4 ; port FULL_ADDER_4BIT_1.INPUT_A_4
INPUT_5: ADDRESS.5 ; port FULL_ADDER_4BIT_2.INPUT_A_1
INPUT_6: ADDRESS.6 ; port FULL_ADDER_4BIT_2.INPUT_A_2
INPUT_7: ADDRESS.7 ; port FULL_ADDER_4BIT_2.INPUT_A_3
INPUT_8: ADDRESS.8 ; port FULL_ADDER_4BIT_2.INPUT_A_4
INPUT_9: ADDRESS.9 ; port FULL_ADDER_4BIT_3.INPUT_A_1
INPUT_10: ADDRESS.10 ; port FULL_ADDER_4BIT_3.INPUT_A_2
INPUT_11: ADDRESS.11 ; port FULL_ADDER_4BIT_3.INPUT_A_3
INPUT_12: ADDRESS.12 ; port FULL_ADDER_4BIT_3.INPUT_A_4
INPUT_13: ADDRESS.13 ; port FULL_ADDER_4BIT_4.INPUT_A_1
INPUT_14: ADDRESS.14 ; port FULL_ADDER_4BIT_4.INPUT_A_2
INPUT_15: ADDRESS.15 ; port FULL_ADDER_4BIT_4.INPUT_A_3
INPUT_16: ADDRESS.16 ; port FULL_ADDER_4BIT_4.INPUT_A_4
N$1: port FULL_ADDER_4BIT_1.OUTPUT_1 BUS_ENABLE1.INPUT_1
N$2: port FULL_ADDER_4BIT_1.OUTPUT_2 BUS_ENABLE1.INPUT_2
N$3: port BUS_ENABLE1.INPUT_3 FULL_ADDER_4BIT_1.OUTPUT_3
N$4: port FULL_ADDER_4BIT_1.OUTPUT_4 BUS_ENABLE1.INPUT_4
N$5: port FULL_ADDER_4BIT_1.CARRY_OUT FULL_ADDER_4BIT_2.CARRY_IN
N$6: port FULL_ADDER_4BIT_2.OUTPUT_1 BUS_ENABLE1.INPUT_5
N$7: port BUS_ENABLE1.INPUT_6 FULL_ADDER_4BIT_2.OUTPUT_2
N$8: port FULL_ADDER_4BIT_2.OUTPUT_3 BUS_ENABLE1.INPUT_7
N$9: port BUS_ENABLE1.INPUT_8 FULL_ADDER_4BIT_2.OUTPUT_4
N$10: port FULL_ADDER_4BIT_3.OUTPUT_1 BUS_ENABLE2.INPUT_1
N$11: port BUS_ENABLE2.INPUT_2 FULL_ADDER_4BIT_3.OUTPUT_2
N$12: port FULL_ADDER_4BIT_3.OUTPUT_3 BUS_ENABLE2.INPUT_3
N$13: port FULL_ADDER_4BIT_2.CARRY_OUT FULL_ADDER_4BIT_3.CARRY_IN
N$14: port FULL_ADDER_4BIT_3.CARRY_OUT FULL_ADDER_4BIT_4.CARRY_IN
N$15: port BUS_ENABLE2.INPUT_4 FULL_ADDER_4BIT_3.OUTPUT_4
N$16: port FULL_ADDER_4BIT_4.OUTPUT_1 BUS_ENABLE2.INPUT_5
N$17: port BUS_ENABLE2.INPUT_6 FULL_ADDER_4BIT_4.OUTPUT_2
N$18: port FULL_ADDER_4BIT_4.OUTPUT_3 BUS_ENABLE2.INPUT_7
N$19: port BUS_ENABLE2.INPUT_8 FULL_ADDER_4BIT_4.OUTPUT_4
OUTPUT_1: RESULT.1 ; port BUS_ENABLE1.OUTPUT_1
OUTPUT_2: RESULT.2 ; port BUS_ENABLE1.OUTPUT_2
OUTPUT_3: RESULT.3 ; port BUS_ENABLE1.OUTPUT_3
OUTPUT_4: RESULT.4 ; port BUS_ENABLE1.OUTPUT_4
OUTPUT_5: RESULT.5 ; port BUS_ENABLE1.OUTPUT_5
OUTPUT_6: RESULT.6 ; port BUS_ENABLE1.OUTPUT_6
OUTPUT_7: RESULT.7 ; port BUS_ENABLE1.OUTPUT_7
OUTPUT_8: RESULT.8 ; port BUS_ENABLE1.OUTPUT_8
OUTPUT_9: RESULT.9 ; port BUS_ENABLE2.OUTPUT_1
OUTPUT_10: RESULT.10 ; port BUS_ENABLE2.OUTPUT_2
OUTPUT_11: RESULT.11 ; port BUS_ENABLE2.OUTPUT_3
OUTPUT_12: RESULT.12 ; port BUS_ENABLE2.OUTPUT_4
OUTPUT_13: RESULT.13 ; port BUS_ENABLE2.OUTPUT_5
OUTPUT_14: RESULT.14 ; port BUS_ENABLE2.OUTPUT_6
OUTPUT_15: RESULT.15 ; port BUS_ENABLE2.OUTPUT_7
OUTPUT_16: RESULT.16 ; port BUS_ENABLE2.OUTPUT_8
VCC: POWER.1 ; port FULL_ADDER_4BIT_1.VCC FULL_ADDER_4BIT_1.INPUT_B_1 FULL_ADDER_4BIT_4.VCC FULL_ADDER_4BIT_3.VCC FULL_ADDER_4BIT_2.VCC BUS_ENABLE1.VCC BUS_ENABLE2.VCC
Unconnected: JP3.1 JP3.2 JP3.3 JP3.4 JP3.5 JP3.6 JP3.7 JP3.8 JP3.9 JP3.10 JP3.11 JP3.12 JP3.13 JP3.14 JP3.15 JP3.16

### Library data of the parts
ADDRESS JP3 RESULT = pinhead:PINHD-1X16: PIN HEADER
ENABLE = pinhead:PINHD-1X1: PIN HEADER
POWER = pinhead:PINHD-1X2: PIN HEADER

## Module INSTRUCTION_REGISTER
Ports: INPUT_1(in) INPUT_2(in) INPUT_3(in) INPUT_4(in) INPUT_5(in) INPUT_6(in) INPUT_7(in) INPUT_8(in) CURRENT_INSTRUCTION_1(out) CURRENT_INSTRUCTION_2(out) CURRENT_INSTRUCTION_3(out) CURRENT_INSTRUCTION_4(out) CURRENT_INSTRUCTION_5(out) CURRENT_INSTRUCTION_6(out) CURRENT_INSTRUCTION_7(out) CURRENT_INSTRUCTION_8(out) ALU_FUNCTIONCODE_1(out) ALU_FUNCTIONCODE_2(out) ALU_FUNCTIONCODE_3(out) ALU_FUNCTIONCODE_4(out) WRITE(in) SELECT_TO_DATABUS(in) SELECT_TO_ALU(in) OUTPUT_1(out) OUTPUT_2(out) OUTPUT_3(out) OUTPUT_4(out) OUTPUT_5(out) OUTPUT_6(out) OUTPUT_7(out) OUTPUT_8(out) VCC(in) GND(in)
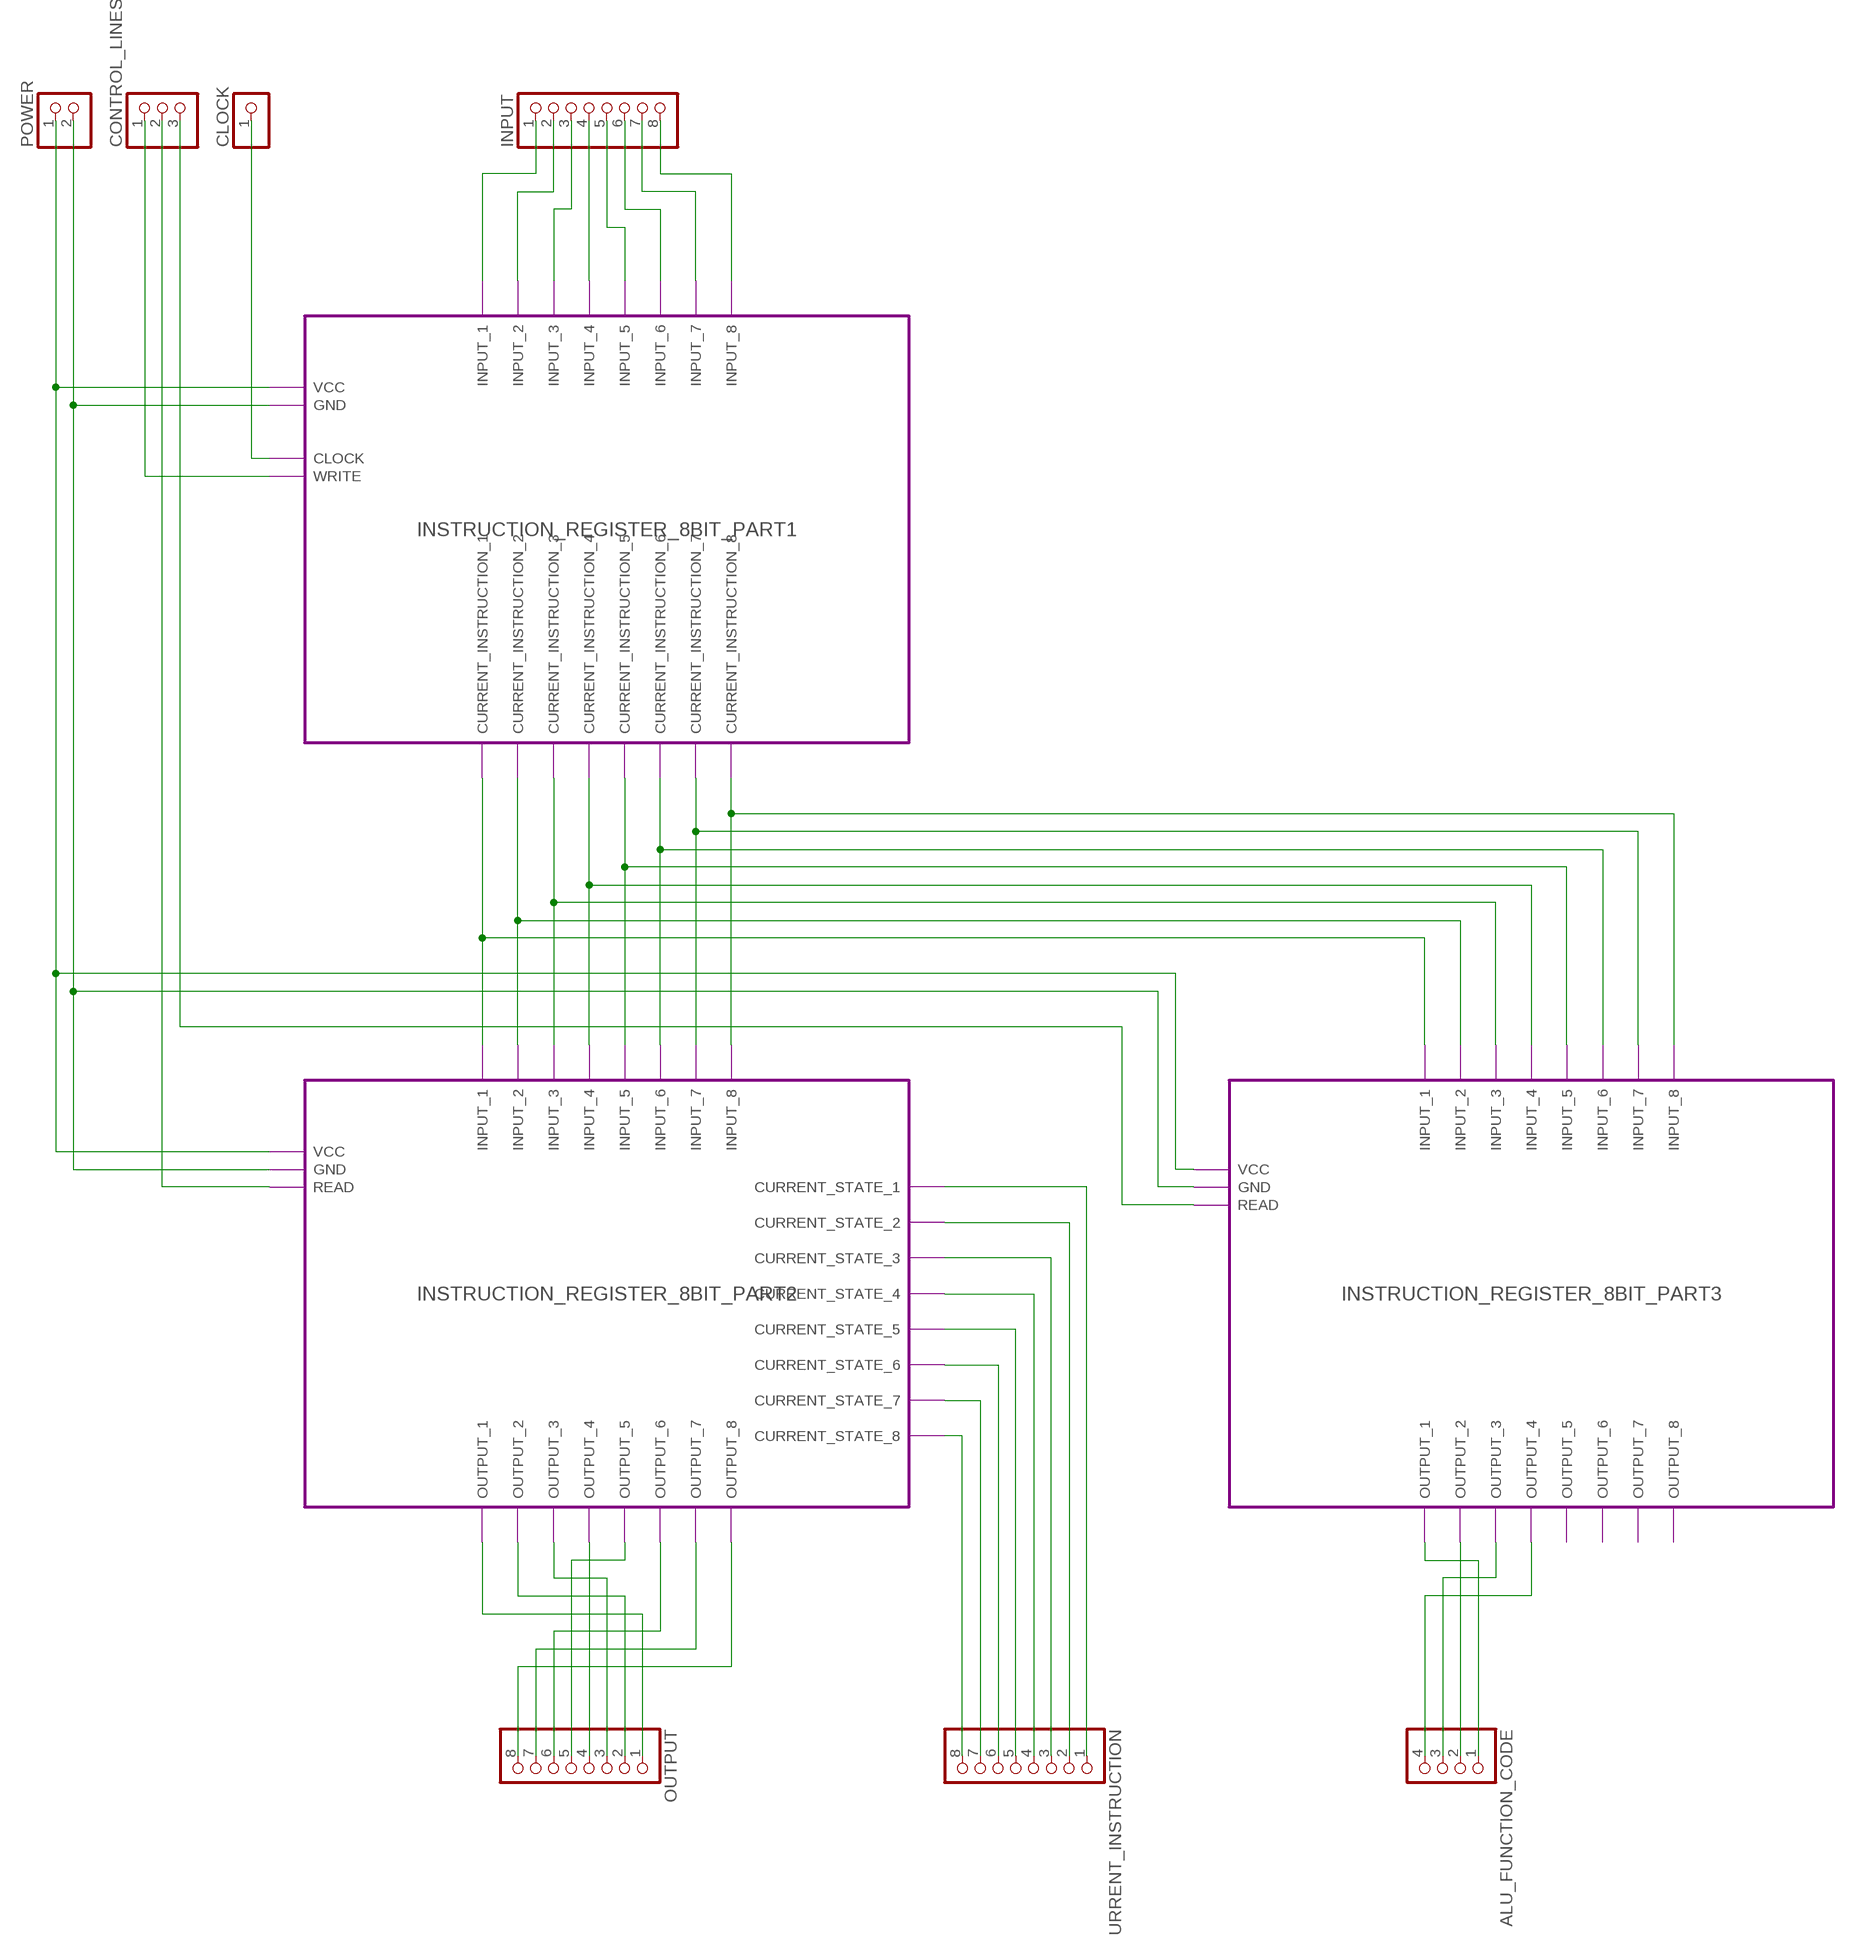
[diagram p95: schematic, module INSTRUCTION_REGISTER, sheet 1]

### Parts
ALU_FUNCTION_CODE  PINHD-1X4  [1X04]
CLOCK  PINHD-1X1  [1X01]
CONTROL_LINES  PINHD-1X3  [1X03]
CURRENT_INSTRUCTION  PINHD-1X8  [1X08]
INPUT  PINHD-1X8  [1X08]
OUTPUT  PINHD-1X8  [1X08]
POWER  PINHD-1X2  [1X02]

### Module instances
INSTRUCTION_REGISTER_8BIT_PART1 = INSTRUCTION_REGISTER_8BIT
INSTRUCTION_REGISTER_8BIT_PART2 = INSTRUCTION_REGISTER_8BIT_PART2
INSTRUCTION_REGISTER_8BIT_PART3 = INSTRUCTION_REGISTER_8BIT_PART3

### Nets
ALU_FUNCTIONCODE_1: ALU_FUNCTION_CODE.1 ; port INSTRUCTION_REGISTER_8BIT_PART3.OUTPUT_1
ALU_FUNCTIONCODE_2: ALU_FUNCTION_CODE.2 ; port INSTRUCTION_REGISTER_8BIT_PART3.OUTPUT_2
ALU_FUNCTIONCODE_3: ALU_FUNCTION_CODE.3 ; port INSTRUCTION_REGISTER_8BIT_PART3.OUTPUT_3
ALU_FUNCTIONCODE_4: ALU_FUNCTION_CODE.4 ; port INSTRUCTION_REGISTER_8BIT_PART3.OUTPUT_4
CURRENT_INSTRUCTION_1: CURRENT_INSTRUCTION.1 ; port INSTRUCTION_REGISTER_8BIT_PART2.CURRENT_STATE_1
CURRENT_INSTRUCTION_2: CURRENT_INSTRUCTION.2 ; port INSTRUCTION_REGISTER_8BIT_PART2.CURRENT_STATE_2
CURRENT_INSTRUCTION_3: CURRENT_INSTRUCTION.3 ; port INSTRUCTION_REGISTER_8BIT_PART2.CURRENT_STATE_3
CURRENT_INSTRUCTION_4: CURRENT_INSTRUCTION.4 ; port INSTRUCTION_REGISTER_8BIT_PART2.CURRENT_STATE_4
CURRENT_INSTRUCTION_5: CURRENT_INSTRUCTION.5 ; port INSTRUCTION_REGISTER_8BIT_PART2.CURRENT_STATE_5
CURRENT_INSTRUCTION_6: CURRENT_INSTRUCTION.6 ; port INSTRUCTION_REGISTER_8BIT_PART2.CURRENT_STATE_6
CURRENT_INSTRUCTION_7: CURRENT_INSTRUCTION.7 ; port INSTRUCTION_REGISTER_8BIT_PART2.CURRENT_STATE_7
CURRENT_INSTRUCTION_8: CURRENT_INSTRUCTION.8 ; port INSTRUCTION_REGISTER_8BIT_PART2.CURRENT_STATE_8
GND: POWER.2 ; port INSTRUCTION_REGISTER_8BIT_PART1.GND INSTRUCTION_REGISTER_8BIT_PART2.GND INSTRUCTION_REGISTER_8BIT_PART3.GND
INPUT_1: INPUT.1 ; port INSTRUCTION_REGISTER_8BIT_PART1.INPUT_1
INPUT_2: INPUT.2 ; port INSTRUCTION_REGISTER_8BIT_PART1.INPUT_2
INPUT_3: INPUT.3 ; port INSTRUCTION_REGISTER_8BIT_PART1.INPUT_3
INPUT_4: INPUT.4 ; port INSTRUCTION_REGISTER_8BIT_PART1.INPUT_4
INPUT_5: INPUT.5 ; port INSTRUCTION_REGISTER_8BIT_PART1.INPUT_5
INPUT_6: INPUT.6 ; port INSTRUCTION_REGISTER_8BIT_PART1.INPUT_6
INPUT_7: INPUT.7 ; port INSTRUCTION_REGISTER_8BIT_PART1.INPUT_7
INPUT_8: INPUT.8 ; port INSTRUCTION_REGISTER_8BIT_PART1.INPUT_8
N$1: port INSTRUCTION_REGISTER_8BIT_PART1.CURRENT_INSTRUCTION_1 INSTRUCTION_REGISTER_8BIT_PART2.INPUT_1 INSTRUCTION_REGISTER_8BIT_PART3.INPUT_1
N$2: port INSTRUCTION_REGISTER_8BIT_PART2.INPUT_2 INSTRUCTION_REGISTER_8BIT_PART1.CURRENT_INSTRUCTION_2 INSTRUCTION_REGISTER_8BIT_PART3.INPUT_2
N$3: port INSTRUCTION_REGISTER_8BIT_PART1.CURRENT_INSTRUCTION_3 INSTRUCTION_REGISTER_8BIT_PART2.INPUT_3 INSTRUCTION_REGISTER_8BIT_PART3.INPUT_3
N$4: port INSTRUCTION_REGISTER_8BIT_PART2.INPUT_4 INSTRUCTION_REGISTER_8BIT_PART1.CURRENT_INSTRUCTION_4 INSTRUCTION_REGISTER_8BIT_PART3.INPUT_4
N$5: port INSTRUCTION_REGISTER_8BIT_PART1.CURRENT_INSTRUCTION_5 INSTRUCTION_REGISTER_8BIT_PART2.INPUT_5 INSTRUCTION_REGISTER_8BIT_PART3.INPUT_5
N$6: port INSTRUCTION_REGISTER_8BIT_PART2.INPUT_6 INSTRUCTION_REGISTER_8BIT_PART1.CURRENT_INSTRUCTION_6 INSTRUCTION_REGISTER_8BIT_PART3.INPUT_6
N$7: port INSTRUCTION_REGISTER_8BIT_PART1.CURRENT_INSTRUCTION_7 INSTRUCTION_REGISTER_8BIT_PART2.INPUT_7 INSTRUCTION_REGISTER_8BIT_PART3.INPUT_7
N$8: port INSTRUCTION_REGISTER_8BIT_PART2.INPUT_8 INSTRUCTION_REGISTER_8BIT_PART1.CURRENT_INSTRUCTION_8 INSTRUCTION_REGISTER_8BIT_PART3.INPUT_8
N$11: CLOCK.1 ; port INSTRUCTION_REGISTER_8BIT_PART1.CLOCK
OUTPUT_1: OUTPUT.1 ; port INSTRUCTION_REGISTER_8BIT_PART2.OUTPUT_1
OUTPUT_2: OUTPUT.2 ; port INSTRUCTION_REGISTER_8BIT_PART2.OUTPUT_2
OUTPUT_3: OUTPUT.3 ; port INSTRUCTION_REGISTER_8BIT_PART2.OUTPUT_3
OUTPUT_4: OUTPUT.4 ; port INSTRUCTION_REGISTER_8BIT_PART2.OUTPUT_4
OUTPUT_5: OUTPUT.5 ; port INSTRUCTION_REGISTER_8BIT_PART2.OUTPUT_5
OUTPUT_6: OUTPUT.6 ; port INSTRUCTION_REGISTER_8BIT_PART2.OUTPUT_6
OUTPUT_7: OUTPUT.7 ; port INSTRUCTION_REGISTER_8BIT_PART2.OUTPUT_7
OUTPUT_8: OUTPUT.8 ; port INSTRUCTION_REGISTER_8BIT_PART2.OUTPUT_8
SELECT_TO_ALU: CONTROL_LINES.3 ; port INSTRUCTION_REGISTER_8BIT_PART3.READ
SELECT_TO_DATABUS: CONTROL_LINES.2 ; port INSTRUCTION_REGISTER_8BIT_PART2.READ
VCC: POWER.1 ; port INSTRUCTION_REGISTER_8BIT_PART1.VCC INSTRUCTION_REGISTER_8BIT_PART2.VCC INSTRUCTION_REGISTER_8BIT_PART3.VCC
WRITE: CONTROL_LINES.1 ; port INSTRUCTION_REGISTER_8BIT_PART1.WRITE

### Library data of the parts
ALU_FUNCTION_CODE = pinhead:PINHD-1X4: PIN HEADER
CLOCK = pinhead:PINHD-1X1: PIN HEADER
CONTROL_LINES = pinhead:PINHD-1X3: PIN HEADER
CURRENT_INSTRUCTION INPUT OUTPUT = pinhead:PINHD-1X8: PIN HEADER
POWER = pinhead:PINHD-1X2: PIN HEADER